# EAGLE schematic oresat-backplane (EAGLE 9.5.1)

## Sheet 1 of 20: Slot 1
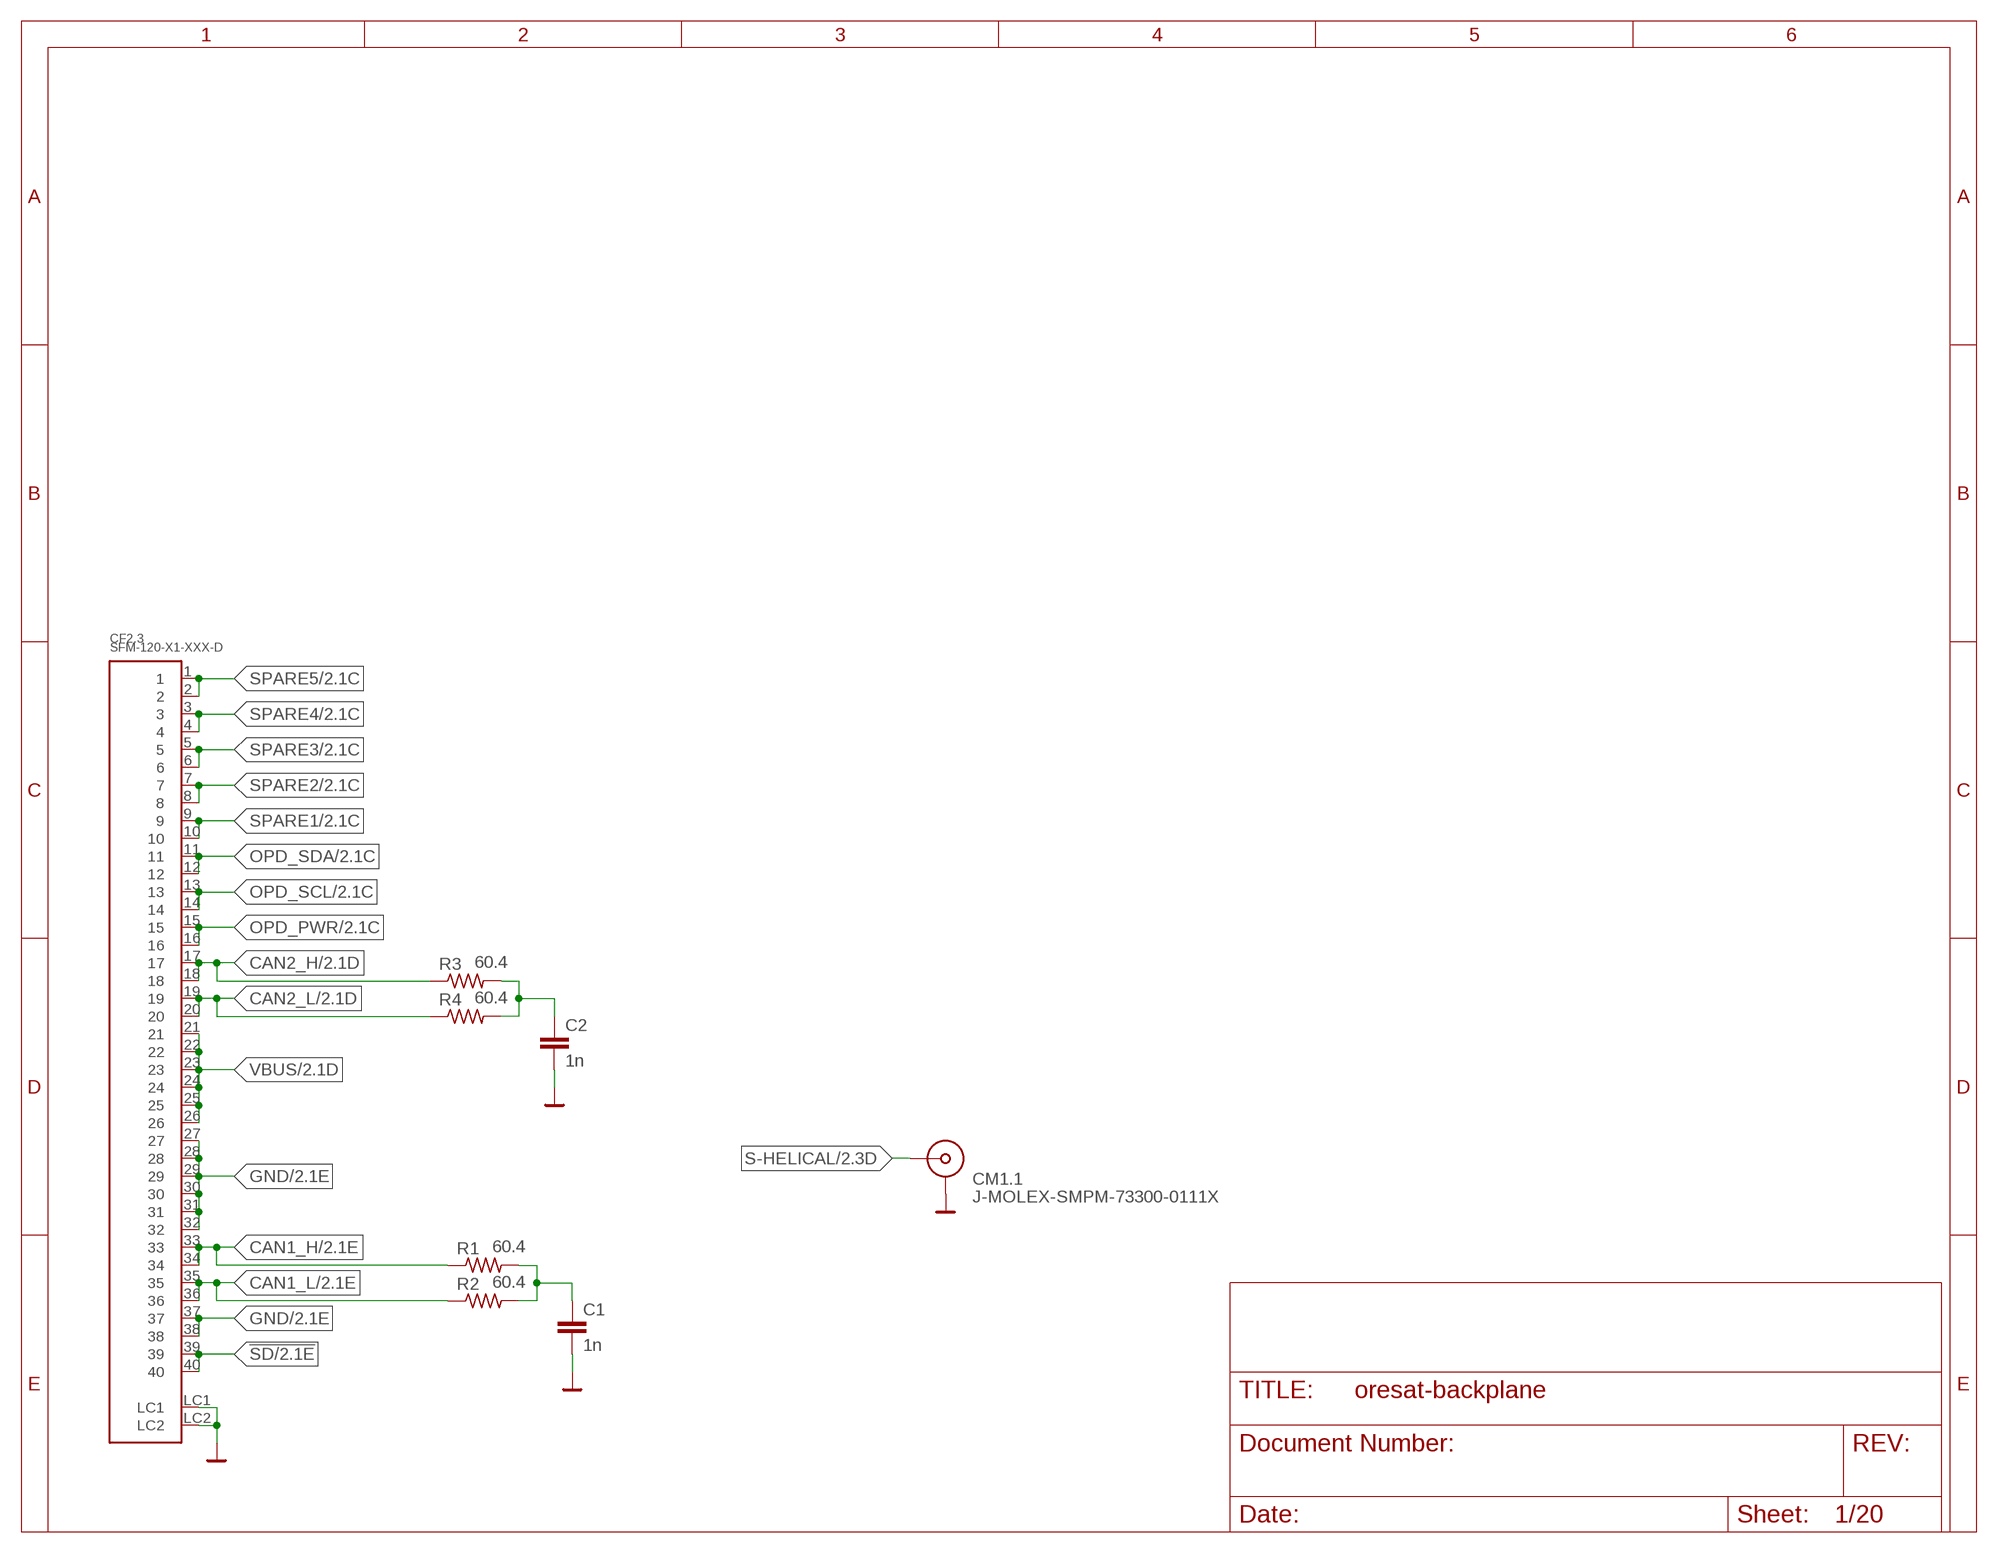
[diagram p0: schematic, sheet 1]

### Parts
C1  1n  C-EU0603-C-NOSILK  [.0603-C-NOSILK]
C2  1n  C-EU0603-C-NOSILK  [.0603-C-NOSILK]
CF2.3  SFM-120-X1-XXX-D  [SFM-120-X1-XXX-D]
CM1.1  J-MOLEX-SMPM-73300-0111X  [J-MOLEX-SMPM-73300-0111X]
R1  60.4  R-US_1206-C  [1206-C]
R2  60.4  R-US_1206-C  [1206-C]
R3  60.4  R-US_1206-C  [1206-C]
R4  60.4  R-US_1206-C  [1206-C]

### Nets
!SD: CF2.3.39 CF2.3.40 ; also sheet 2,3,4,5,6,7,8,12,13,14,15,16,17,18,19,20
CAN1_H: CF2.3.33 CF2.3.34 R1.1 ; also sheet 2,3,4,5,6,7,8,12,13,14,15,16,17,18,19,20
CAN1_L: CF2.3.35 CF2.3.36 R2.1 ; also sheet 2,3,4,5,6,7,8,12,13,14,15,16,17,18,19,20
CAN2_H: CF2.3.17 CF2.3.18 R3.1 ; also sheet 2,3,4,5,6,7,8,12,13,14,15,16,17,18,19,20
CAN2_L: CF2.3.19 CF2.3.20 R4.1 ; also sheet 2,3,4,5,6,7,8,12,13,14,15,16,17,18,19,20
GND: C1.2 C2.2 CF2.3.27 CF2.3.28 CF2.3.29 CF2.3.30 CF2.3.31 CF2.3.32 CF2.3.37 CF2.3.38 CF2.3.LC1 CF2.3.LC2 CM1.1.P$1(SHIELD1) CM1.1.P$2(SHIELD1) CM1.1.P$3(SHIELD1) CM1.1.P$4(SHIELD1) ; also sheet 2,3,4,5,6,7,8,12,13,14,15,16,17,18,19,20
N$1: C2.1 R3.2 R4.2
N$2: C1.1 R1.2 R2.2
OPD_PWR: CF2.3.15 CF2.3.16 ; also sheet 2,3,4,5,6,7,8,12,13,14,15,16,17,18,19,20
OPD_SCL: CF2.3.13 CF2.3.14 ; also sheet 2,3,4,5,6,7,8,12,13,14,15,16,17,18,19,20
OPD_SDA: CF2.3.11 CF2.3.12 ; also sheet 2,3,4,5,6,7,8,12,13,14,15,16,17,18,19,20
S-HELICAL [RF]: CM1.1.RF-DOWN(RF) ; also sheet 2
SPARE1: CF2.3.9 CF2.3.10 ; also sheet 2,3,4,5,6,7,8,12,13,14,15,16,17,18,19,20
SPARE2: CF2.3.7 CF2.3.8 ; also sheet 2,3,4,5,6,7,8,12,13,14,15,16,17,18,19,20
SPARE3: CF2.3.5 CF2.3.6 ; also sheet 2,3,4,5,6,7,8,12,13,14,15,16,17,18,19,20
SPARE4: CF2.3.3 CF2.3.4 ; also sheet 2,3,4,5,6,7,8,12,13,14,15,16,17,18,19,20
SPARE5: CF2.3.1 CF2.3.2 ; also sheet 2,3,4,5,6,7,8,12,13,14,15,16,17,18,19,20
VBUS: CF2.3.21 CF2.3.22 CF2.3.23 CF2.3.24 CF2.3.25 CF2.3.26 ; also sheet 2,3,4,5,6,7,8,12,13,14,15,16,17,18,19,20

## Sheet 2 of 20: Slot 2
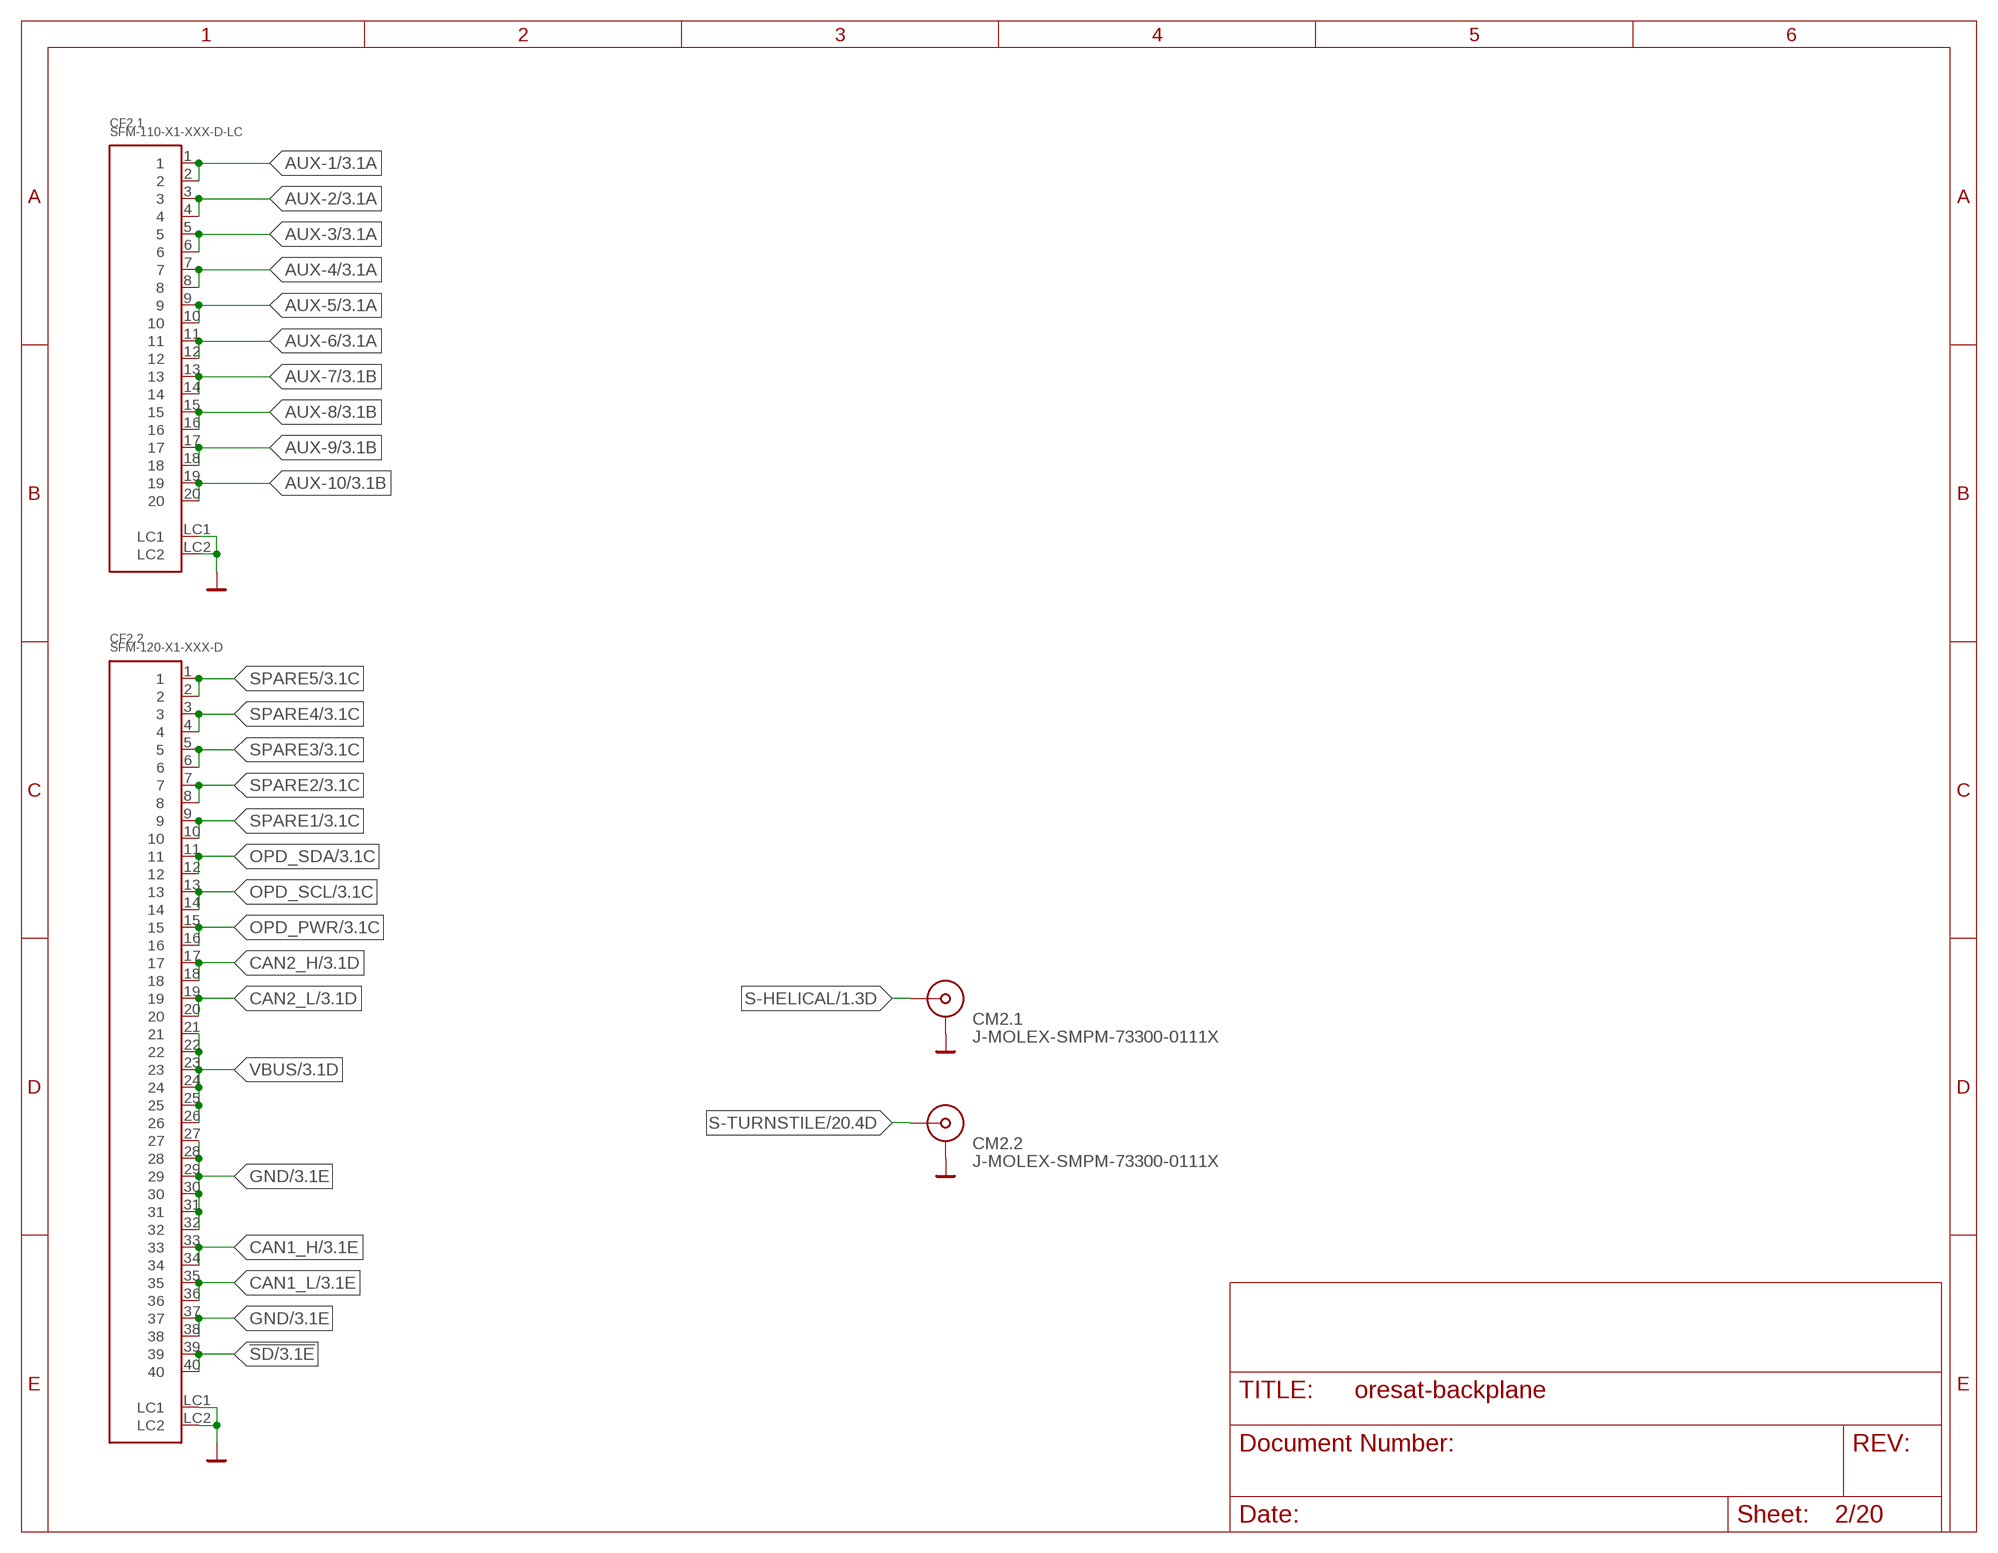
[diagram p1: schematic, sheet 2]

### Parts
CF2.1  SFM-110-X1-XXX-D-LC  [SFM-110-X1-XXX-D-LC]
CF2.2  SFM-120-X1-XXX-D  [SFM-120-X1-XXX-D]
CM2.1  J-MOLEX-SMPM-73300-0111X  [J-MOLEX-SMPM-73300-0111X]
CM2.2  J-MOLEX-SMPM-73300-0111X  [J-MOLEX-SMPM-73300-0111X]

### Nets
!SD: CF2.2.39 CF2.2.40 ; also sheet 1,3,4,5,6,7,8,12,13,14,15,16,17,18,19,20
AUX-1: CF2.1.1 CF2.1.2 ; also sheet 3,4,5,6,7,8,12,13,14,15,16,17,18,19
AUX-2: CF2.1.3 CF2.1.4 ; also sheet 3,4,5,6,7,8,12,13,14,15,16,17,18,19
AUX-3: CF2.1.5 CF2.1.6 ; also sheet 3,4,5,6,7,8,12,13,14,15,16,17,18,19
AUX-4: CF2.1.7 CF2.1.8 ; also sheet 3,4,5,6,7,8,12,13,14,15,16,17,18,19
AUX-5: CF2.1.9 CF2.1.10 ; also sheet 3,4,5,6,7,8,12,13,14,15,16,17,18,19
AUX-6: CF2.1.11 CF2.1.12 ; also sheet 3,4,5,6,7,8,12,13,14,15,16,17,18,19
AUX-7: CF2.1.13 CF2.1.14 ; also sheet 3,4,5,6,7,8,12,13,14,15,16,17,18,19
AUX-8: CF2.1.15 CF2.1.16 ; also sheet 3,4,5,6,7,8,12,13,14,15,16,17,18,19
AUX-9: CF2.1.17 CF2.1.18 ; also sheet 3,4,5,6,7,8,12,13,14,15,16,17,18,19
AUX-10: CF2.1.19 CF2.1.20 ; also sheet 3,4,5,6,7,8,12,13,14,15,16,17,18,19
CAN1_H: CF2.2.33 CF2.2.34 ; also sheet 1,3,4,5,6,7,8,12,13,14,15,16,17,18,19,20
CAN1_L: CF2.2.35 CF2.2.36 ; also sheet 1,3,4,5,6,7,8,12,13,14,15,16,17,18,19,20
CAN2_H: CF2.2.17 CF2.2.18 ; also sheet 1,3,4,5,6,7,8,12,13,14,15,16,17,18,19,20
CAN2_L: CF2.2.19 CF2.2.20 ; also sheet 1,3,4,5,6,7,8,12,13,14,15,16,17,18,19,20
GND: CF2.1.LC1 CF2.1.LC2 CF2.2.27 CF2.2.28 CF2.2.29 CF2.2.30 CF2.2.31 CF2.2.32 CF2.2.37 CF2.2.38 CF2.2.LC1 CF2.2.LC2 CM2.1.P$1(SHIELD1) CM2.1.P$2(SHIELD1) CM2.1.P$3(SHIELD1) CM2.1.P$4(SHIELD1) CM2.2.P$1(SHIELD1) CM2.2.P$2(SHIELD1) CM2.2.P$3(SHIELD1) CM2.2.P$4(SHIELD1) ; also sheet 1,3,4,5,6,7,8,12,13,14,15,16,17,18,19,20
OPD_PWR: CF2.2.15 CF2.2.16 ; also sheet 1,3,4,5,6,7,8,12,13,14,15,16,17,18,19,20
OPD_SCL: CF2.2.13 CF2.2.14 ; also sheet 1,3,4,5,6,7,8,12,13,14,15,16,17,18,19,20
OPD_SDA: CF2.2.11 CF2.2.12 ; also sheet 1,3,4,5,6,7,8,12,13,14,15,16,17,18,19,20
S-HELICAL [RF]: CM2.1.RF-DOWN(RF) ; also sheet 1
S-TURNSTILE [RF]: CM2.2.RF-DOWN(RF) ; also sheet 20
SPARE1: CF2.2.9 CF2.2.10 ; also sheet 1,3,4,5,6,7,8,12,13,14,15,16,17,18,19,20
SPARE2: CF2.2.7 CF2.2.8 ; also sheet 1,3,4,5,6,7,8,12,13,14,15,16,17,18,19,20
SPARE3: CF2.2.5 CF2.2.6 ; also sheet 1,3,4,5,6,7,8,12,13,14,15,16,17,18,19,20
SPARE4: CF2.2.3 CF2.2.4 ; also sheet 1,3,4,5,6,7,8,12,13,14,15,16,17,18,19,20
SPARE5: CF2.2.1 CF2.2.2 ; also sheet 1,3,4,5,6,7,8,12,13,14,15,16,17,18,19,20
VBUS: CF2.2.21 CF2.2.22 CF2.2.23 CF2.2.24 CF2.2.25 CF2.2.26 ; also sheet 1,3,4,5,6,7,8,12,13,14,15,16,17,18,19,20

## Sheet 3 of 20: Slot 3
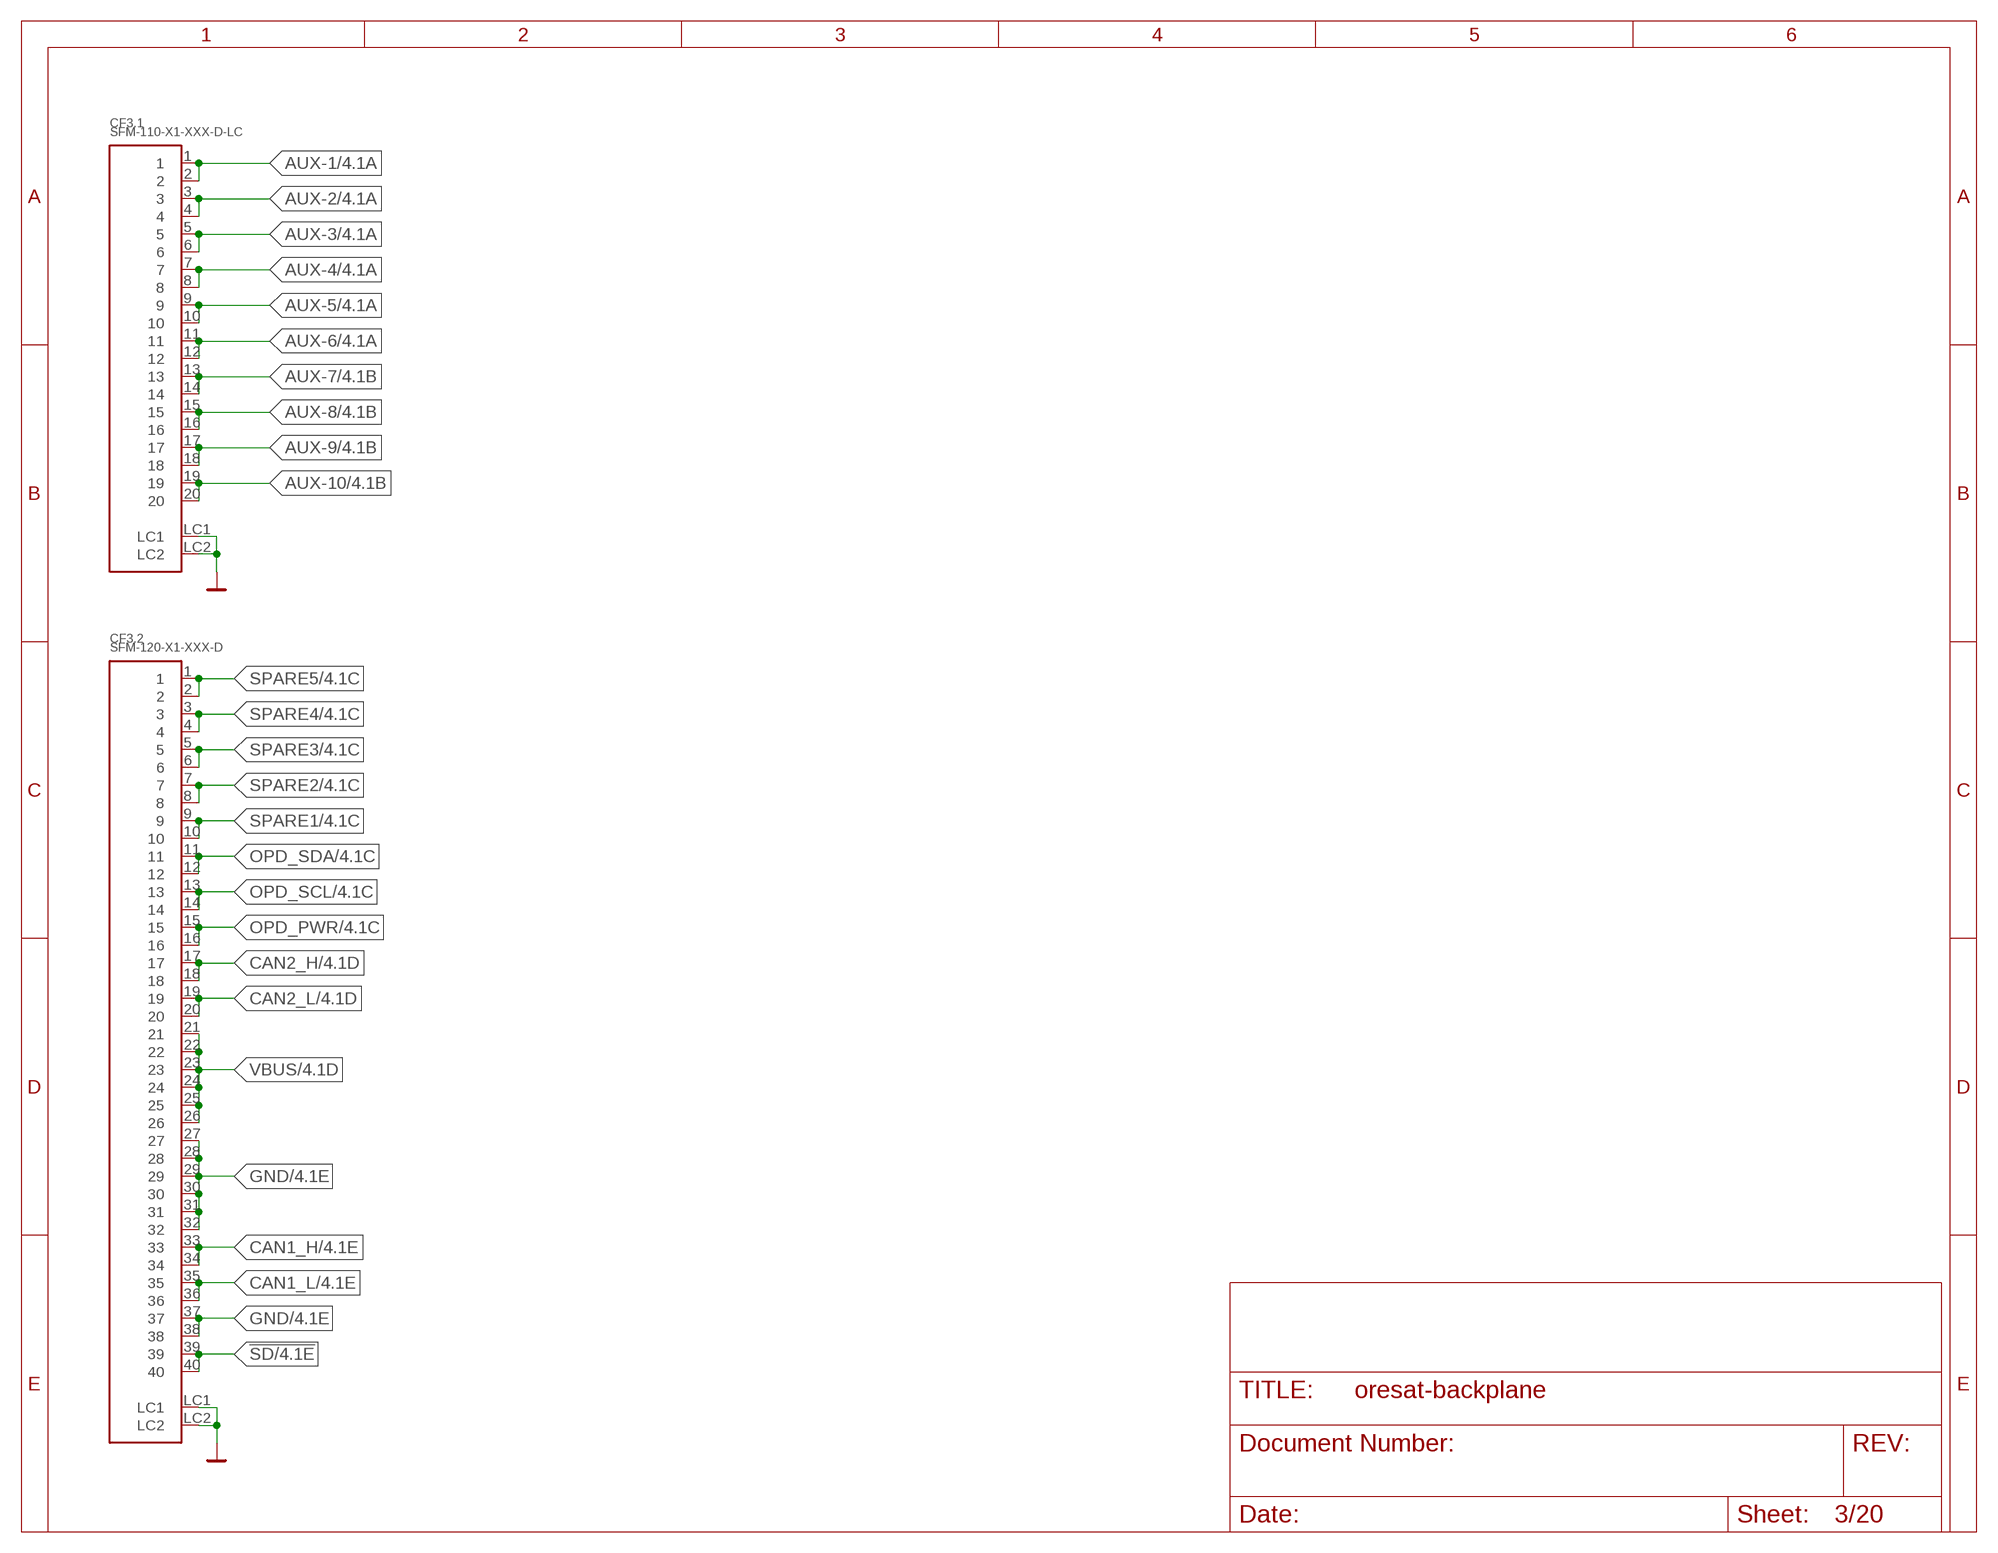
[diagram p2: schematic, sheet 3]

### Parts
CF3.1  SFM-110-X1-XXX-D-LC  [SFM-110-X1-XXX-D-LC]
CF3.2  SFM-120-X1-XXX-D  [SFM-120-X1-XXX-D]

### Nets
!SD: CF3.2.39 CF3.2.40 ; also sheet 1,2,4,5,6,7,8,12,13,14,15,16,17,18,19,20
AUX-1: CF3.1.1 CF3.1.2 ; also sheet 2,4,5,6,7,8,12,13,14,15,16,17,18,19
AUX-2: CF3.1.3 CF3.1.4 ; also sheet 2,4,5,6,7,8,12,13,14,15,16,17,18,19
AUX-3: CF3.1.5 CF3.1.6 ; also sheet 2,4,5,6,7,8,12,13,14,15,16,17,18,19
AUX-4: CF3.1.7 CF3.1.8 ; also sheet 2,4,5,6,7,8,12,13,14,15,16,17,18,19
AUX-5: CF3.1.9 CF3.1.10 ; also sheet 2,4,5,6,7,8,12,13,14,15,16,17,18,19
AUX-6: CF3.1.11 CF3.1.12 ; also sheet 2,4,5,6,7,8,12,13,14,15,16,17,18,19
AUX-7: CF3.1.13 CF3.1.14 ; also sheet 2,4,5,6,7,8,12,13,14,15,16,17,18,19
AUX-8: CF3.1.15 CF3.1.16 ; also sheet 2,4,5,6,7,8,12,13,14,15,16,17,18,19
AUX-9: CF3.1.17 CF3.1.18 ; also sheet 2,4,5,6,7,8,12,13,14,15,16,17,18,19
AUX-10: CF3.1.19 CF3.1.20 ; also sheet 2,4,5,6,7,8,12,13,14,15,16,17,18,19
CAN1_H: CF3.2.33 CF3.2.34 ; also sheet 1,2,4,5,6,7,8,12,13,14,15,16,17,18,19,20
CAN1_L: CF3.2.35 CF3.2.36 ; also sheet 1,2,4,5,6,7,8,12,13,14,15,16,17,18,19,20
CAN2_H: CF3.2.17 CF3.2.18 ; also sheet 1,2,4,5,6,7,8,12,13,14,15,16,17,18,19,20
CAN2_L: CF3.2.19 CF3.2.20 ; also sheet 1,2,4,5,6,7,8,12,13,14,15,16,17,18,19,20
GND: CF3.1.LC1 CF3.1.LC2 CF3.2.27 CF3.2.28 CF3.2.29 CF3.2.30 CF3.2.31 CF3.2.32 CF3.2.37 CF3.2.38 CF3.2.LC1 CF3.2.LC2 ; also sheet 1,2,4,5,6,7,8,12,13,14,15,16,17,18,19,20
OPD_PWR: CF3.2.15 CF3.2.16 ; also sheet 1,2,4,5,6,7,8,12,13,14,15,16,17,18,19,20
OPD_SCL: CF3.2.13 CF3.2.14 ; also sheet 1,2,4,5,6,7,8,12,13,14,15,16,17,18,19,20
OPD_SDA: CF3.2.11 CF3.2.12 ; also sheet 1,2,4,5,6,7,8,12,13,14,15,16,17,18,19,20
SPARE1: CF3.2.9 CF3.2.10 ; also sheet 1,2,4,5,6,7,8,12,13,14,15,16,17,18,19,20
SPARE2: CF3.2.7 CF3.2.8 ; also sheet 1,2,4,5,6,7,8,12,13,14,15,16,17,18,19,20
SPARE3: CF3.2.5 CF3.2.6 ; also sheet 1,2,4,5,6,7,8,12,13,14,15,16,17,18,19,20
SPARE4: CF3.2.3 CF3.2.4 ; also sheet 1,2,4,5,6,7,8,12,13,14,15,16,17,18,19,20
SPARE5: CF3.2.1 CF3.2.2 ; also sheet 1,2,4,5,6,7,8,12,13,14,15,16,17,18,19,20
VBUS: CF3.2.21 CF3.2.22 CF3.2.23 CF3.2.24 CF3.2.25 CF3.2.26 ; also sheet 1,2,4,5,6,7,8,12,13,14,15,16,17,18,19,20

## Sheet 4 of 20: Slot 4
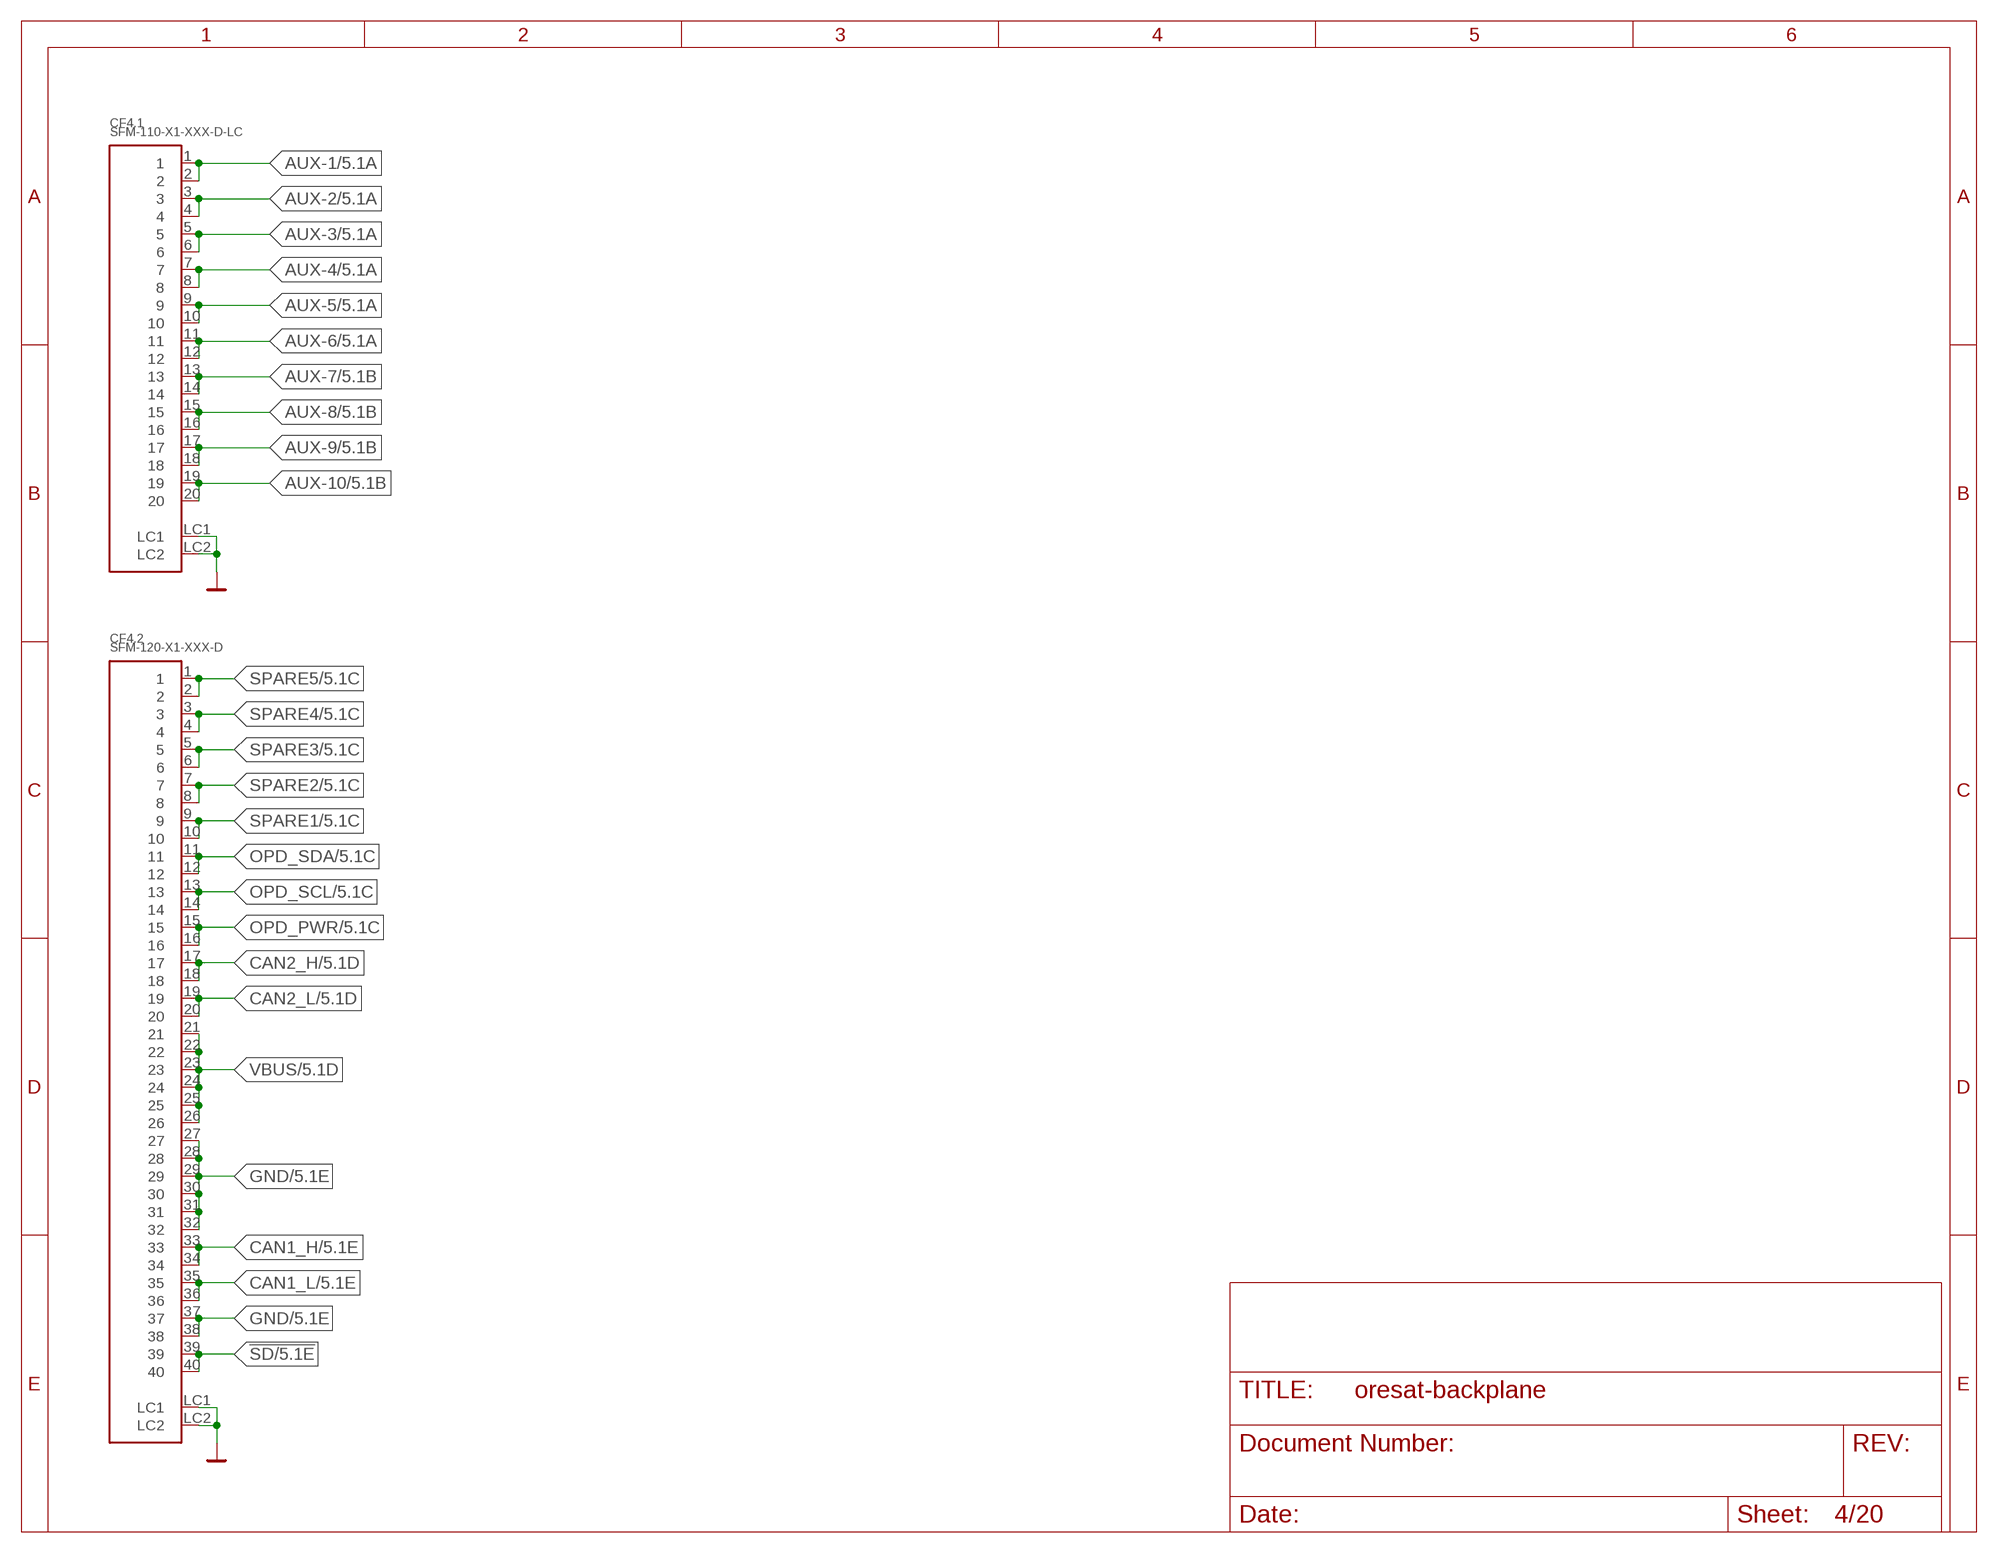
[diagram p3: schematic, sheet 4]

### Parts
CF4.1  SFM-110-X1-XXX-D-LC  [SFM-110-X1-XXX-D-LC]
CF4.2  SFM-120-X1-XXX-D  [SFM-120-X1-XXX-D]

### Nets
!SD: CF4.2.39 CF4.2.40 ; also sheet 1,2,3,5,6,7,8,12,13,14,15,16,17,18,19,20
AUX-1: CF4.1.1 CF4.1.2 ; also sheet 2,3,5,6,7,8,12,13,14,15,16,17,18,19
AUX-2: CF4.1.3 CF4.1.4 ; also sheet 2,3,5,6,7,8,12,13,14,15,16,17,18,19
AUX-3: CF4.1.5 CF4.1.6 ; also sheet 2,3,5,6,7,8,12,13,14,15,16,17,18,19
AUX-4: CF4.1.7 CF4.1.8 ; also sheet 2,3,5,6,7,8,12,13,14,15,16,17,18,19
AUX-5: CF4.1.9 CF4.1.10 ; also sheet 2,3,5,6,7,8,12,13,14,15,16,17,18,19
AUX-6: CF4.1.11 CF4.1.12 ; also sheet 2,3,5,6,7,8,12,13,14,15,16,17,18,19
AUX-7: CF4.1.13 CF4.1.14 ; also sheet 2,3,5,6,7,8,12,13,14,15,16,17,18,19
AUX-8: CF4.1.15 CF4.1.16 ; also sheet 2,3,5,6,7,8,12,13,14,15,16,17,18,19
AUX-9: CF4.1.17 CF4.1.18 ; also sheet 2,3,5,6,7,8,12,13,14,15,16,17,18,19
AUX-10: CF4.1.19 CF4.1.20 ; also sheet 2,3,5,6,7,8,12,13,14,15,16,17,18,19
CAN1_H: CF4.2.33 CF4.2.34 ; also sheet 1,2,3,5,6,7,8,12,13,14,15,16,17,18,19,20
CAN1_L: CF4.2.35 CF4.2.36 ; also sheet 1,2,3,5,6,7,8,12,13,14,15,16,17,18,19,20
CAN2_H: CF4.2.17 CF4.2.18 ; also sheet 1,2,3,5,6,7,8,12,13,14,15,16,17,18,19,20
CAN2_L: CF4.2.19 CF4.2.20 ; also sheet 1,2,3,5,6,7,8,12,13,14,15,16,17,18,19,20
GND: CF4.1.LC1 CF4.1.LC2 CF4.2.27 CF4.2.28 CF4.2.29 CF4.2.30 CF4.2.31 CF4.2.32 CF4.2.37 CF4.2.38 CF4.2.LC1 CF4.2.LC2 ; also sheet 1,2,3,5,6,7,8,12,13,14,15,16,17,18,19,20
OPD_PWR: CF4.2.15 CF4.2.16 ; also sheet 1,2,3,5,6,7,8,12,13,14,15,16,17,18,19,20
OPD_SCL: CF4.2.13 CF4.2.14 ; also sheet 1,2,3,5,6,7,8,12,13,14,15,16,17,18,19,20
OPD_SDA: CF4.2.11 CF4.2.12 ; also sheet 1,2,3,5,6,7,8,12,13,14,15,16,17,18,19,20
SPARE1: CF4.2.9 CF4.2.10 ; also sheet 1,2,3,5,6,7,8,12,13,14,15,16,17,18,19,20
SPARE2: CF4.2.7 CF4.2.8 ; also sheet 1,2,3,5,6,7,8,12,13,14,15,16,17,18,19,20
SPARE3: CF4.2.5 CF4.2.6 ; also sheet 1,2,3,5,6,7,8,12,13,14,15,16,17,18,19,20
SPARE4: CF4.2.3 CF4.2.4 ; also sheet 1,2,3,5,6,7,8,12,13,14,15,16,17,18,19,20
SPARE5: CF4.2.1 CF4.2.2 ; also sheet 1,2,3,5,6,7,8,12,13,14,15,16,17,18,19,20
VBUS: CF4.2.21 CF4.2.22 CF4.2.23 CF4.2.24 CF4.2.25 CF4.2.26 ; also sheet 1,2,3,5,6,7,8,12,13,14,15,16,17,18,19,20

## Sheet 5 of 20: Slot 5
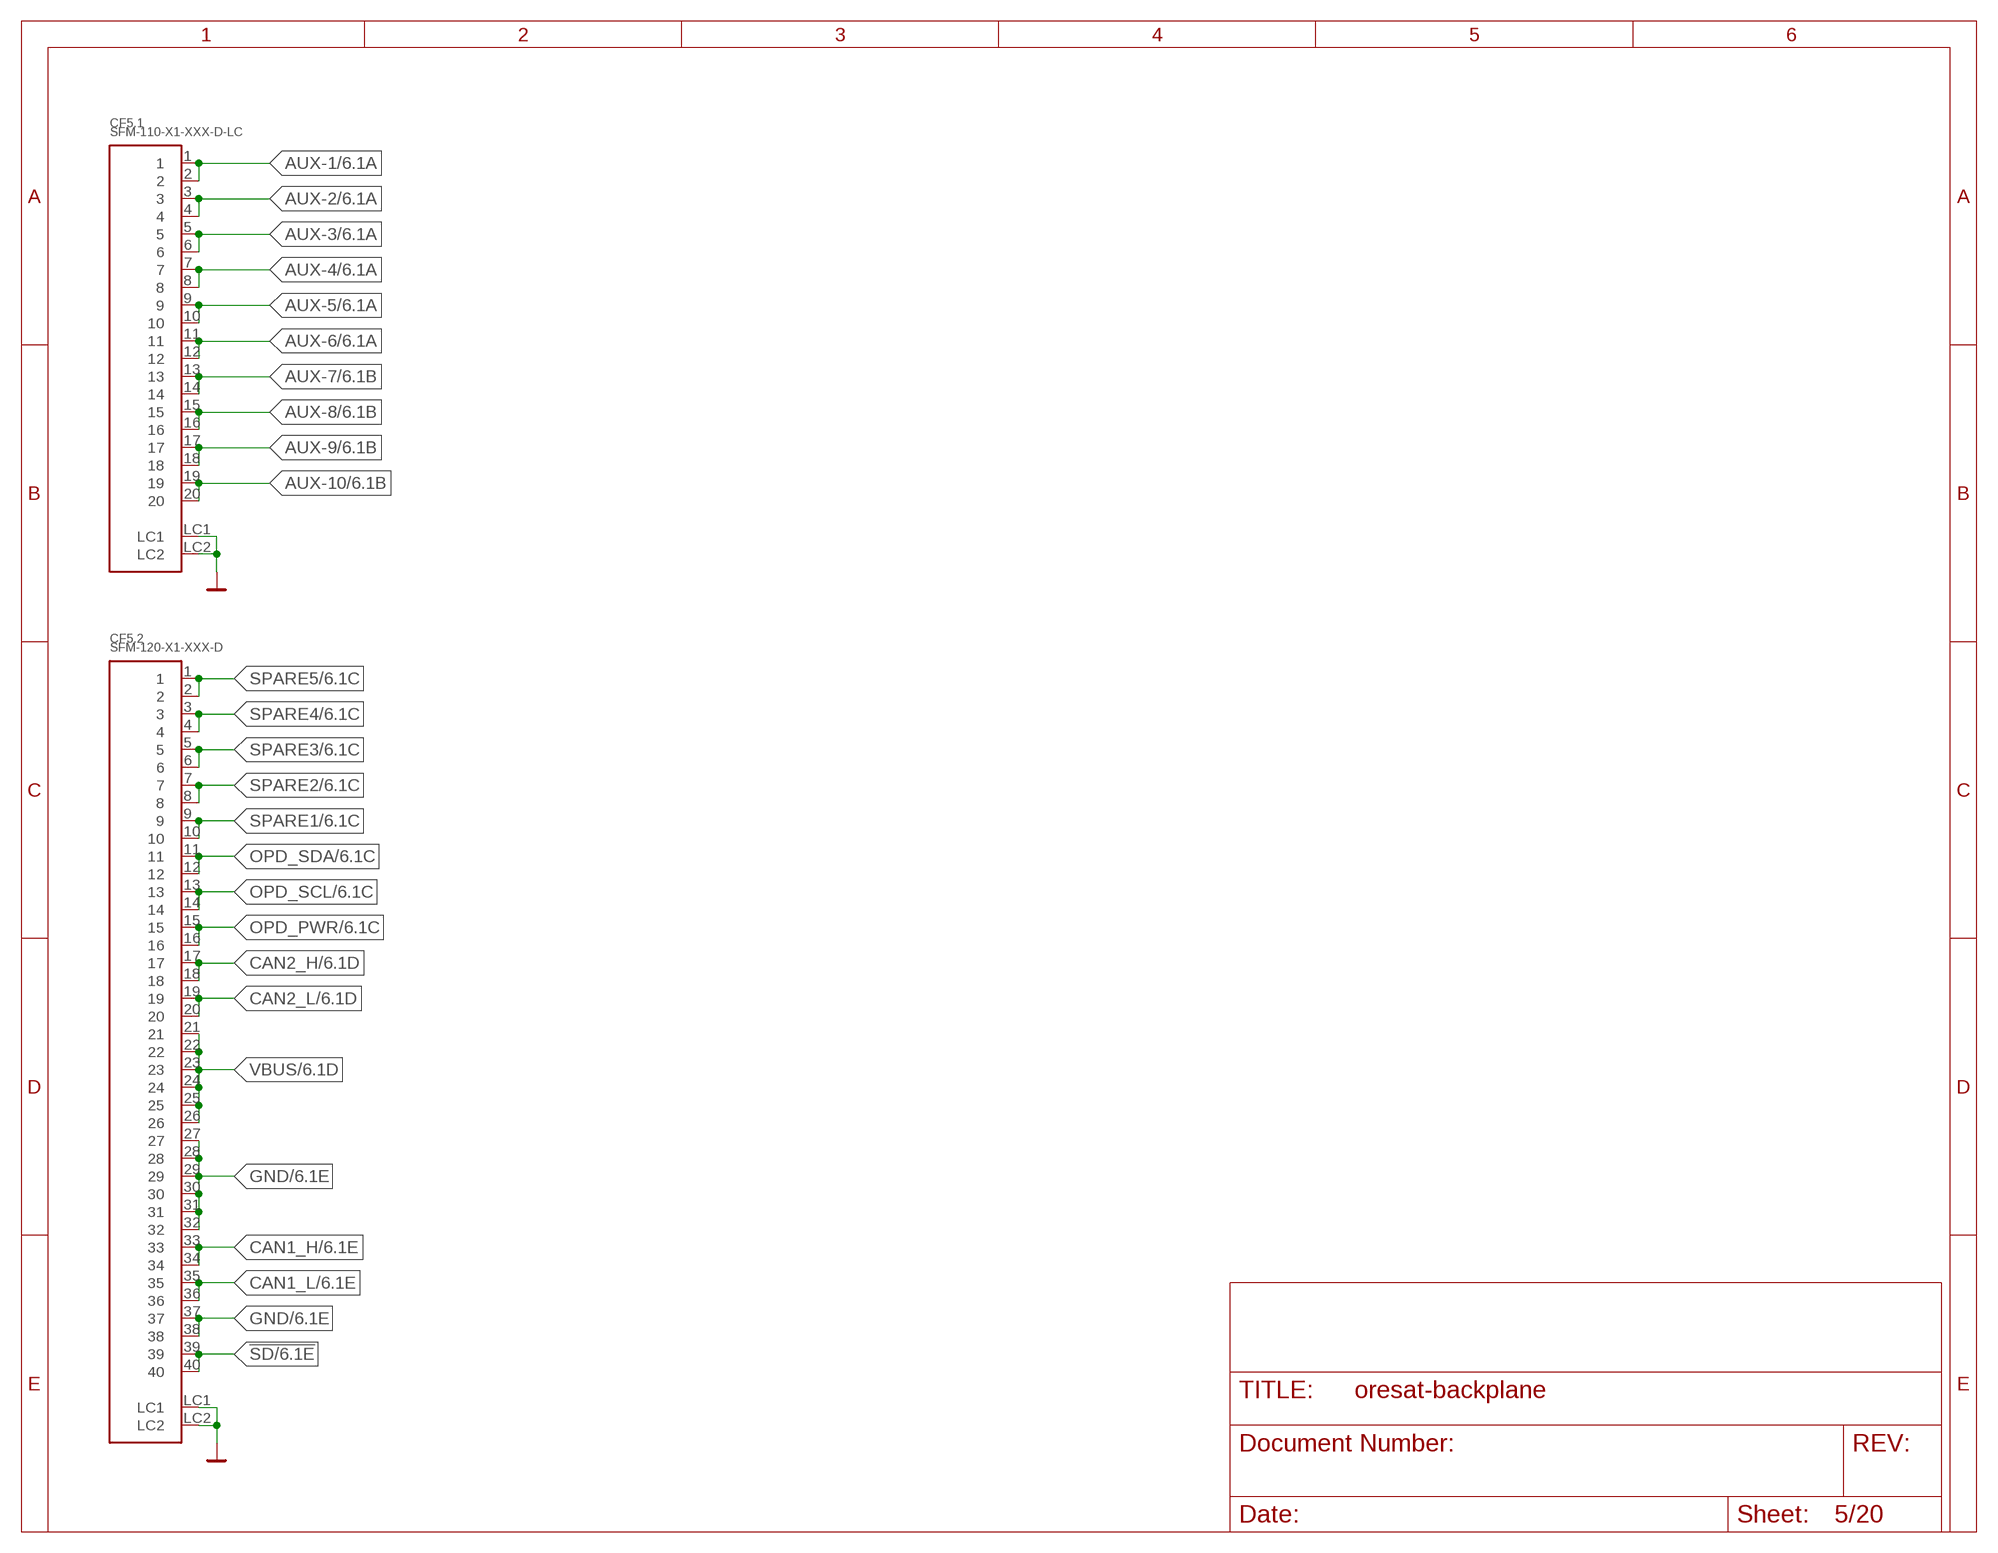
[diagram p4: schematic, sheet 5]

### Parts
CF5.1  SFM-110-X1-XXX-D-LC  [SFM-110-X1-XXX-D-LC]
CF5.2  SFM-120-X1-XXX-D  [SFM-120-X1-XXX-D]

### Nets
!SD: CF5.2.39 CF5.2.40 ; also sheet 1,2,3,4,6,7,8,12,13,14,15,16,17,18,19,20
AUX-1: CF5.1.1 CF5.1.2 ; also sheet 2,3,4,6,7,8,12,13,14,15,16,17,18,19
AUX-2: CF5.1.3 CF5.1.4 ; also sheet 2,3,4,6,7,8,12,13,14,15,16,17,18,19
AUX-3: CF5.1.5 CF5.1.6 ; also sheet 2,3,4,6,7,8,12,13,14,15,16,17,18,19
AUX-4: CF5.1.7 CF5.1.8 ; also sheet 2,3,4,6,7,8,12,13,14,15,16,17,18,19
AUX-5: CF5.1.9 CF5.1.10 ; also sheet 2,3,4,6,7,8,12,13,14,15,16,17,18,19
AUX-6: CF5.1.11 CF5.1.12 ; also sheet 2,3,4,6,7,8,12,13,14,15,16,17,18,19
AUX-7: CF5.1.13 CF5.1.14 ; also sheet 2,3,4,6,7,8,12,13,14,15,16,17,18,19
AUX-8: CF5.1.15 CF5.1.16 ; also sheet 2,3,4,6,7,8,12,13,14,15,16,17,18,19
AUX-9: CF5.1.17 CF5.1.18 ; also sheet 2,3,4,6,7,8,12,13,14,15,16,17,18,19
AUX-10: CF5.1.19 CF5.1.20 ; also sheet 2,3,4,6,7,8,12,13,14,15,16,17,18,19
CAN1_H: CF5.2.33 CF5.2.34 ; also sheet 1,2,3,4,6,7,8,12,13,14,15,16,17,18,19,20
CAN1_L: CF5.2.35 CF5.2.36 ; also sheet 1,2,3,4,6,7,8,12,13,14,15,16,17,18,19,20
CAN2_H: CF5.2.17 CF5.2.18 ; also sheet 1,2,3,4,6,7,8,12,13,14,15,16,17,18,19,20
CAN2_L: CF5.2.19 CF5.2.20 ; also sheet 1,2,3,4,6,7,8,12,13,14,15,16,17,18,19,20
GND: CF5.1.LC1 CF5.1.LC2 CF5.2.27 CF5.2.28 CF5.2.29 CF5.2.30 CF5.2.31 CF5.2.32 CF5.2.37 CF5.2.38 CF5.2.LC1 CF5.2.LC2 ; also sheet 1,2,3,4,6,7,8,12,13,14,15,16,17,18,19,20
OPD_PWR: CF5.2.15 CF5.2.16 ; also sheet 1,2,3,4,6,7,8,12,13,14,15,16,17,18,19,20
OPD_SCL: CF5.2.13 CF5.2.14 ; also sheet 1,2,3,4,6,7,8,12,13,14,15,16,17,18,19,20
OPD_SDA: CF5.2.11 CF5.2.12 ; also sheet 1,2,3,4,6,7,8,12,13,14,15,16,17,18,19,20
SPARE1: CF5.2.9 CF5.2.10 ; also sheet 1,2,3,4,6,7,8,12,13,14,15,16,17,18,19,20
SPARE2: CF5.2.7 CF5.2.8 ; also sheet 1,2,3,4,6,7,8,12,13,14,15,16,17,18,19,20
SPARE3: CF5.2.5 CF5.2.6 ; also sheet 1,2,3,4,6,7,8,12,13,14,15,16,17,18,19,20
SPARE4: CF5.2.3 CF5.2.4 ; also sheet 1,2,3,4,6,7,8,12,13,14,15,16,17,18,19,20
SPARE5: CF5.2.1 CF5.2.2 ; also sheet 1,2,3,4,6,7,8,12,13,14,15,16,17,18,19,20
VBUS: CF5.2.21 CF5.2.22 CF5.2.23 CF5.2.24 CF5.2.25 CF5.2.26 ; also sheet 1,2,3,4,6,7,8,12,13,14,15,16,17,18,19,20

## Sheet 6 of 20: Slot 6
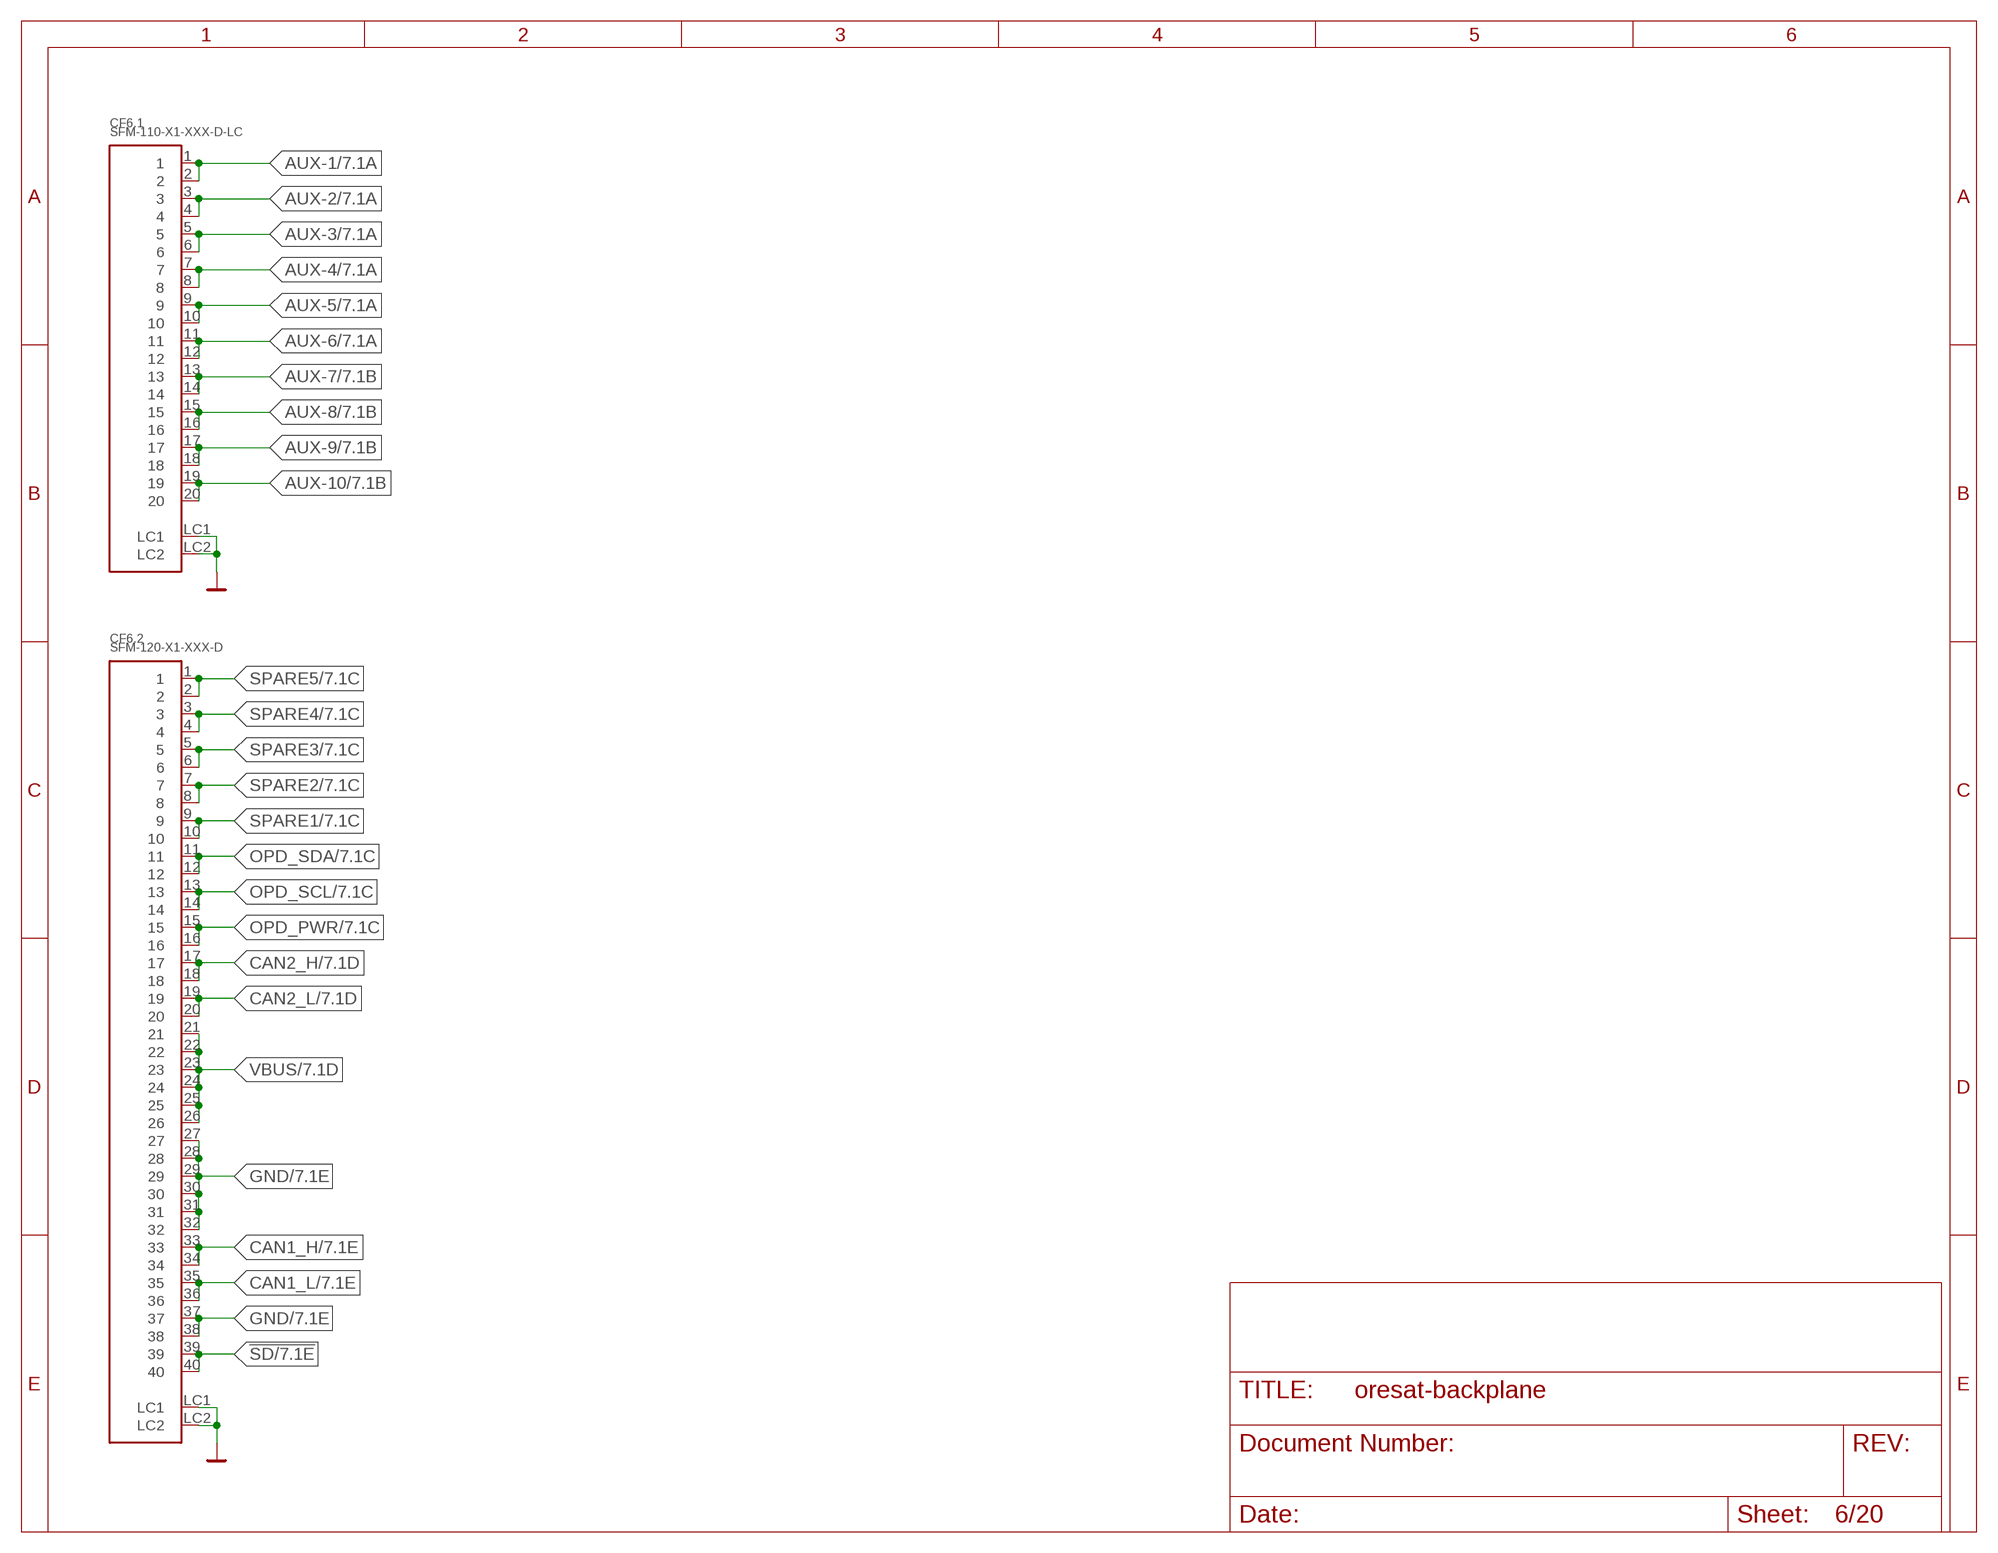
[diagram p5: schematic, sheet 6]

### Parts
CF6.1  SFM-110-X1-XXX-D-LC  [SFM-110-X1-XXX-D-LC]
CF6.2  SFM-120-X1-XXX-D  [SFM-120-X1-XXX-D]

### Nets
!SD: CF6.2.39 CF6.2.40 ; also sheet 1,2,3,4,5,7,8,12,13,14,15,16,17,18,19,20
AUX-1: CF6.1.1 CF6.1.2 ; also sheet 2,3,4,5,7,8,12,13,14,15,16,17,18,19
AUX-2: CF6.1.3 CF6.1.4 ; also sheet 2,3,4,5,7,8,12,13,14,15,16,17,18,19
AUX-3: CF6.1.5 CF6.1.6 ; also sheet 2,3,4,5,7,8,12,13,14,15,16,17,18,19
AUX-4: CF6.1.7 CF6.1.8 ; also sheet 2,3,4,5,7,8,12,13,14,15,16,17,18,19
AUX-5: CF6.1.9 CF6.1.10 ; also sheet 2,3,4,5,7,8,12,13,14,15,16,17,18,19
AUX-6: CF6.1.11 CF6.1.12 ; also sheet 2,3,4,5,7,8,12,13,14,15,16,17,18,19
AUX-7: CF6.1.13 CF6.1.14 ; also sheet 2,3,4,5,7,8,12,13,14,15,16,17,18,19
AUX-8: CF6.1.15 CF6.1.16 ; also sheet 2,3,4,5,7,8,12,13,14,15,16,17,18,19
AUX-9: CF6.1.17 CF6.1.18 ; also sheet 2,3,4,5,7,8,12,13,14,15,16,17,18,19
AUX-10: CF6.1.19 CF6.1.20 ; also sheet 2,3,4,5,7,8,12,13,14,15,16,17,18,19
CAN1_H: CF6.2.33 CF6.2.34 ; also sheet 1,2,3,4,5,7,8,12,13,14,15,16,17,18,19,20
CAN1_L: CF6.2.35 CF6.2.36 ; also sheet 1,2,3,4,5,7,8,12,13,14,15,16,17,18,19,20
CAN2_H: CF6.2.17 CF6.2.18 ; also sheet 1,2,3,4,5,7,8,12,13,14,15,16,17,18,19,20
CAN2_L: CF6.2.19 CF6.2.20 ; also sheet 1,2,3,4,5,7,8,12,13,14,15,16,17,18,19,20
GND: CF6.1.LC1 CF6.1.LC2 CF6.2.27 CF6.2.28 CF6.2.29 CF6.2.30 CF6.2.31 CF6.2.32 CF6.2.37 CF6.2.38 CF6.2.LC1 CF6.2.LC2 ; also sheet 1,2,3,4,5,7,8,12,13,14,15,16,17,18,19,20
OPD_PWR: CF6.2.15 CF6.2.16 ; also sheet 1,2,3,4,5,7,8,12,13,14,15,16,17,18,19,20
OPD_SCL: CF6.2.13 CF6.2.14 ; also sheet 1,2,3,4,5,7,8,12,13,14,15,16,17,18,19,20
OPD_SDA: CF6.2.11 CF6.2.12 ; also sheet 1,2,3,4,5,7,8,12,13,14,15,16,17,18,19,20
SPARE1: CF6.2.9 CF6.2.10 ; also sheet 1,2,3,4,5,7,8,12,13,14,15,16,17,18,19,20
SPARE2: CF6.2.7 CF6.2.8 ; also sheet 1,2,3,4,5,7,8,12,13,14,15,16,17,18,19,20
SPARE3: CF6.2.5 CF6.2.6 ; also sheet 1,2,3,4,5,7,8,12,13,14,15,16,17,18,19,20
SPARE4: CF6.2.3 CF6.2.4 ; also sheet 1,2,3,4,5,7,8,12,13,14,15,16,17,18,19,20
SPARE5: CF6.2.1 CF6.2.2 ; also sheet 1,2,3,4,5,7,8,12,13,14,15,16,17,18,19,20
VBUS: CF6.2.21 CF6.2.22 CF6.2.23 CF6.2.24 CF6.2.25 CF6.2.26 ; also sheet 1,2,3,4,5,7,8,12,13,14,15,16,17,18,19,20

## Sheet 7 of 20: Slot 7
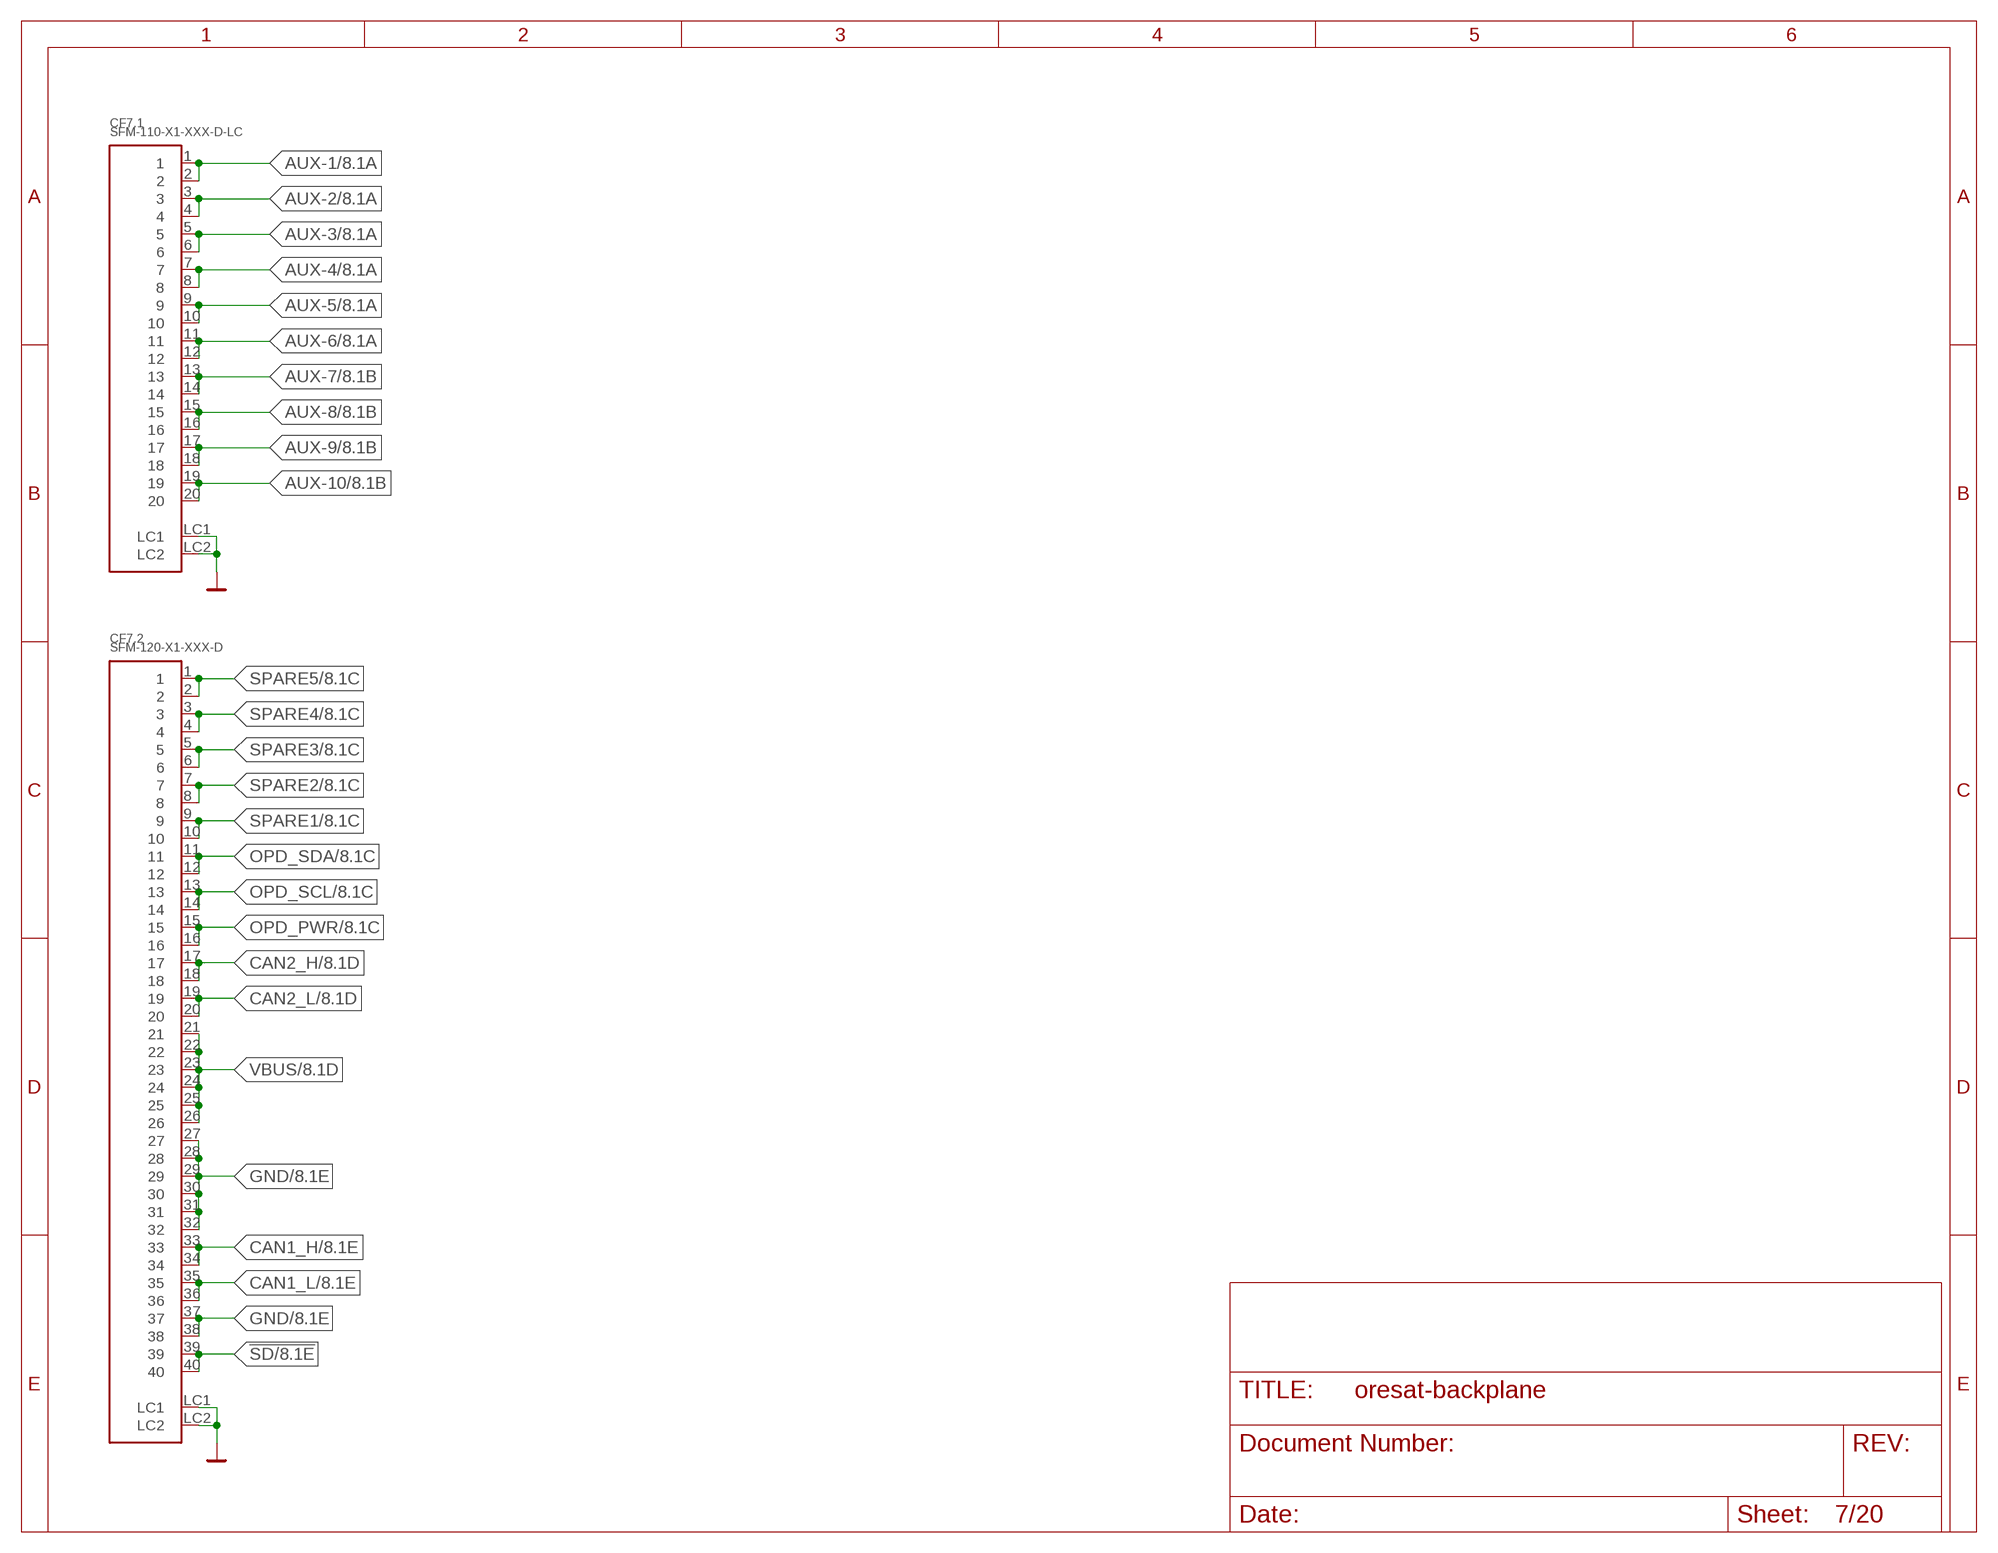
[diagram p6: schematic, sheet 7]

### Parts
CF7.1  SFM-110-X1-XXX-D-LC  [SFM-110-X1-XXX-D-LC]
CF7.2  SFM-120-X1-XXX-D  [SFM-120-X1-XXX-D]

### Nets
!SD: CF7.2.39 CF7.2.40 ; also sheet 1,2,3,4,5,6,8,12,13,14,15,16,17,18,19,20
AUX-1: CF7.1.1 CF7.1.2 ; also sheet 2,3,4,5,6,8,12,13,14,15,16,17,18,19
AUX-2: CF7.1.3 CF7.1.4 ; also sheet 2,3,4,5,6,8,12,13,14,15,16,17,18,19
AUX-3: CF7.1.5 CF7.1.6 ; also sheet 2,3,4,5,6,8,12,13,14,15,16,17,18,19
AUX-4: CF7.1.7 CF7.1.8 ; also sheet 2,3,4,5,6,8,12,13,14,15,16,17,18,19
AUX-5: CF7.1.9 CF7.1.10 ; also sheet 2,3,4,5,6,8,12,13,14,15,16,17,18,19
AUX-6: CF7.1.11 CF7.1.12 ; also sheet 2,3,4,5,6,8,12,13,14,15,16,17,18,19
AUX-7: CF7.1.13 CF7.1.14 ; also sheet 2,3,4,5,6,8,12,13,14,15,16,17,18,19
AUX-8: CF7.1.15 CF7.1.16 ; also sheet 2,3,4,5,6,8,12,13,14,15,16,17,18,19
AUX-9: CF7.1.17 CF7.1.18 ; also sheet 2,3,4,5,6,8,12,13,14,15,16,17,18,19
AUX-10: CF7.1.19 CF7.1.20 ; also sheet 2,3,4,5,6,8,12,13,14,15,16,17,18,19
CAN1_H: CF7.2.33 CF7.2.34 ; also sheet 1,2,3,4,5,6,8,12,13,14,15,16,17,18,19,20
CAN1_L: CF7.2.35 CF7.2.36 ; also sheet 1,2,3,4,5,6,8,12,13,14,15,16,17,18,19,20
CAN2_H: CF7.2.17 CF7.2.18 ; also sheet 1,2,3,4,5,6,8,12,13,14,15,16,17,18,19,20
CAN2_L: CF7.2.19 CF7.2.20 ; also sheet 1,2,3,4,5,6,8,12,13,14,15,16,17,18,19,20
GND: CF7.1.LC1 CF7.1.LC2 CF7.2.27 CF7.2.28 CF7.2.29 CF7.2.30 CF7.2.31 CF7.2.32 CF7.2.37 CF7.2.38 CF7.2.LC1 CF7.2.LC2 ; also sheet 1,2,3,4,5,6,8,12,13,14,15,16,17,18,19,20
OPD_PWR: CF7.2.15 CF7.2.16 ; also sheet 1,2,3,4,5,6,8,12,13,14,15,16,17,18,19,20
OPD_SCL: CF7.2.13 CF7.2.14 ; also sheet 1,2,3,4,5,6,8,12,13,14,15,16,17,18,19,20
OPD_SDA: CF7.2.11 CF7.2.12 ; also sheet 1,2,3,4,5,6,8,12,13,14,15,16,17,18,19,20
SPARE1: CF7.2.9 CF7.2.10 ; also sheet 1,2,3,4,5,6,8,12,13,14,15,16,17,18,19,20
SPARE2: CF7.2.7 CF7.2.8 ; also sheet 1,2,3,4,5,6,8,12,13,14,15,16,17,18,19,20
SPARE3: CF7.2.5 CF7.2.6 ; also sheet 1,2,3,4,5,6,8,12,13,14,15,16,17,18,19,20
SPARE4: CF7.2.3 CF7.2.4 ; also sheet 1,2,3,4,5,6,8,12,13,14,15,16,17,18,19,20
SPARE5: CF7.2.1 CF7.2.2 ; also sheet 1,2,3,4,5,6,8,12,13,14,15,16,17,18,19,20
VBUS: CF7.2.21 CF7.2.22 CF7.2.23 CF7.2.24 CF7.2.25 CF7.2.26 ; also sheet 1,2,3,4,5,6,8,12,13,14,15,16,17,18,19,20

## Sheet 8 of 20: Slot 8
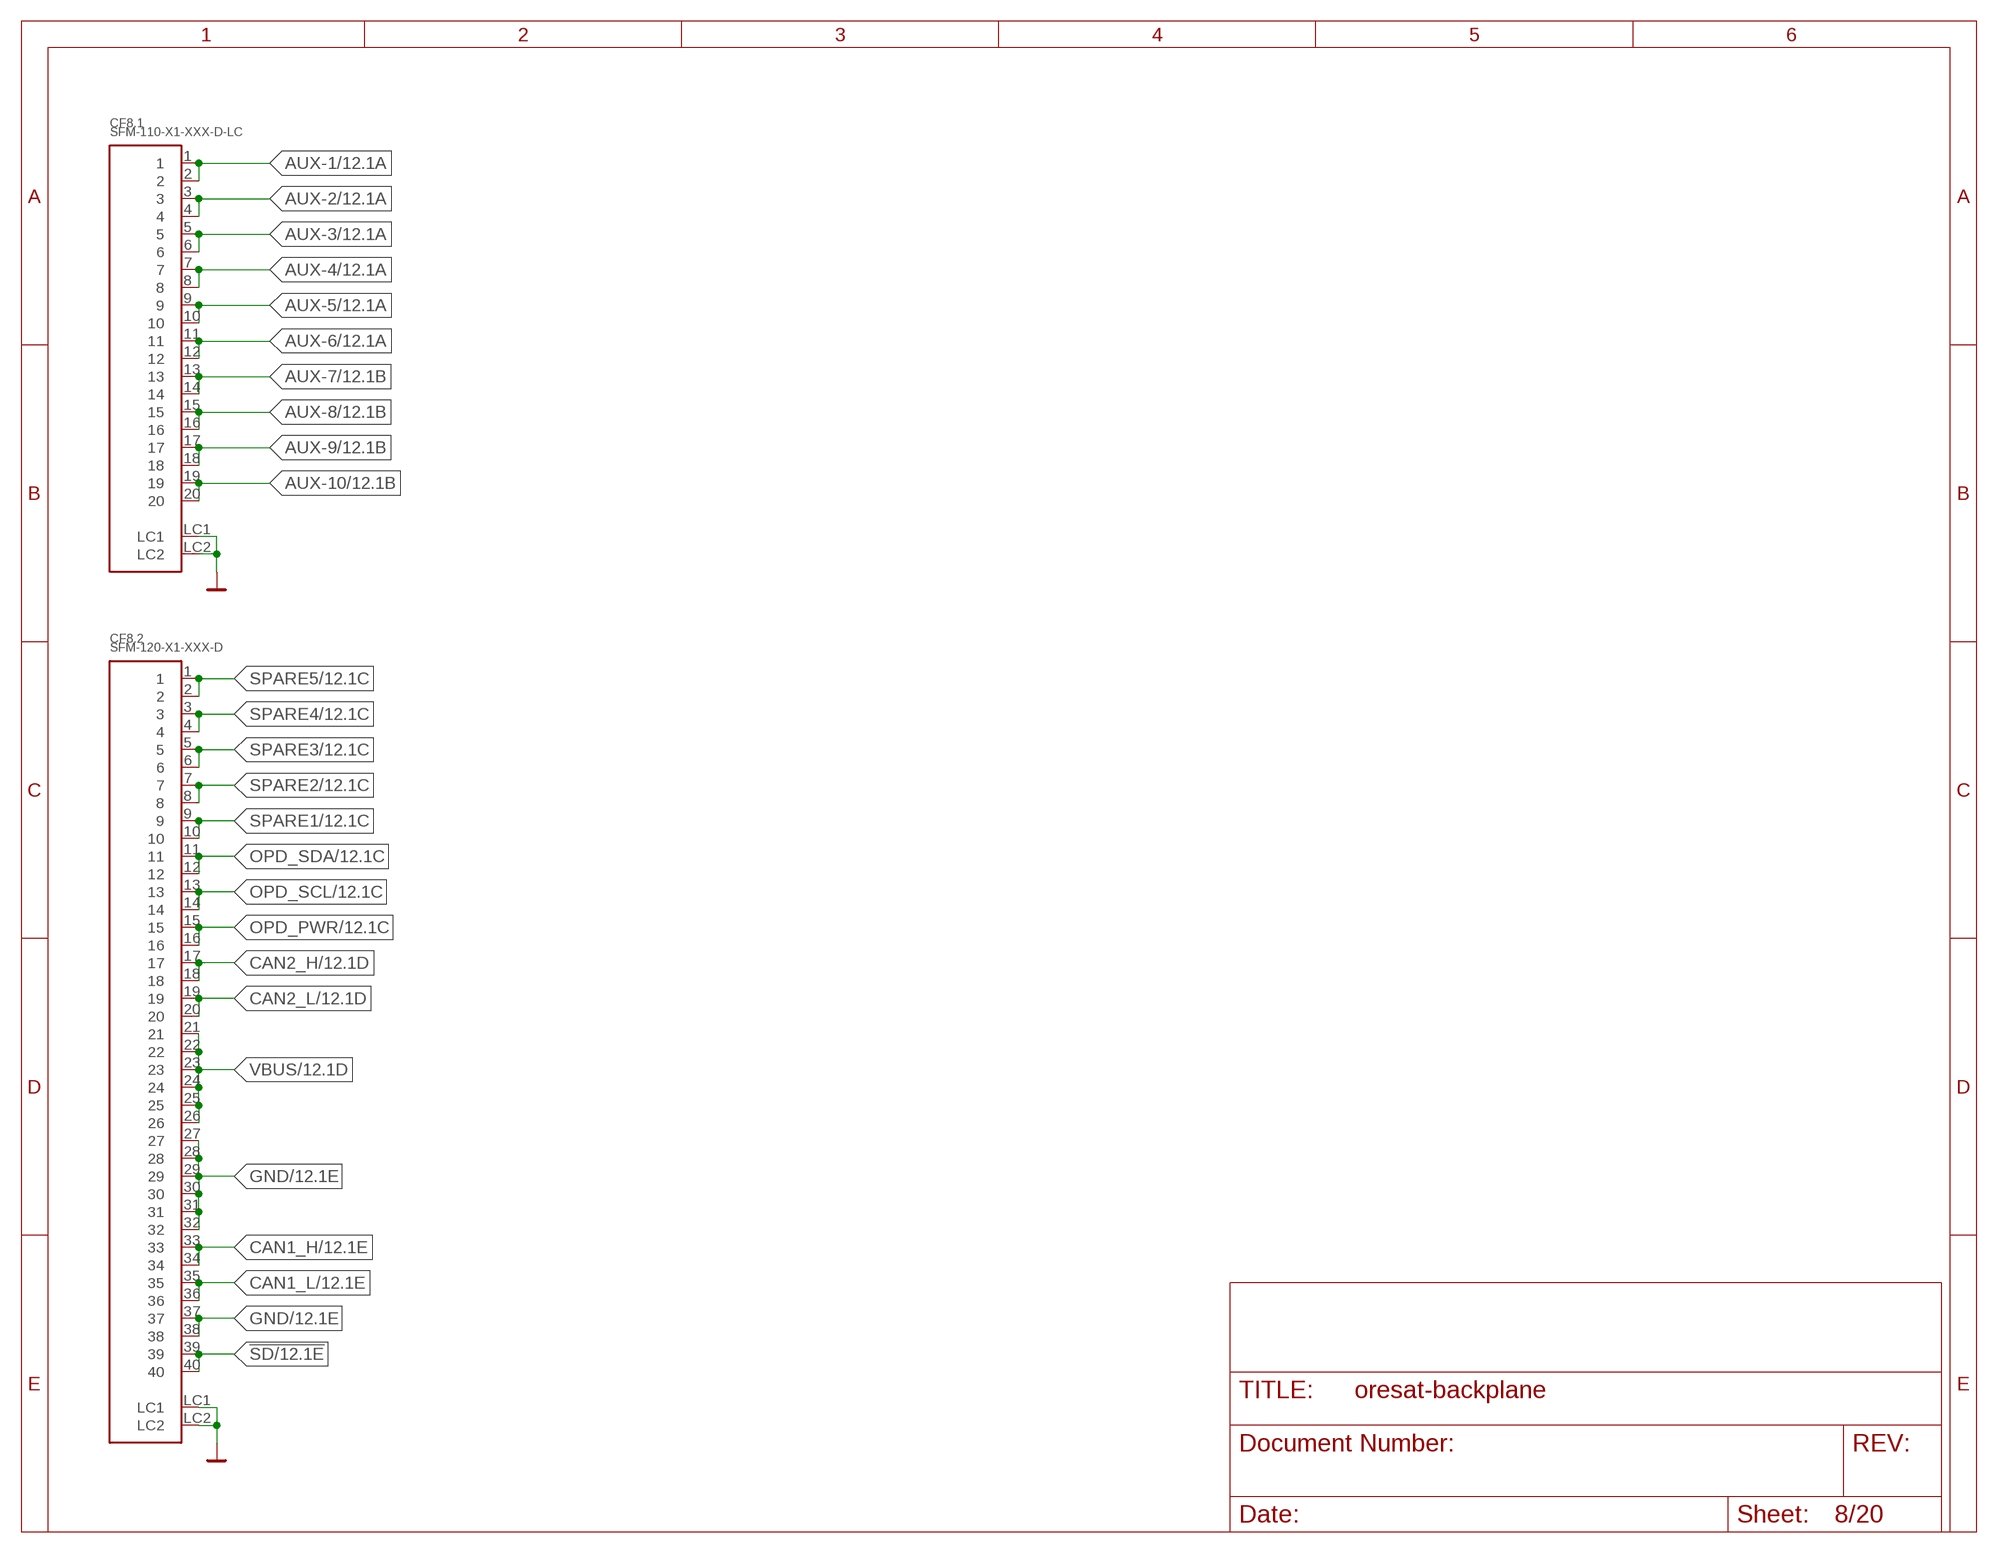
[diagram p7: schematic, sheet 8]

### Parts
CF8.1  SFM-110-X1-XXX-D-LC  [SFM-110-X1-XXX-D-LC]
CF8.2  SFM-120-X1-XXX-D  [SFM-120-X1-XXX-D]

### Nets
!SD: CF8.2.39 CF8.2.40 ; also sheet 1,2,3,4,5,6,7,12,13,14,15,16,17,18,19,20
AUX-1: CF8.1.1 CF8.1.2 ; also sheet 2,3,4,5,6,7,12,13,14,15,16,17,18,19
AUX-2: CF8.1.3 CF8.1.4 ; also sheet 2,3,4,5,6,7,12,13,14,15,16,17,18,19
AUX-3: CF8.1.5 CF8.1.6 ; also sheet 2,3,4,5,6,7,12,13,14,15,16,17,18,19
AUX-4: CF8.1.7 CF8.1.8 ; also sheet 2,3,4,5,6,7,12,13,14,15,16,17,18,19
AUX-5: CF8.1.9 CF8.1.10 ; also sheet 2,3,4,5,6,7,12,13,14,15,16,17,18,19
AUX-6: CF8.1.11 CF8.1.12 ; also sheet 2,3,4,5,6,7,12,13,14,15,16,17,18,19
AUX-7: CF8.1.13 CF8.1.14 ; also sheet 2,3,4,5,6,7,12,13,14,15,16,17,18,19
AUX-8: CF8.1.15 CF8.1.16 ; also sheet 2,3,4,5,6,7,12,13,14,15,16,17,18,19
AUX-9: CF8.1.17 CF8.1.18 ; also sheet 2,3,4,5,6,7,12,13,14,15,16,17,18,19
AUX-10: CF8.1.19 CF8.1.20 ; also sheet 2,3,4,5,6,7,12,13,14,15,16,17,18,19
CAN1_H: CF8.2.33 CF8.2.34 ; also sheet 1,2,3,4,5,6,7,12,13,14,15,16,17,18,19,20
CAN1_L: CF8.2.35 CF8.2.36 ; also sheet 1,2,3,4,5,6,7,12,13,14,15,16,17,18,19,20
CAN2_H: CF8.2.17 CF8.2.18 ; also sheet 1,2,3,4,5,6,7,12,13,14,15,16,17,18,19,20
CAN2_L: CF8.2.19 CF8.2.20 ; also sheet 1,2,3,4,5,6,7,12,13,14,15,16,17,18,19,20
GND: CF8.1.LC1 CF8.1.LC2 CF8.2.27 CF8.2.28 CF8.2.29 CF8.2.30 CF8.2.31 CF8.2.32 CF8.2.37 CF8.2.38 CF8.2.LC1 CF8.2.LC2 ; also sheet 1,2,3,4,5,6,7,12,13,14,15,16,17,18,19,20
OPD_PWR: CF8.2.15 CF8.2.16 ; also sheet 1,2,3,4,5,6,7,12,13,14,15,16,17,18,19,20
OPD_SCL: CF8.2.13 CF8.2.14 ; also sheet 1,2,3,4,5,6,7,12,13,14,15,16,17,18,19,20
OPD_SDA: CF8.2.11 CF8.2.12 ; also sheet 1,2,3,4,5,6,7,12,13,14,15,16,17,18,19,20
SPARE1: CF8.2.9 CF8.2.10 ; also sheet 1,2,3,4,5,6,7,12,13,14,15,16,17,18,19,20
SPARE2: CF8.2.7 CF8.2.8 ; also sheet 1,2,3,4,5,6,7,12,13,14,15,16,17,18,19,20
SPARE3: CF8.2.5 CF8.2.6 ; also sheet 1,2,3,4,5,6,7,12,13,14,15,16,17,18,19,20
SPARE4: CF8.2.3 CF8.2.4 ; also sheet 1,2,3,4,5,6,7,12,13,14,15,16,17,18,19,20
SPARE5: CF8.2.1 CF8.2.2 ; also sheet 1,2,3,4,5,6,7,12,13,14,15,16,17,18,19,20
VBUS: CF8.2.21 CF8.2.22 CF8.2.23 CF8.2.24 CF8.2.25 CF8.2.26 ; also sheet 1,2,3,4,5,6,7,12,13,14,15,16,17,18,19,20

## Sheet 9 of 20: Slot 9
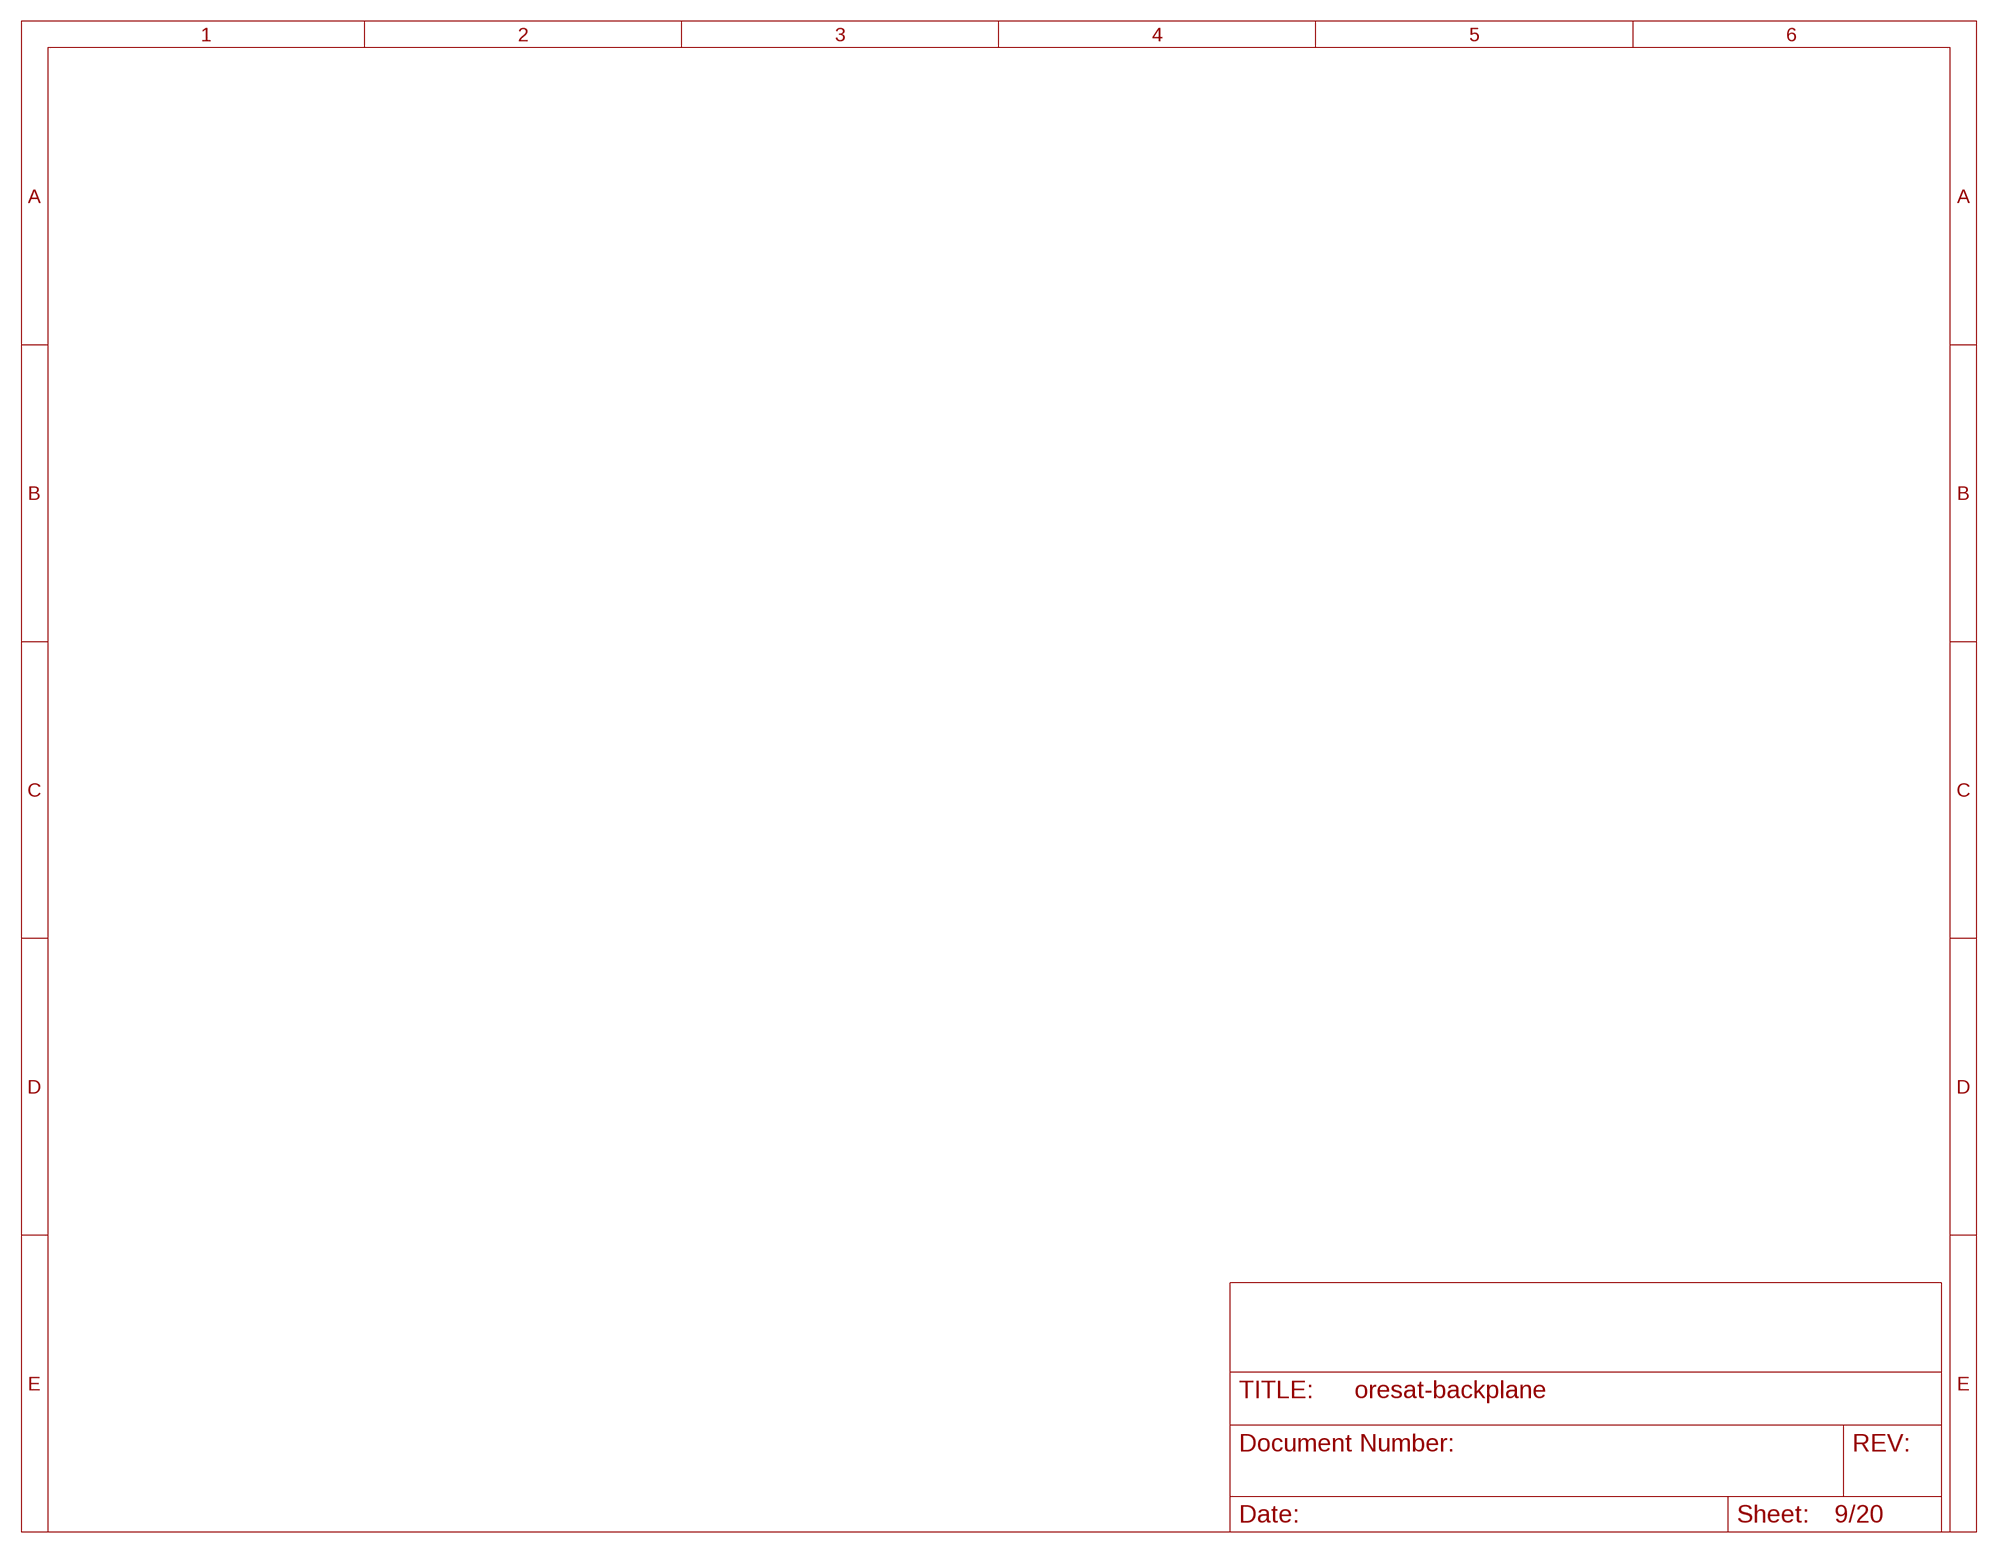
[diagram p8: schematic, sheet 9]

## Sheet 10 of 20: Slot 10
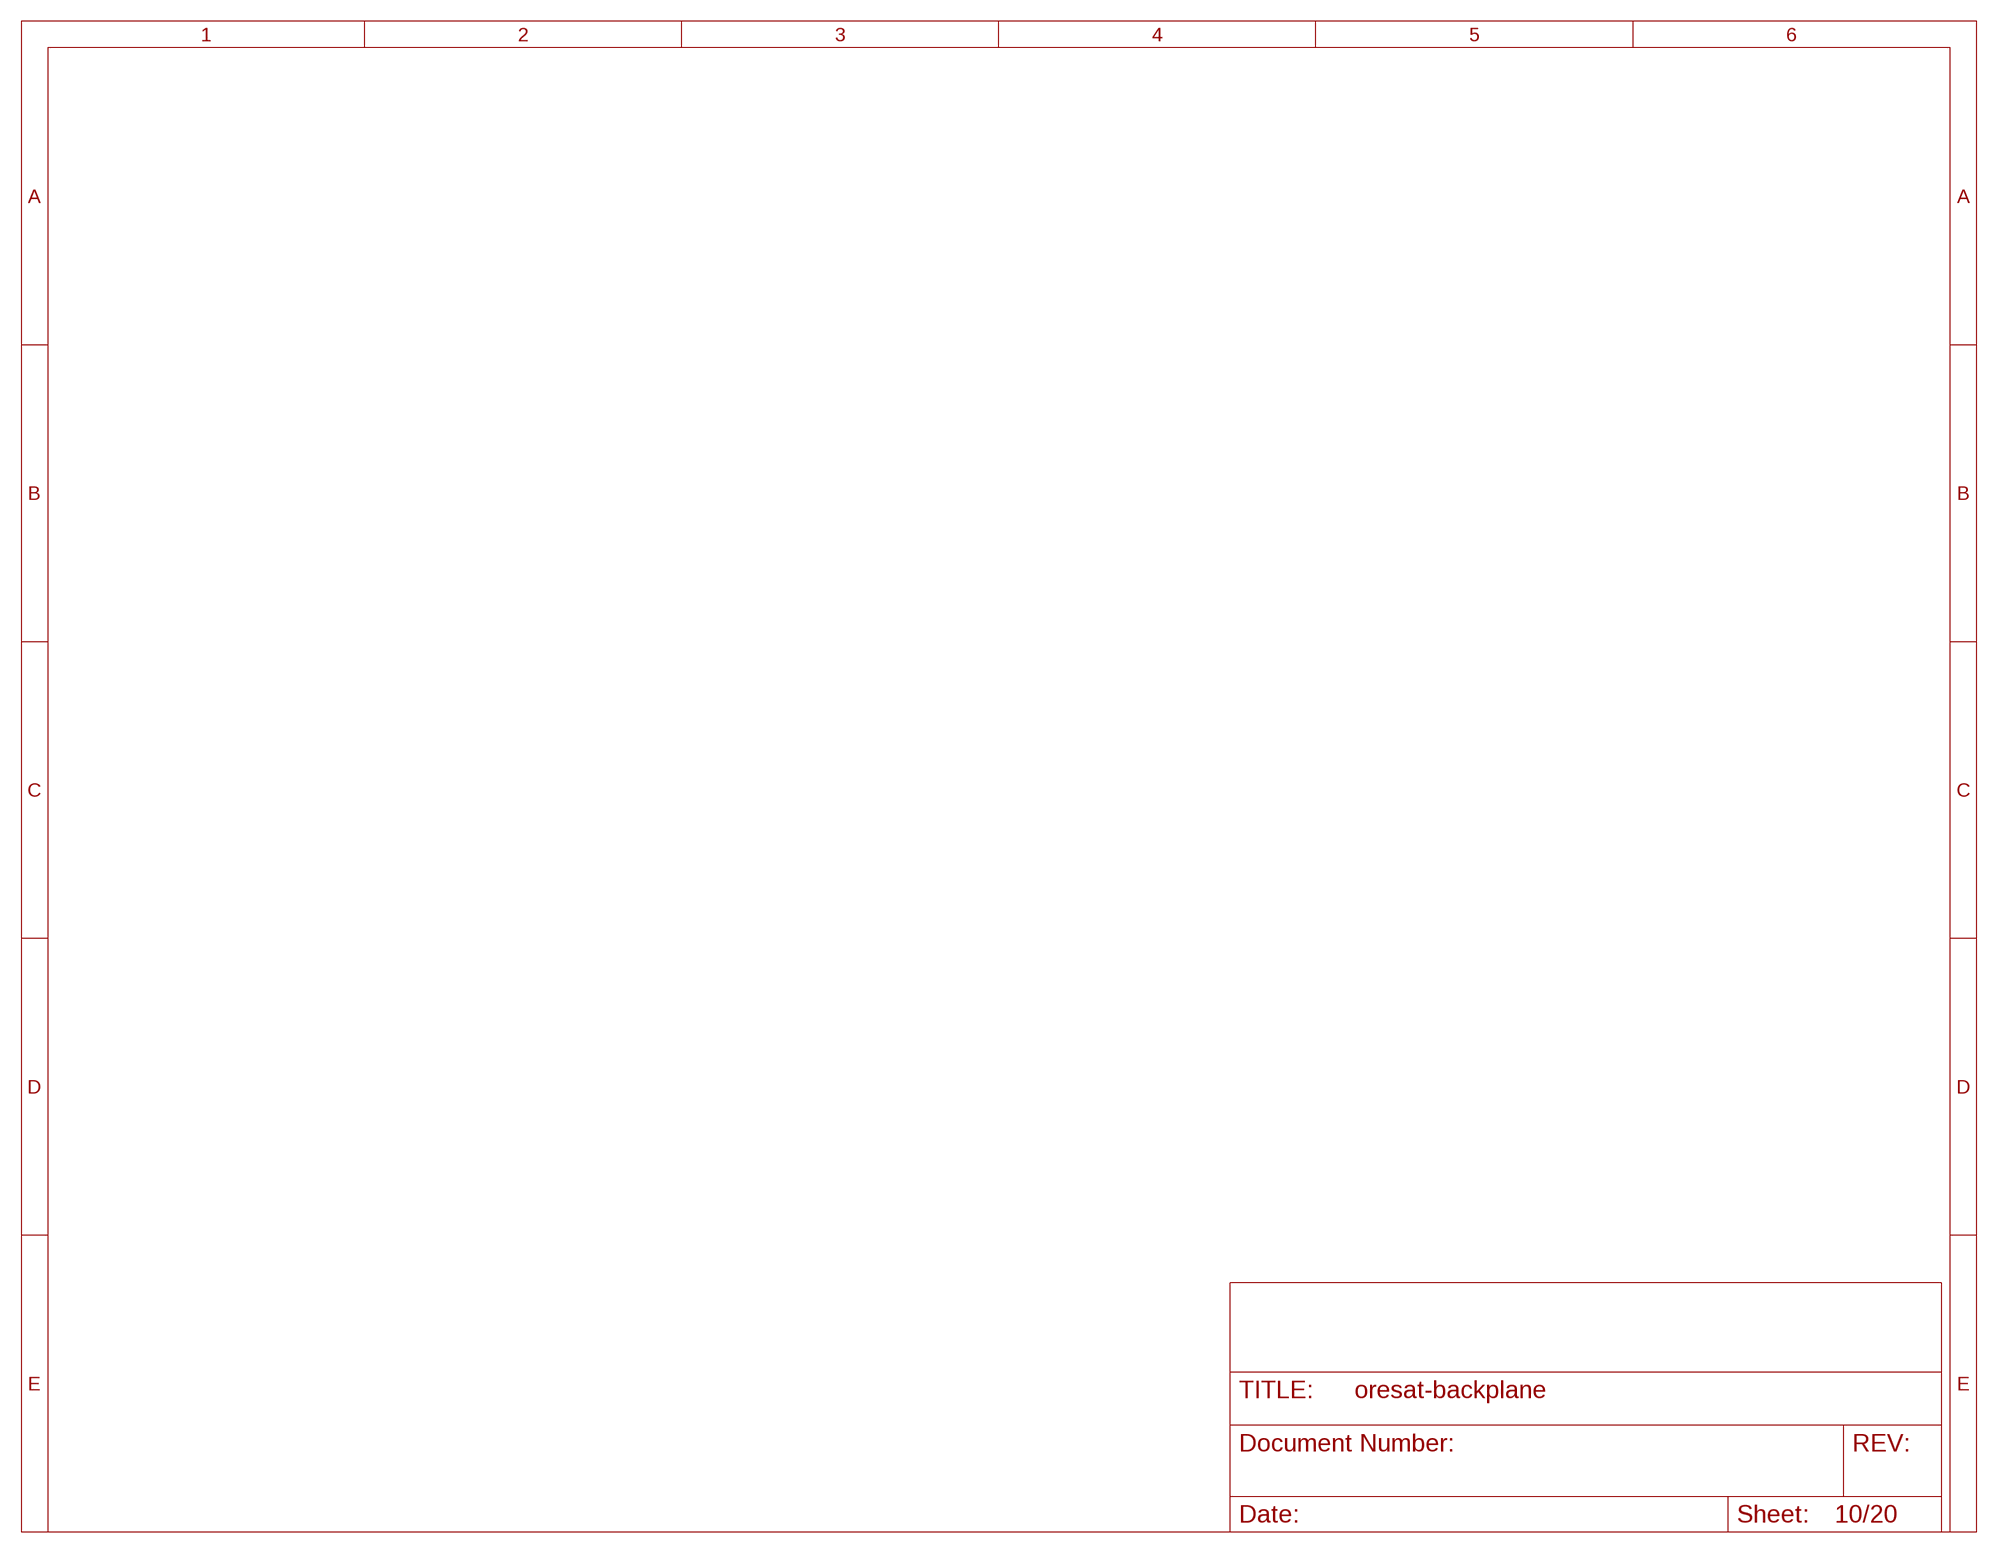
[diagram p9: schematic, sheet 10]

## Sheet 11 of 20: Slot 11
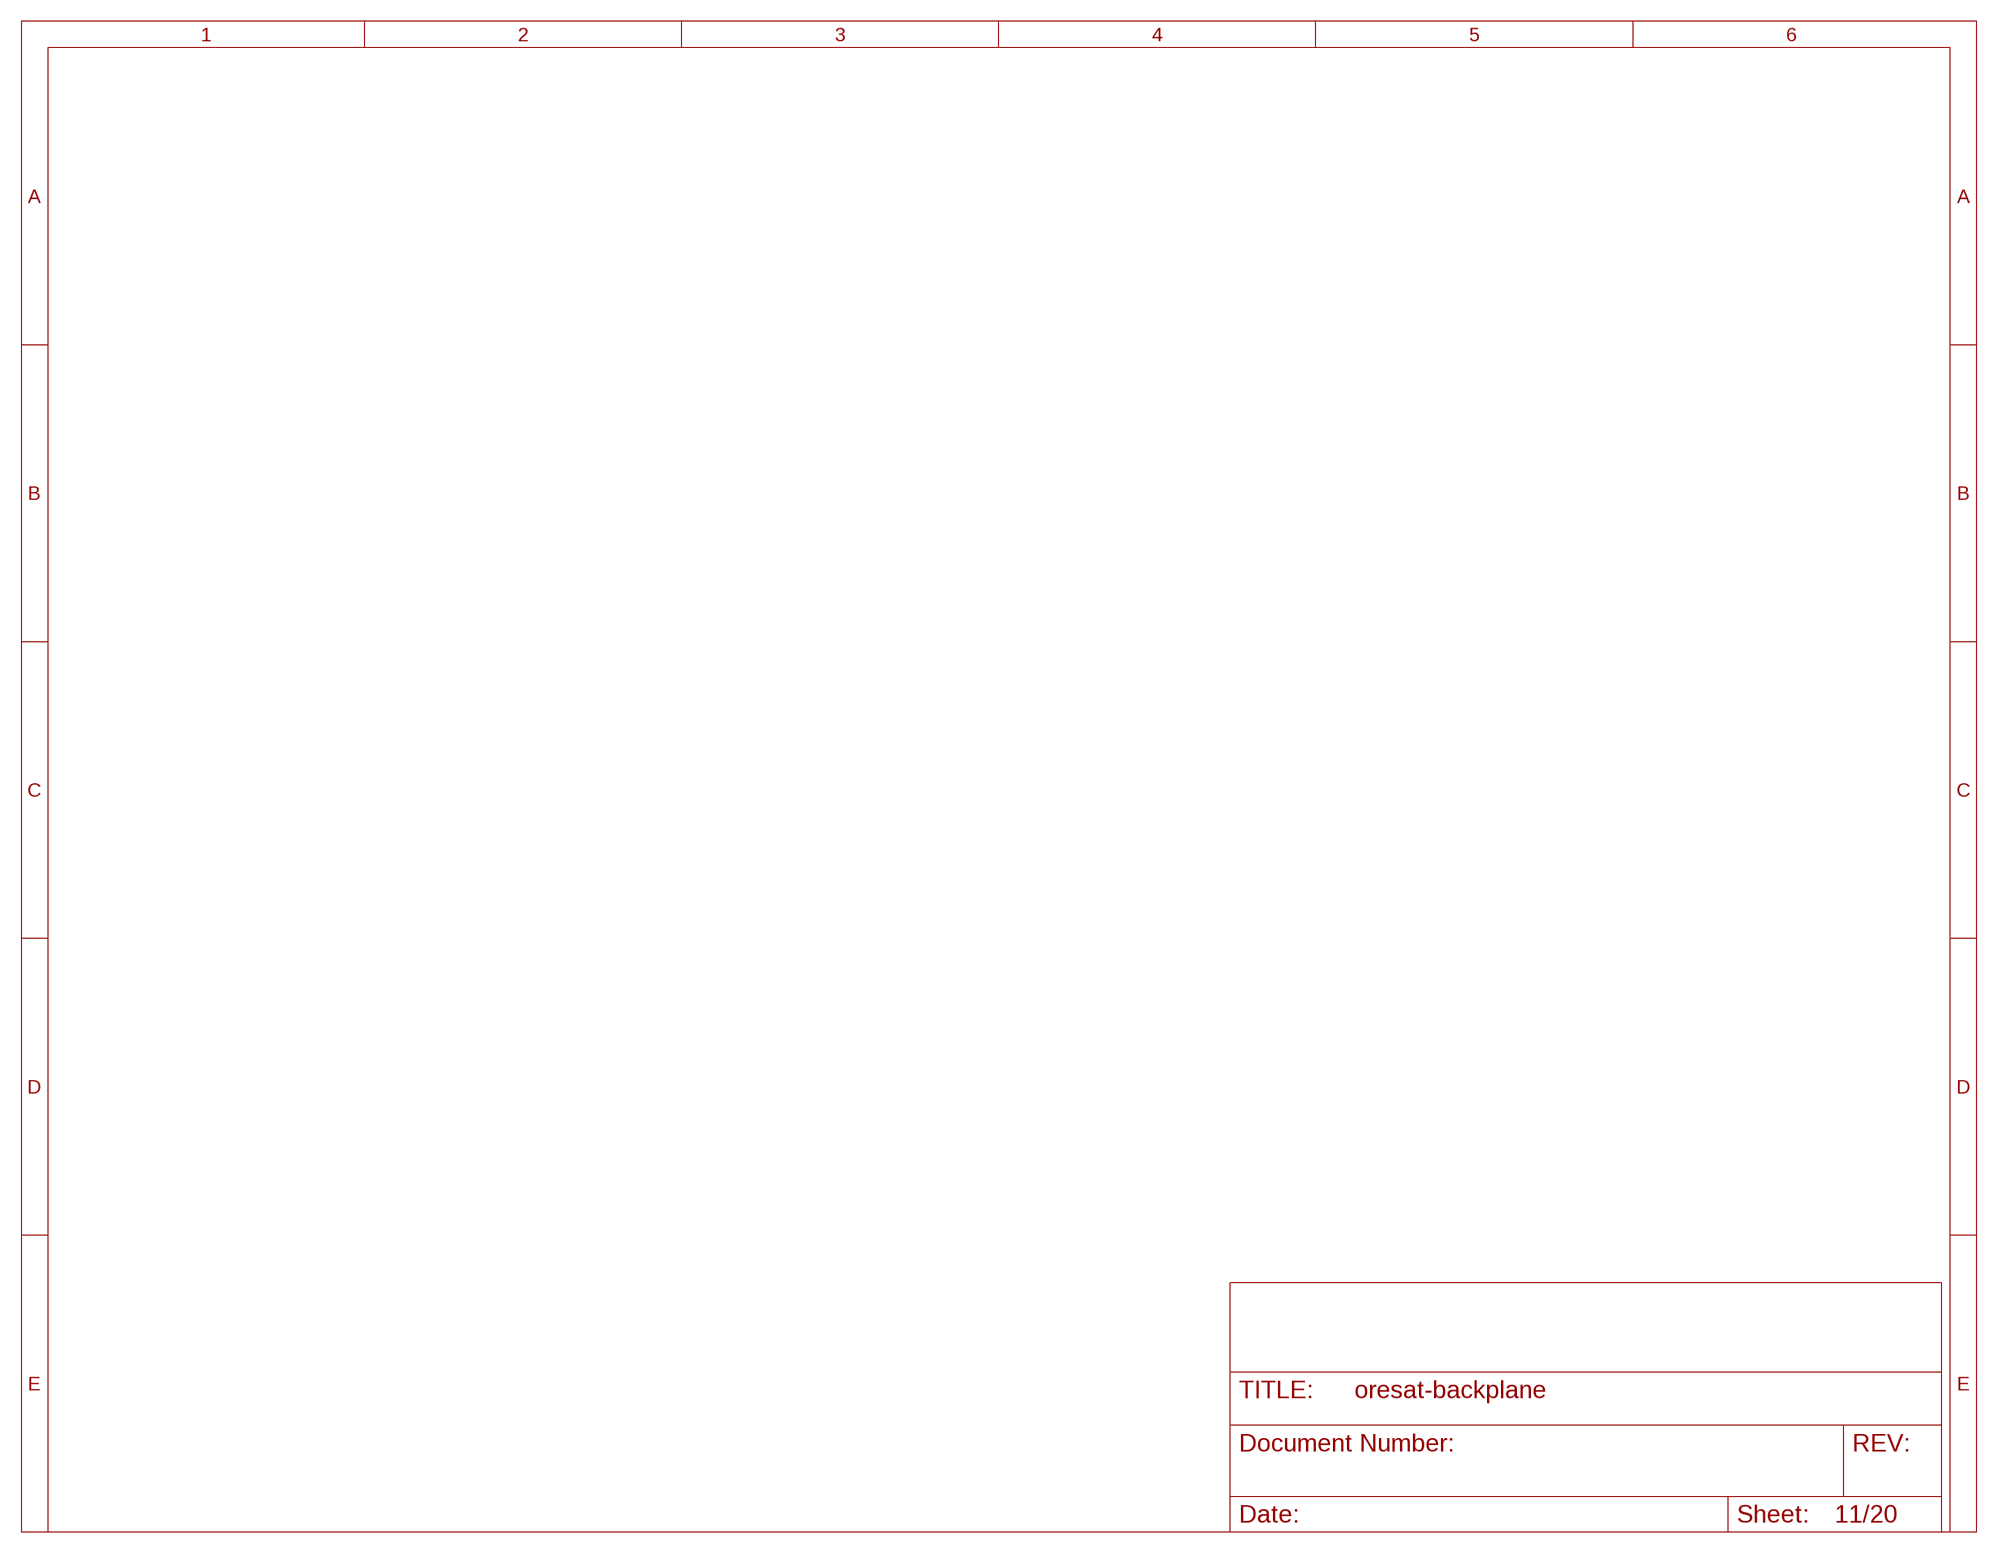
[diagram p10: schematic, sheet 11]

## Sheet 12 of 20: Slot 12
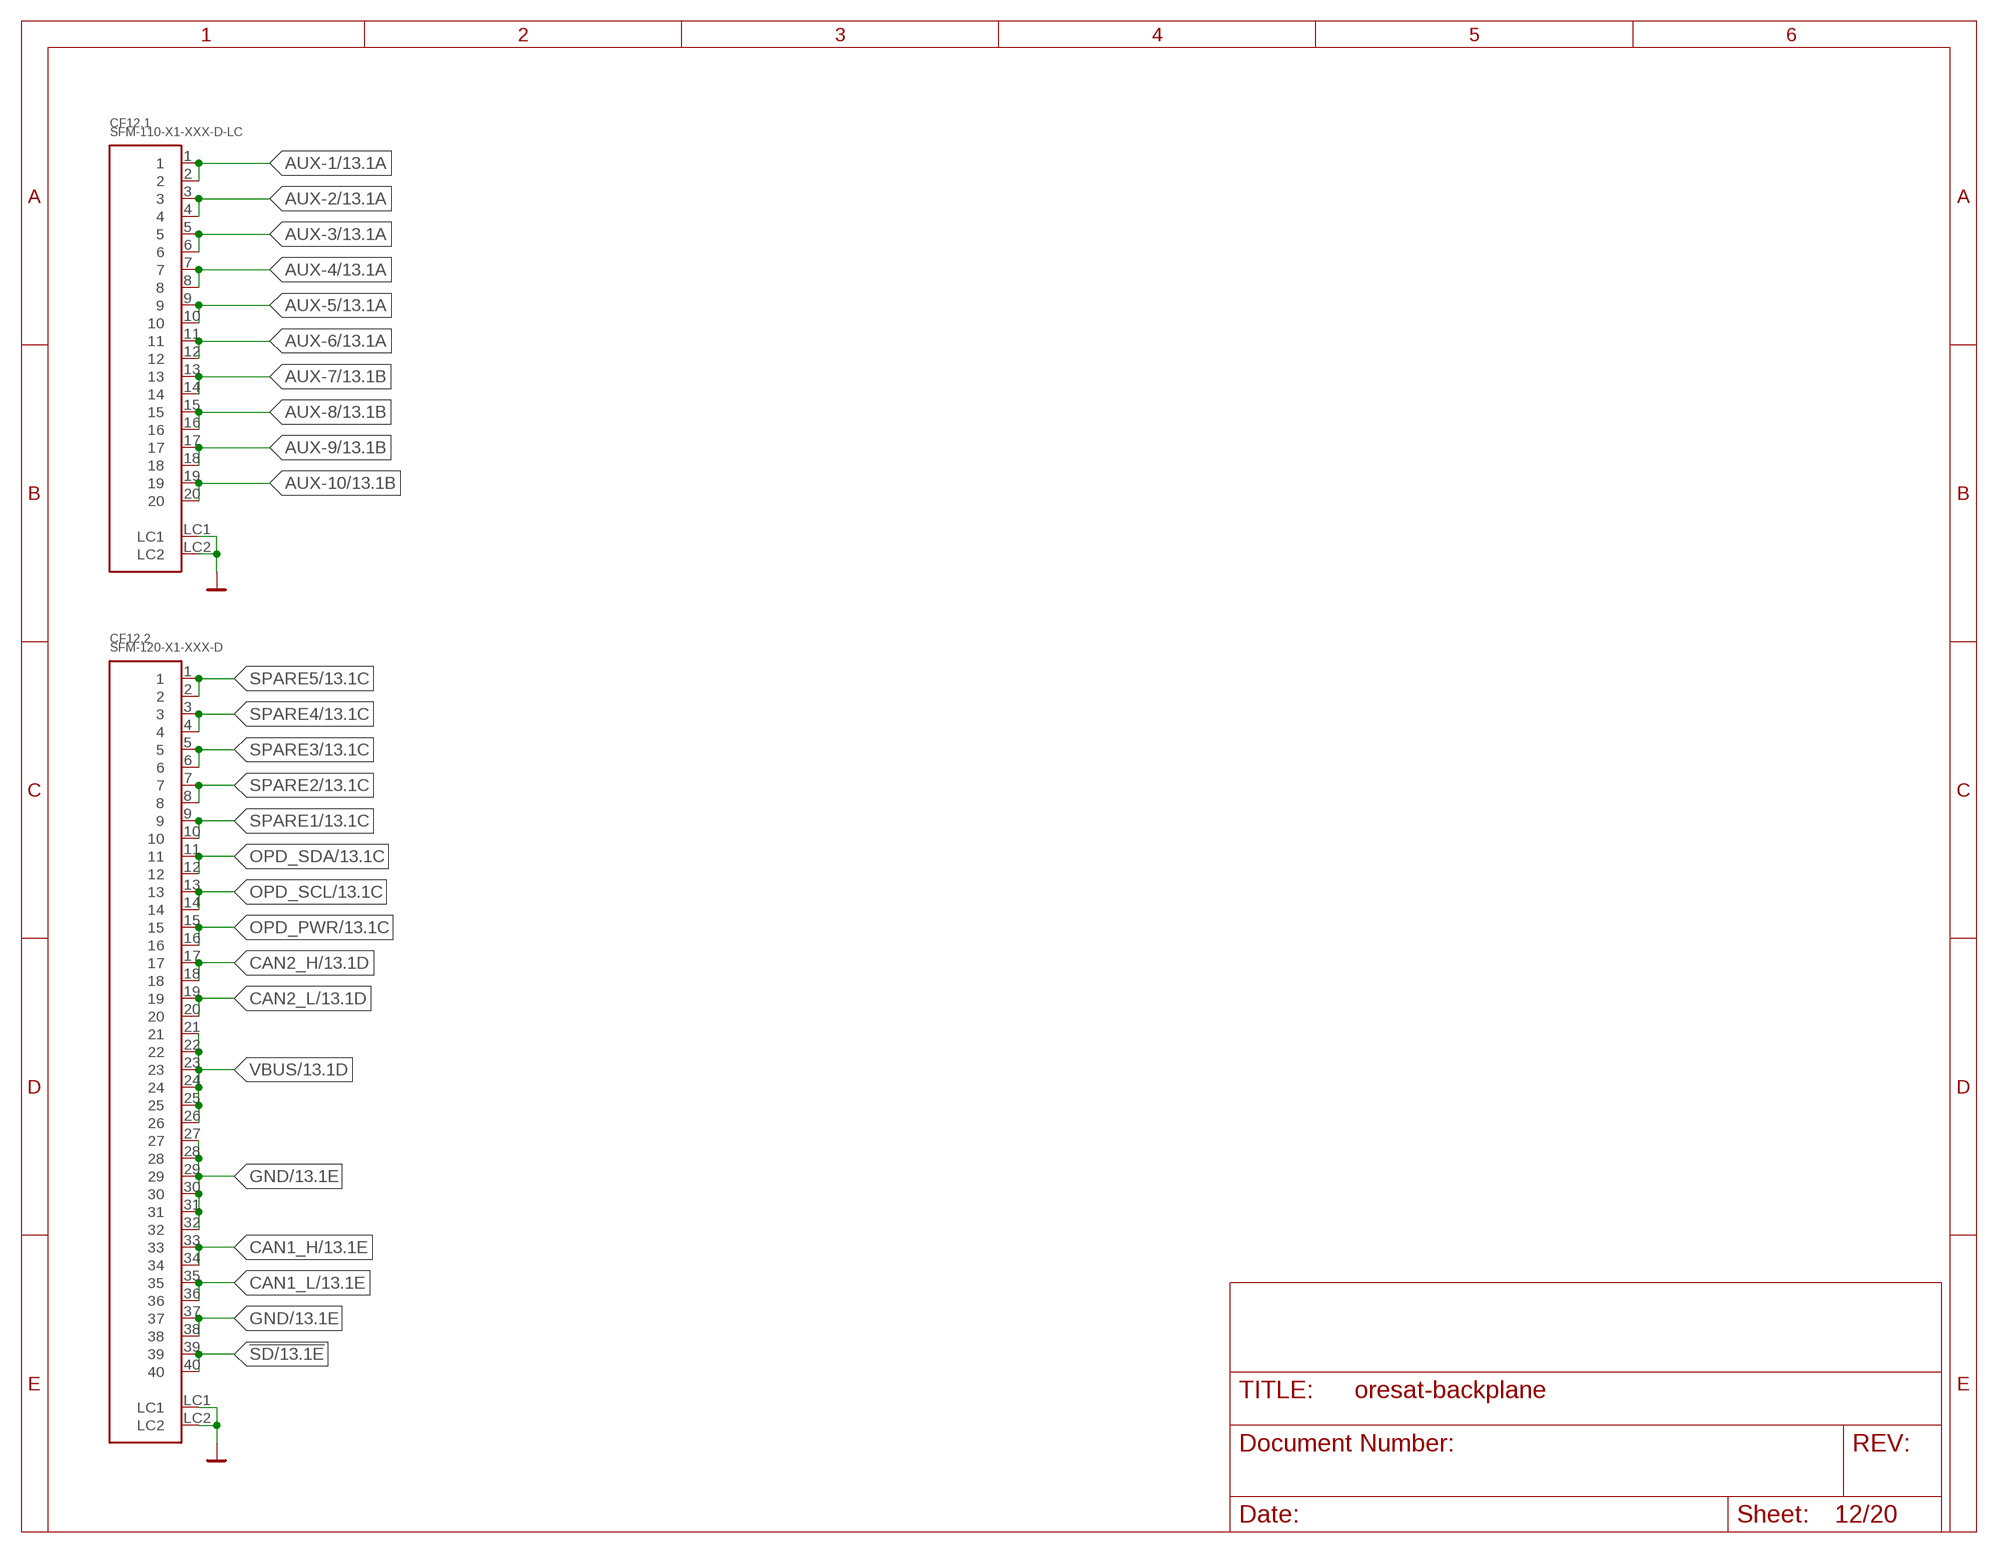
[diagram p11: schematic, sheet 12]

### Parts
CF12.1  SFM-110-X1-XXX-D-LC  [SFM-110-X1-XXX-D-LC]
CF12.2  SFM-120-X1-XXX-D  [SFM-120-X1-XXX-D]

### Nets
!SD: CF12.2.39 CF12.2.40 ; also sheet 1,2,3,4,5,6,7,8,13,14,15,16,17,18,19,20
AUX-1: CF12.1.1 CF12.1.2 ; also sheet 2,3,4,5,6,7,8,13,14,15,16,17,18,19
AUX-2: CF12.1.3 CF12.1.4 ; also sheet 2,3,4,5,6,7,8,13,14,15,16,17,18,19
AUX-3: CF12.1.5 CF12.1.6 ; also sheet 2,3,4,5,6,7,8,13,14,15,16,17,18,19
AUX-4: CF12.1.7 CF12.1.8 ; also sheet 2,3,4,5,6,7,8,13,14,15,16,17,18,19
AUX-5: CF12.1.9 CF12.1.10 ; also sheet 2,3,4,5,6,7,8,13,14,15,16,17,18,19
AUX-6: CF12.1.11 CF12.1.12 ; also sheet 2,3,4,5,6,7,8,13,14,15,16,17,18,19
AUX-7: CF12.1.13 CF12.1.14 ; also sheet 2,3,4,5,6,7,8,13,14,15,16,17,18,19
AUX-8: CF12.1.15 CF12.1.16 ; also sheet 2,3,4,5,6,7,8,13,14,15,16,17,18,19
AUX-9: CF12.1.17 CF12.1.18 ; also sheet 2,3,4,5,6,7,8,13,14,15,16,17,18,19
AUX-10: CF12.1.19 CF12.1.20 ; also sheet 2,3,4,5,6,7,8,13,14,15,16,17,18,19
CAN1_H: CF12.2.33 CF12.2.34 ; also sheet 1,2,3,4,5,6,7,8,13,14,15,16,17,18,19,20
CAN1_L: CF12.2.35 CF12.2.36 ; also sheet 1,2,3,4,5,6,7,8,13,14,15,16,17,18,19,20
CAN2_H: CF12.2.17 CF12.2.18 ; also sheet 1,2,3,4,5,6,7,8,13,14,15,16,17,18,19,20
CAN2_L: CF12.2.19 CF12.2.20 ; also sheet 1,2,3,4,5,6,7,8,13,14,15,16,17,18,19,20
GND: CF12.1.LC1 CF12.1.LC2 CF12.2.27 CF12.2.28 CF12.2.29 CF12.2.30 CF12.2.31 CF12.2.32 CF12.2.37 CF12.2.38 CF12.2.LC1 CF12.2.LC2 ; also sheet 1,2,3,4,5,6,7,8,13,14,15,16,17,18,19,20
OPD_PWR: CF12.2.15 CF12.2.16 ; also sheet 1,2,3,4,5,6,7,8,13,14,15,16,17,18,19,20
OPD_SCL: CF12.2.13 CF12.2.14 ; also sheet 1,2,3,4,5,6,7,8,13,14,15,16,17,18,19,20
OPD_SDA: CF12.2.11 CF12.2.12 ; also sheet 1,2,3,4,5,6,7,8,13,14,15,16,17,18,19,20
SPARE1: CF12.2.9 CF12.2.10 ; also sheet 1,2,3,4,5,6,7,8,13,14,15,16,17,18,19,20
SPARE2: CF12.2.7 CF12.2.8 ; also sheet 1,2,3,4,5,6,7,8,13,14,15,16,17,18,19,20
SPARE3: CF12.2.5 CF12.2.6 ; also sheet 1,2,3,4,5,6,7,8,13,14,15,16,17,18,19,20
SPARE4: CF12.2.3 CF12.2.4 ; also sheet 1,2,3,4,5,6,7,8,13,14,15,16,17,18,19,20
SPARE5: CF12.2.1 CF12.2.2 ; also sheet 1,2,3,4,5,6,7,8,13,14,15,16,17,18,19,20
VBUS: CF12.2.21 CF12.2.22 CF12.2.23 CF12.2.24 CF12.2.25 CF12.2.26 ; also sheet 1,2,3,4,5,6,7,8,13,14,15,16,17,18,19,20

## Sheet 13 of 20: Slot 13
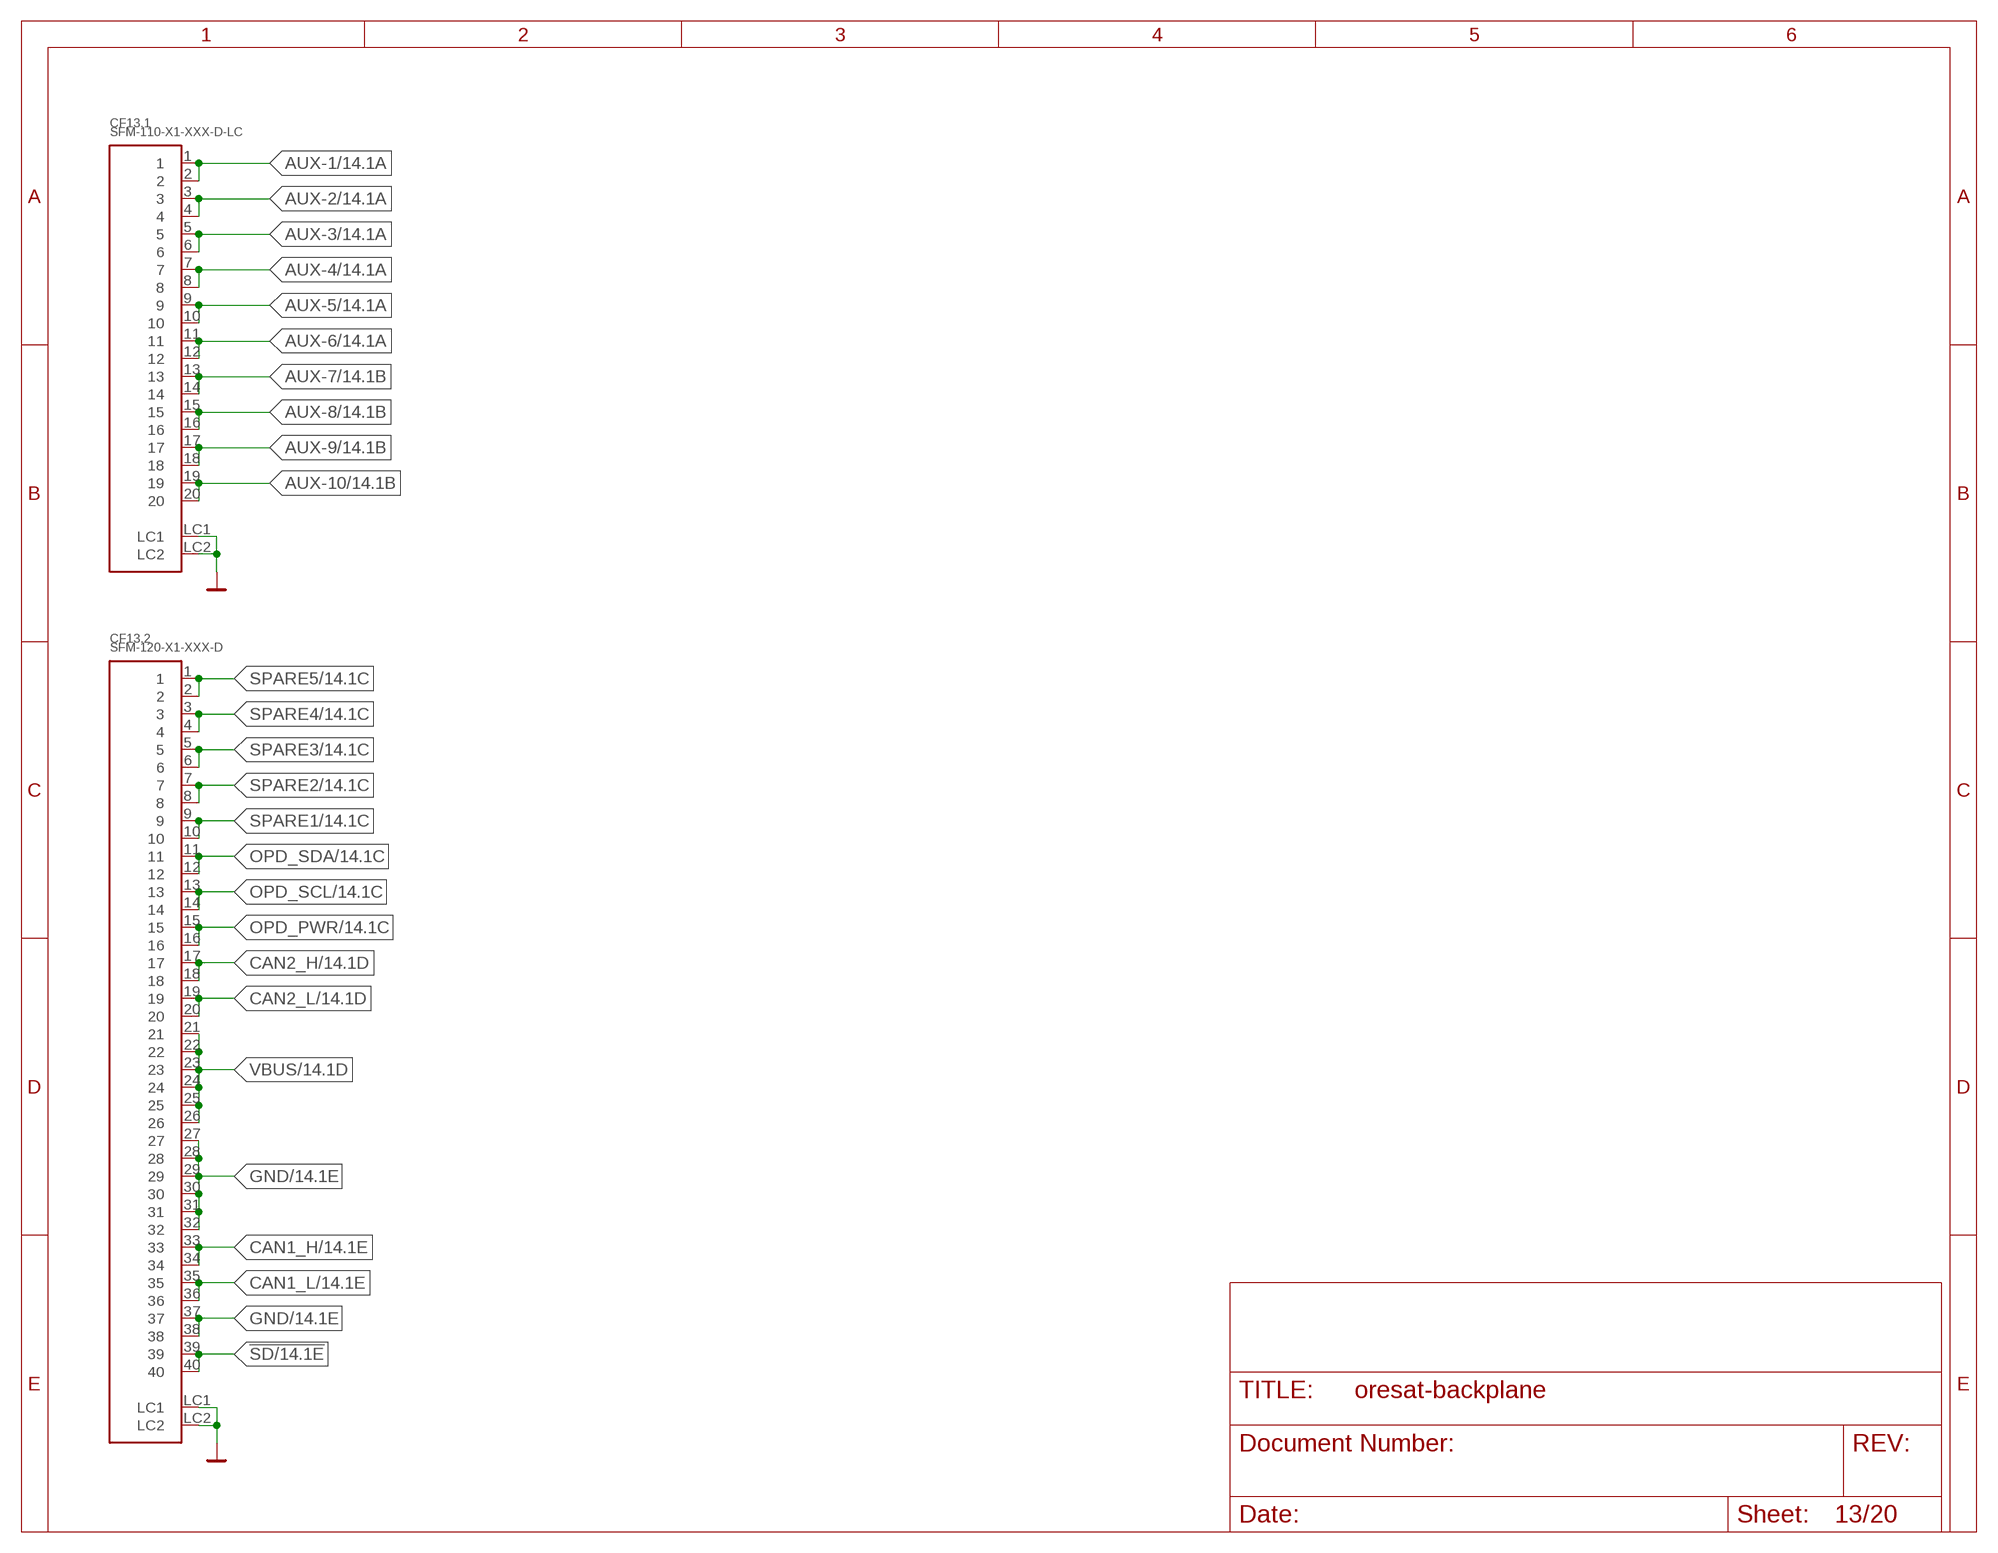
[diagram p12: schematic, sheet 13]

### Parts
CF13.1  SFM-110-X1-XXX-D-LC  [SFM-110-X1-XXX-D-LC]
CF13.2  SFM-120-X1-XXX-D  [SFM-120-X1-XXX-D]

### Nets
!SD: CF13.2.39 CF13.2.40 ; also sheet 1,2,3,4,5,6,7,8,12,14,15,16,17,18,19,20
AUX-1: CF13.1.1 CF13.1.2 ; also sheet 2,3,4,5,6,7,8,12,14,15,16,17,18,19
AUX-2: CF13.1.3 CF13.1.4 ; also sheet 2,3,4,5,6,7,8,12,14,15,16,17,18,19
AUX-3: CF13.1.5 CF13.1.6 ; also sheet 2,3,4,5,6,7,8,12,14,15,16,17,18,19
AUX-4: CF13.1.7 CF13.1.8 ; also sheet 2,3,4,5,6,7,8,12,14,15,16,17,18,19
AUX-5: CF13.1.9 CF13.1.10 ; also sheet 2,3,4,5,6,7,8,12,14,15,16,17,18,19
AUX-6: CF13.1.11 CF13.1.12 ; also sheet 2,3,4,5,6,7,8,12,14,15,16,17,18,19
AUX-7: CF13.1.13 CF13.1.14 ; also sheet 2,3,4,5,6,7,8,12,14,15,16,17,18,19
AUX-8: CF13.1.15 CF13.1.16 ; also sheet 2,3,4,5,6,7,8,12,14,15,16,17,18,19
AUX-9: CF13.1.17 CF13.1.18 ; also sheet 2,3,4,5,6,7,8,12,14,15,16,17,18,19
AUX-10: CF13.1.19 CF13.1.20 ; also sheet 2,3,4,5,6,7,8,12,14,15,16,17,18,19
CAN1_H: CF13.2.33 CF13.2.34 ; also sheet 1,2,3,4,5,6,7,8,12,14,15,16,17,18,19,20
CAN1_L: CF13.2.35 CF13.2.36 ; also sheet 1,2,3,4,5,6,7,8,12,14,15,16,17,18,19,20
CAN2_H: CF13.2.17 CF13.2.18 ; also sheet 1,2,3,4,5,6,7,8,12,14,15,16,17,18,19,20
CAN2_L: CF13.2.19 CF13.2.20 ; also sheet 1,2,3,4,5,6,7,8,12,14,15,16,17,18,19,20
GND: CF13.1.LC1 CF13.1.LC2 CF13.2.27 CF13.2.28 CF13.2.29 CF13.2.30 CF13.2.31 CF13.2.32 CF13.2.37 CF13.2.38 CF13.2.LC1 CF13.2.LC2 ; also sheet 1,2,3,4,5,6,7,8,12,14,15,16,17,18,19,20
OPD_PWR: CF13.2.15 CF13.2.16 ; also sheet 1,2,3,4,5,6,7,8,12,14,15,16,17,18,19,20
OPD_SCL: CF13.2.13 CF13.2.14 ; also sheet 1,2,3,4,5,6,7,8,12,14,15,16,17,18,19,20
OPD_SDA: CF13.2.11 CF13.2.12 ; also sheet 1,2,3,4,5,6,7,8,12,14,15,16,17,18,19,20
SPARE1: CF13.2.9 CF13.2.10 ; also sheet 1,2,3,4,5,6,7,8,12,14,15,16,17,18,19,20
SPARE2: CF13.2.7 CF13.2.8 ; also sheet 1,2,3,4,5,6,7,8,12,14,15,16,17,18,19,20
SPARE3: CF13.2.5 CF13.2.6 ; also sheet 1,2,3,4,5,6,7,8,12,14,15,16,17,18,19,20
SPARE4: CF13.2.3 CF13.2.4 ; also sheet 1,2,3,4,5,6,7,8,12,14,15,16,17,18,19,20
SPARE5: CF13.2.1 CF13.2.2 ; also sheet 1,2,3,4,5,6,7,8,12,14,15,16,17,18,19,20
VBUS: CF13.2.21 CF13.2.22 CF13.2.23 CF13.2.24 CF13.2.25 CF13.2.26 ; also sheet 1,2,3,4,5,6,7,8,12,14,15,16,17,18,19,20

## Sheet 14 of 20: Slot 14
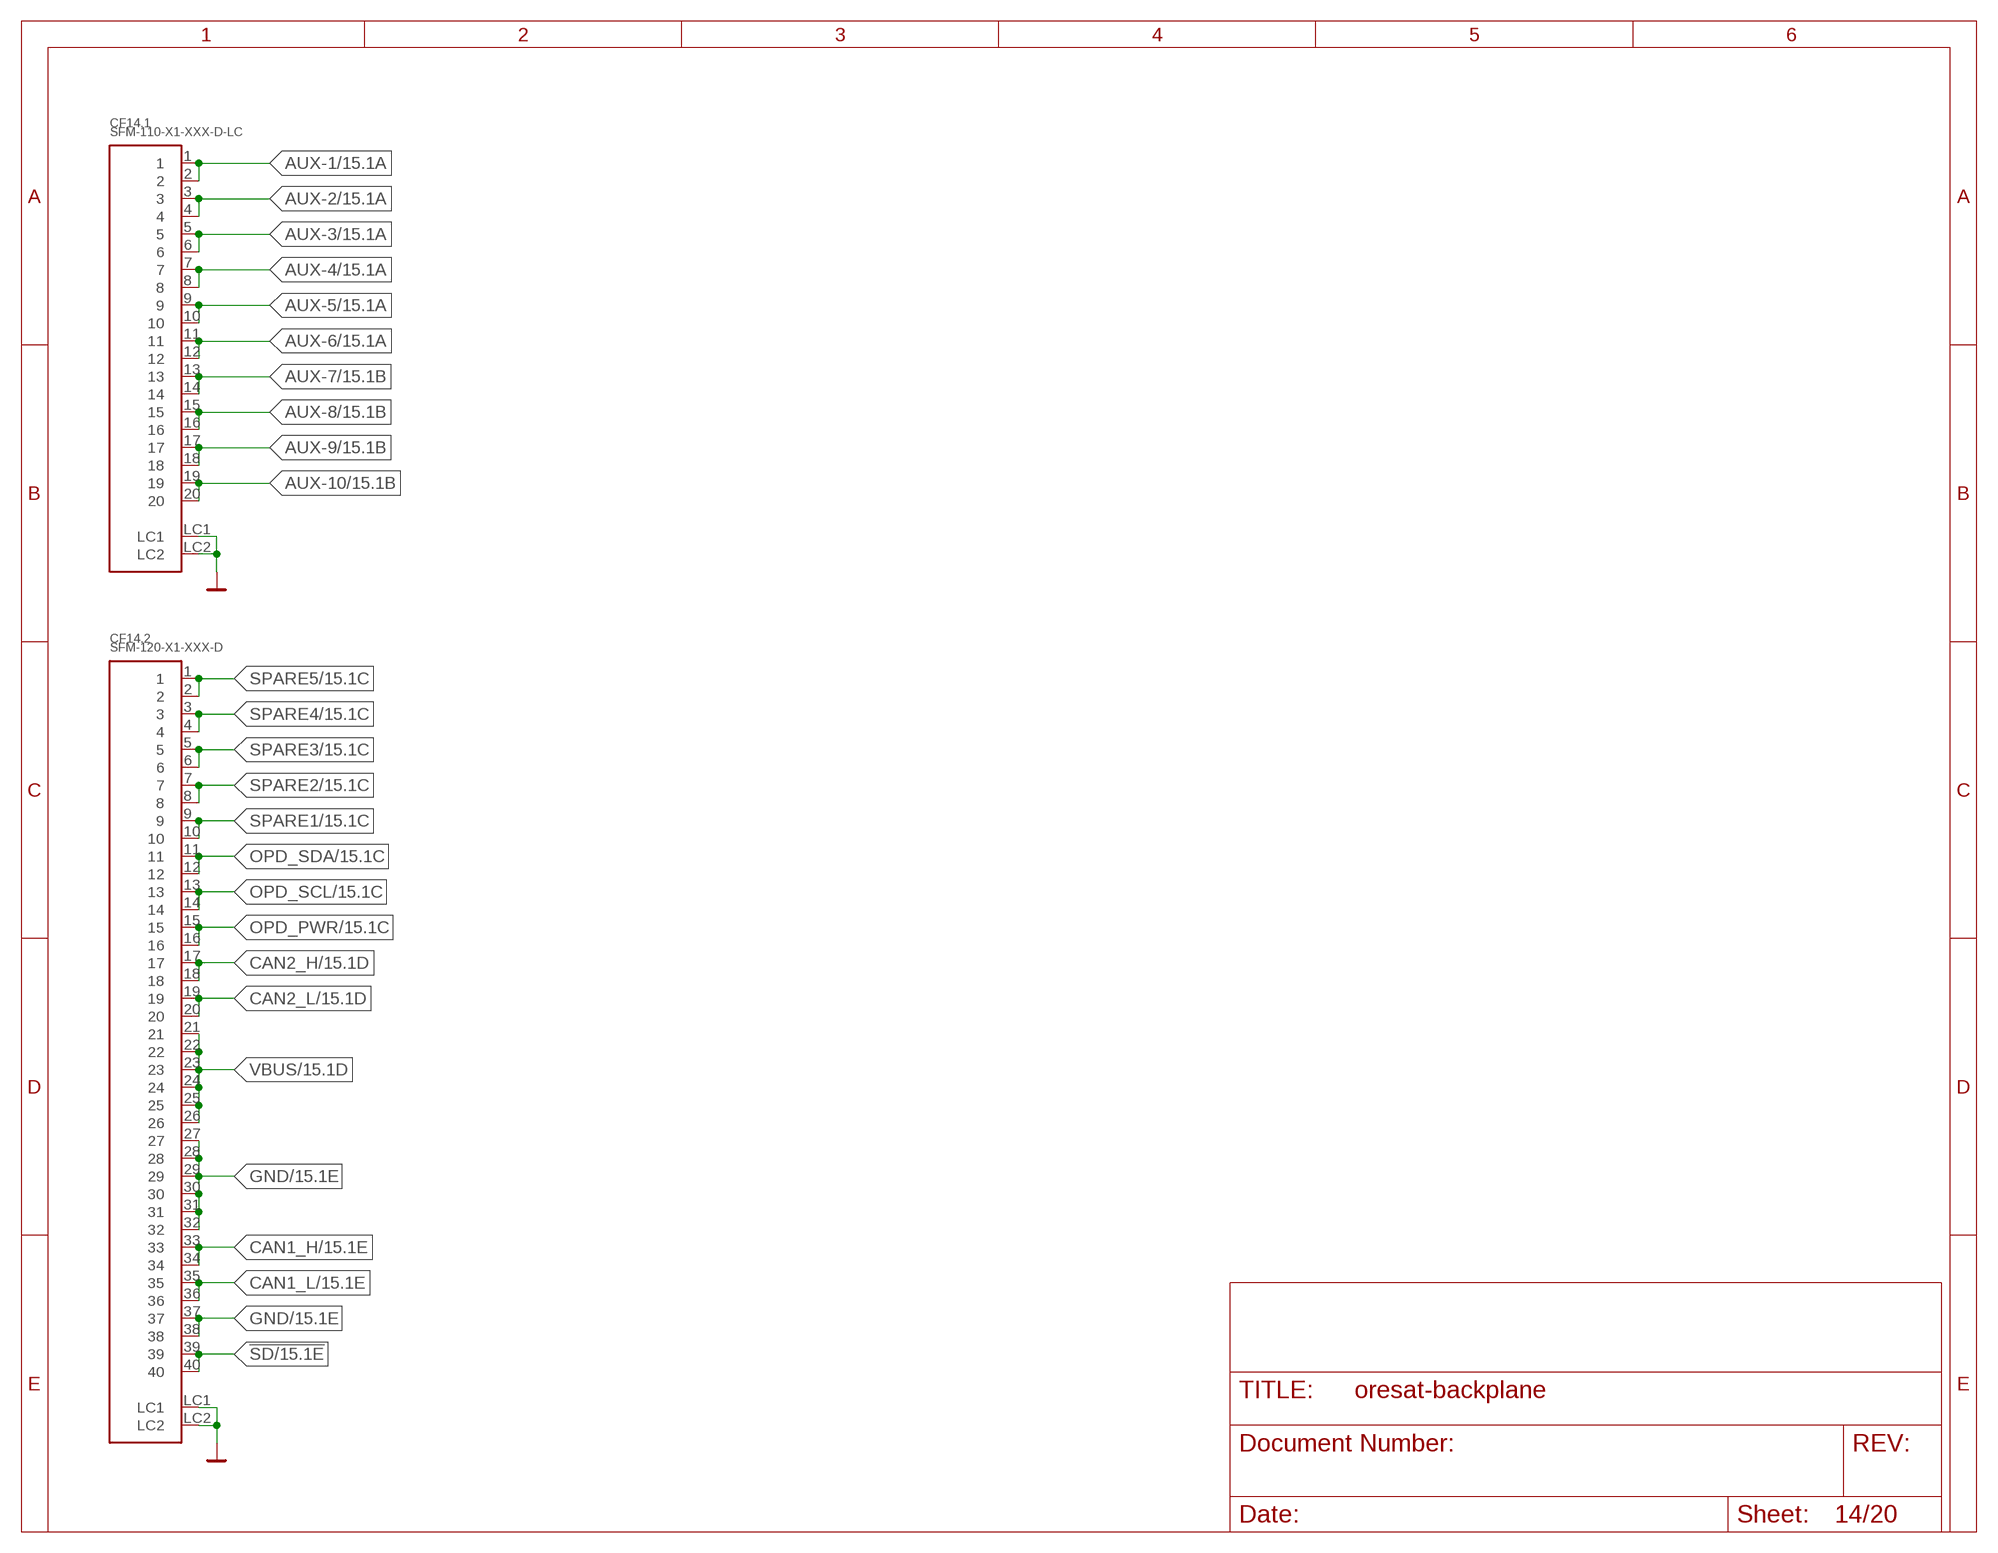
[diagram p13: schematic, sheet 14]

### Parts
CF14.1  SFM-110-X1-XXX-D-LC  [SFM-110-X1-XXX-D-LC]
CF14.2  SFM-120-X1-XXX-D  [SFM-120-X1-XXX-D]

### Nets
!SD: CF14.2.39 CF14.2.40 ; also sheet 1,2,3,4,5,6,7,8,12,13,15,16,17,18,19,20
AUX-1: CF14.1.1 CF14.1.2 ; also sheet 2,3,4,5,6,7,8,12,13,15,16,17,18,19
AUX-2: CF14.1.3 CF14.1.4 ; also sheet 2,3,4,5,6,7,8,12,13,15,16,17,18,19
AUX-3: CF14.1.5 CF14.1.6 ; also sheet 2,3,4,5,6,7,8,12,13,15,16,17,18,19
AUX-4: CF14.1.7 CF14.1.8 ; also sheet 2,3,4,5,6,7,8,12,13,15,16,17,18,19
AUX-5: CF14.1.9 CF14.1.10 ; also sheet 2,3,4,5,6,7,8,12,13,15,16,17,18,19
AUX-6: CF14.1.11 CF14.1.12 ; also sheet 2,3,4,5,6,7,8,12,13,15,16,17,18,19
AUX-7: CF14.1.13 CF14.1.14 ; also sheet 2,3,4,5,6,7,8,12,13,15,16,17,18,19
AUX-8: CF14.1.15 CF14.1.16 ; also sheet 2,3,4,5,6,7,8,12,13,15,16,17,18,19
AUX-9: CF14.1.17 CF14.1.18 ; also sheet 2,3,4,5,6,7,8,12,13,15,16,17,18,19
AUX-10: CF14.1.19 CF14.1.20 ; also sheet 2,3,4,5,6,7,8,12,13,15,16,17,18,19
CAN1_H: CF14.2.33 CF14.2.34 ; also sheet 1,2,3,4,5,6,7,8,12,13,15,16,17,18,19,20
CAN1_L: CF14.2.35 CF14.2.36 ; also sheet 1,2,3,4,5,6,7,8,12,13,15,16,17,18,19,20
CAN2_H: CF14.2.17 CF14.2.18 ; also sheet 1,2,3,4,5,6,7,8,12,13,15,16,17,18,19,20
CAN2_L: CF14.2.19 CF14.2.20 ; also sheet 1,2,3,4,5,6,7,8,12,13,15,16,17,18,19,20
GND: CF14.1.LC1 CF14.1.LC2 CF14.2.27 CF14.2.28 CF14.2.29 CF14.2.30 CF14.2.31 CF14.2.32 CF14.2.37 CF14.2.38 CF14.2.LC1 CF14.2.LC2 ; also sheet 1,2,3,4,5,6,7,8,12,13,15,16,17,18,19,20
OPD_PWR: CF14.2.15 CF14.2.16 ; also sheet 1,2,3,4,5,6,7,8,12,13,15,16,17,18,19,20
OPD_SCL: CF14.2.13 CF14.2.14 ; also sheet 1,2,3,4,5,6,7,8,12,13,15,16,17,18,19,20
OPD_SDA: CF14.2.11 CF14.2.12 ; also sheet 1,2,3,4,5,6,7,8,12,13,15,16,17,18,19,20
SPARE1: CF14.2.9 CF14.2.10 ; also sheet 1,2,3,4,5,6,7,8,12,13,15,16,17,18,19,20
SPARE2: CF14.2.7 CF14.2.8 ; also sheet 1,2,3,4,5,6,7,8,12,13,15,16,17,18,19,20
SPARE3: CF14.2.5 CF14.2.6 ; also sheet 1,2,3,4,5,6,7,8,12,13,15,16,17,18,19,20
SPARE4: CF14.2.3 CF14.2.4 ; also sheet 1,2,3,4,5,6,7,8,12,13,15,16,17,18,19,20
SPARE5: CF14.2.1 CF14.2.2 ; also sheet 1,2,3,4,5,6,7,8,12,13,15,16,17,18,19,20
VBUS: CF14.2.21 CF14.2.22 CF14.2.23 CF14.2.24 CF14.2.25 CF14.2.26 ; also sheet 1,2,3,4,5,6,7,8,12,13,15,16,17,18,19,20

## Sheet 15 of 20: Slot 15
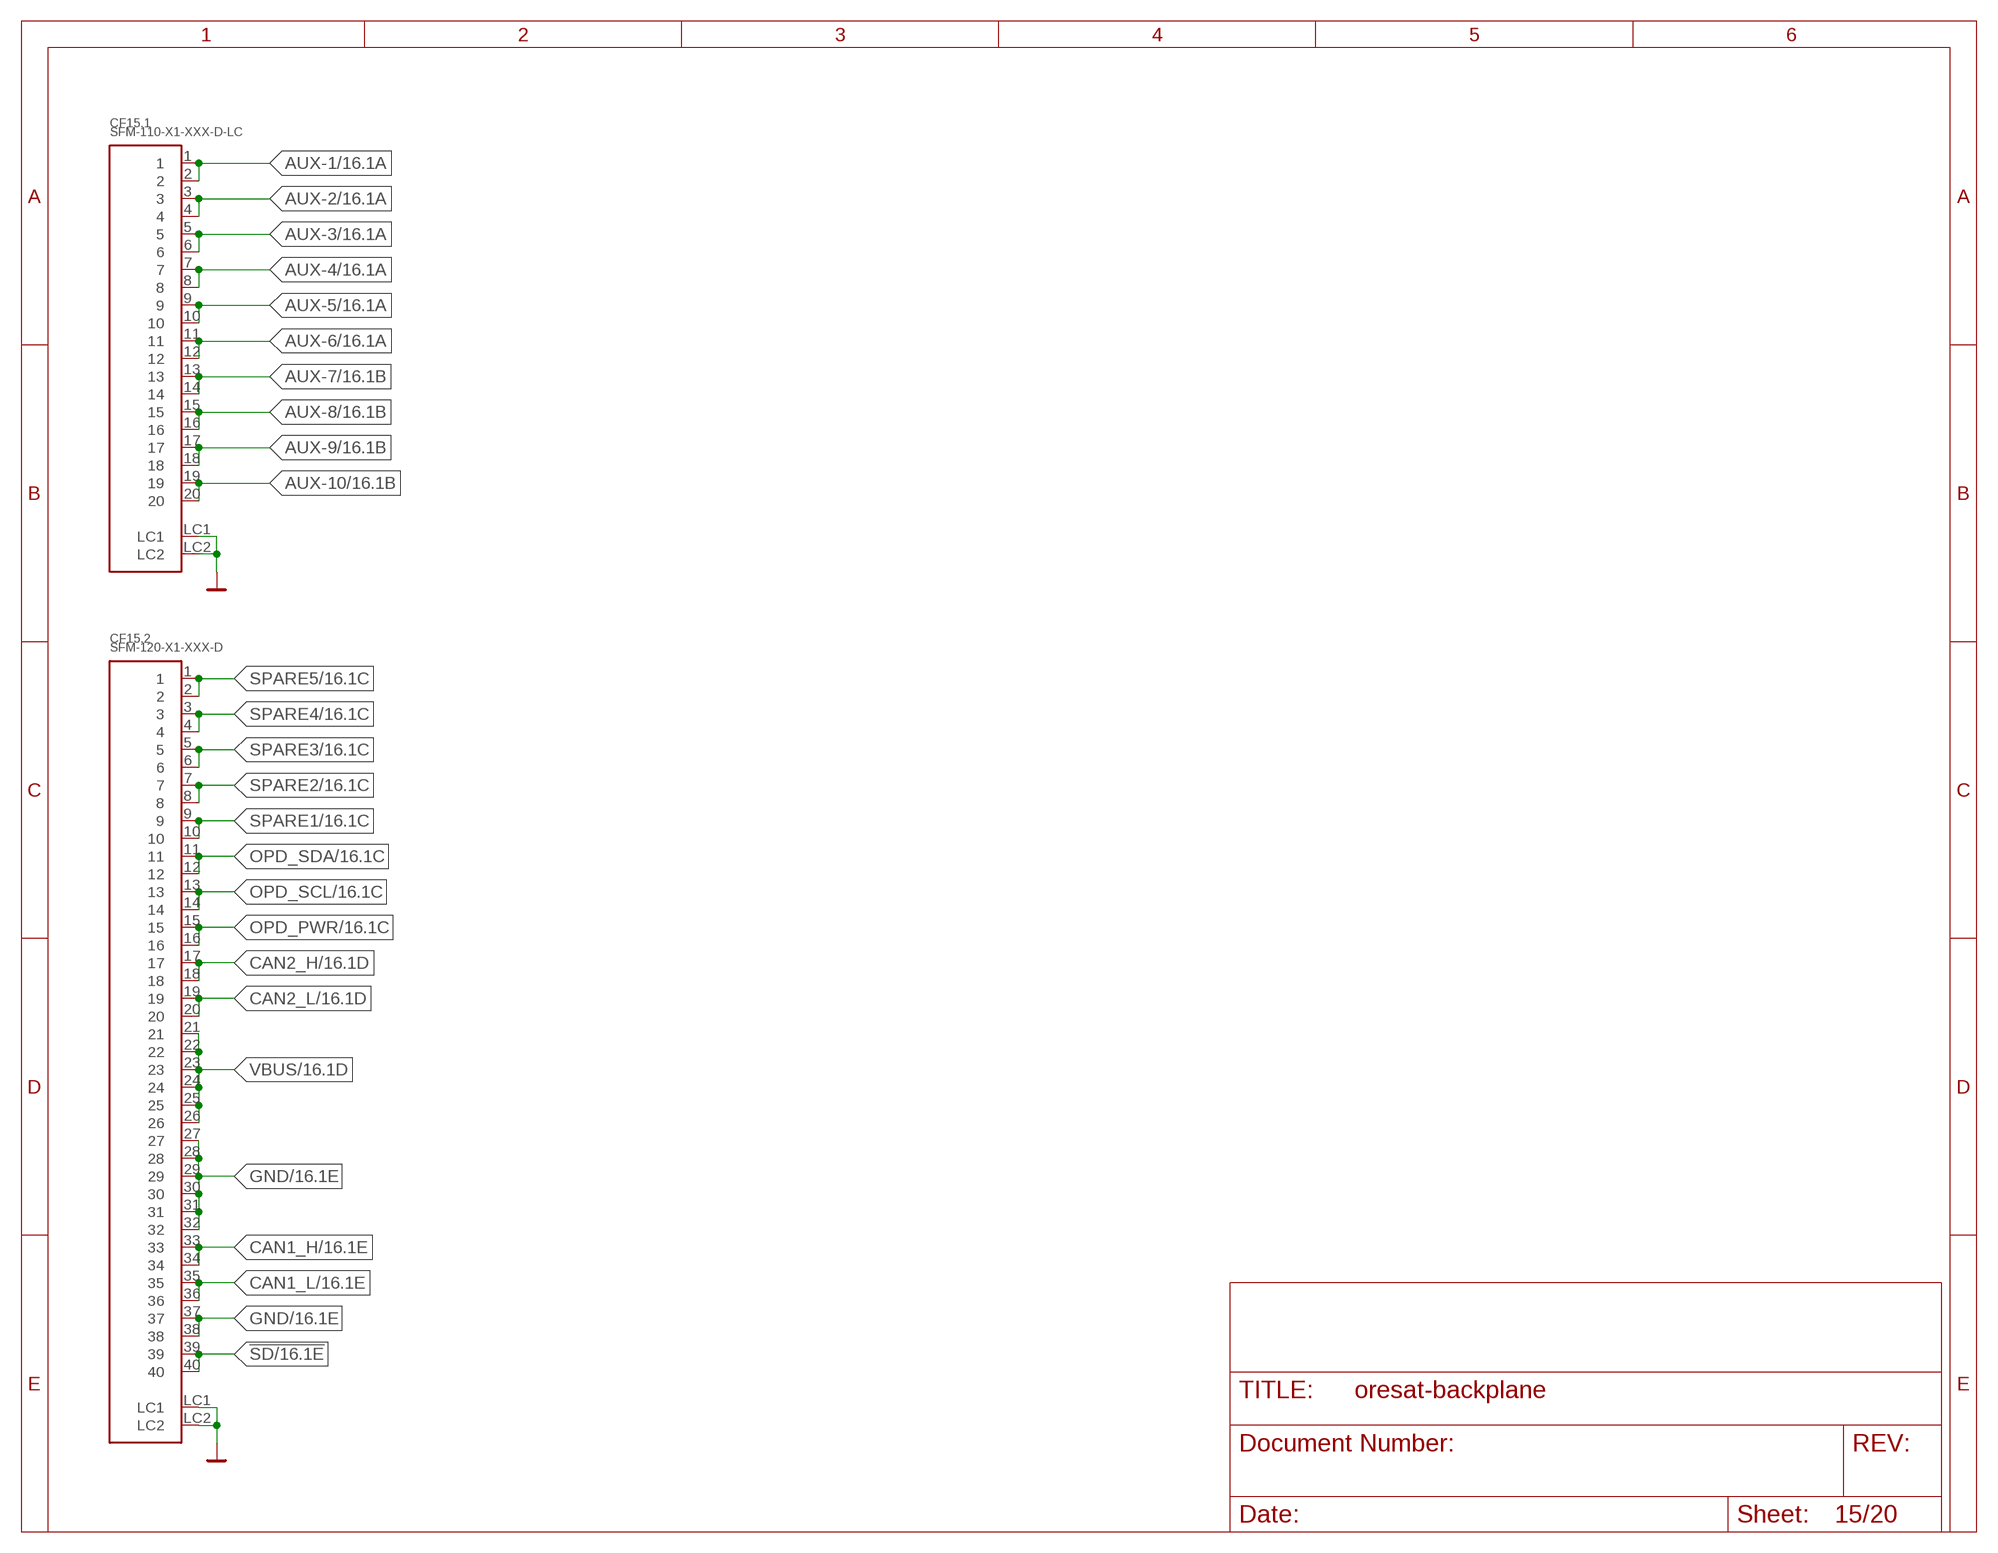
[diagram p14: schematic, sheet 15]

### Parts
CF15.1  SFM-110-X1-XXX-D-LC  [SFM-110-X1-XXX-D-LC]
CF15.2  SFM-120-X1-XXX-D  [SFM-120-X1-XXX-D]

### Nets
!SD: CF15.2.39 CF15.2.40 ; also sheet 1,2,3,4,5,6,7,8,12,13,14,16,17,18,19,20
AUX-1: CF15.1.1 CF15.1.2 ; also sheet 2,3,4,5,6,7,8,12,13,14,16,17,18,19
AUX-2: CF15.1.3 CF15.1.4 ; also sheet 2,3,4,5,6,7,8,12,13,14,16,17,18,19
AUX-3: CF15.1.5 CF15.1.6 ; also sheet 2,3,4,5,6,7,8,12,13,14,16,17,18,19
AUX-4: CF15.1.7 CF15.1.8 ; also sheet 2,3,4,5,6,7,8,12,13,14,16,17,18,19
AUX-5: CF15.1.9 CF15.1.10 ; also sheet 2,3,4,5,6,7,8,12,13,14,16,17,18,19
AUX-6: CF15.1.11 CF15.1.12 ; also sheet 2,3,4,5,6,7,8,12,13,14,16,17,18,19
AUX-7: CF15.1.13 CF15.1.14 ; also sheet 2,3,4,5,6,7,8,12,13,14,16,17,18,19
AUX-8: CF15.1.15 CF15.1.16 ; also sheet 2,3,4,5,6,7,8,12,13,14,16,17,18,19
AUX-9: CF15.1.17 CF15.1.18 ; also sheet 2,3,4,5,6,7,8,12,13,14,16,17,18,19
AUX-10: CF15.1.19 CF15.1.20 ; also sheet 2,3,4,5,6,7,8,12,13,14,16,17,18,19
CAN1_H: CF15.2.33 CF15.2.34 ; also sheet 1,2,3,4,5,6,7,8,12,13,14,16,17,18,19,20
CAN1_L: CF15.2.35 CF15.2.36 ; also sheet 1,2,3,4,5,6,7,8,12,13,14,16,17,18,19,20
CAN2_H: CF15.2.17 CF15.2.18 ; also sheet 1,2,3,4,5,6,7,8,12,13,14,16,17,18,19,20
CAN2_L: CF15.2.19 CF15.2.20 ; also sheet 1,2,3,4,5,6,7,8,12,13,14,16,17,18,19,20
GND: CF15.1.LC1 CF15.1.LC2 CF15.2.27 CF15.2.28 CF15.2.29 CF15.2.30 CF15.2.31 CF15.2.32 CF15.2.37 CF15.2.38 CF15.2.LC1 CF15.2.LC2 ; also sheet 1,2,3,4,5,6,7,8,12,13,14,16,17,18,19,20
OPD_PWR: CF15.2.15 CF15.2.16 ; also sheet 1,2,3,4,5,6,7,8,12,13,14,16,17,18,19,20
OPD_SCL: CF15.2.13 CF15.2.14 ; also sheet 1,2,3,4,5,6,7,8,12,13,14,16,17,18,19,20
OPD_SDA: CF15.2.11 CF15.2.12 ; also sheet 1,2,3,4,5,6,7,8,12,13,14,16,17,18,19,20
SPARE1: CF15.2.9 CF15.2.10 ; also sheet 1,2,3,4,5,6,7,8,12,13,14,16,17,18,19,20
SPARE2: CF15.2.7 CF15.2.8 ; also sheet 1,2,3,4,5,6,7,8,12,13,14,16,17,18,19,20
SPARE3: CF15.2.5 CF15.2.6 ; also sheet 1,2,3,4,5,6,7,8,12,13,14,16,17,18,19,20
SPARE4: CF15.2.3 CF15.2.4 ; also sheet 1,2,3,4,5,6,7,8,12,13,14,16,17,18,19,20
SPARE5: CF15.2.1 CF15.2.2 ; also sheet 1,2,3,4,5,6,7,8,12,13,14,16,17,18,19,20
VBUS: CF15.2.21 CF15.2.22 CF15.2.23 CF15.2.24 CF15.2.25 CF15.2.26 ; also sheet 1,2,3,4,5,6,7,8,12,13,14,16,17,18,19,20

## Sheet 16 of 20: Slot 16
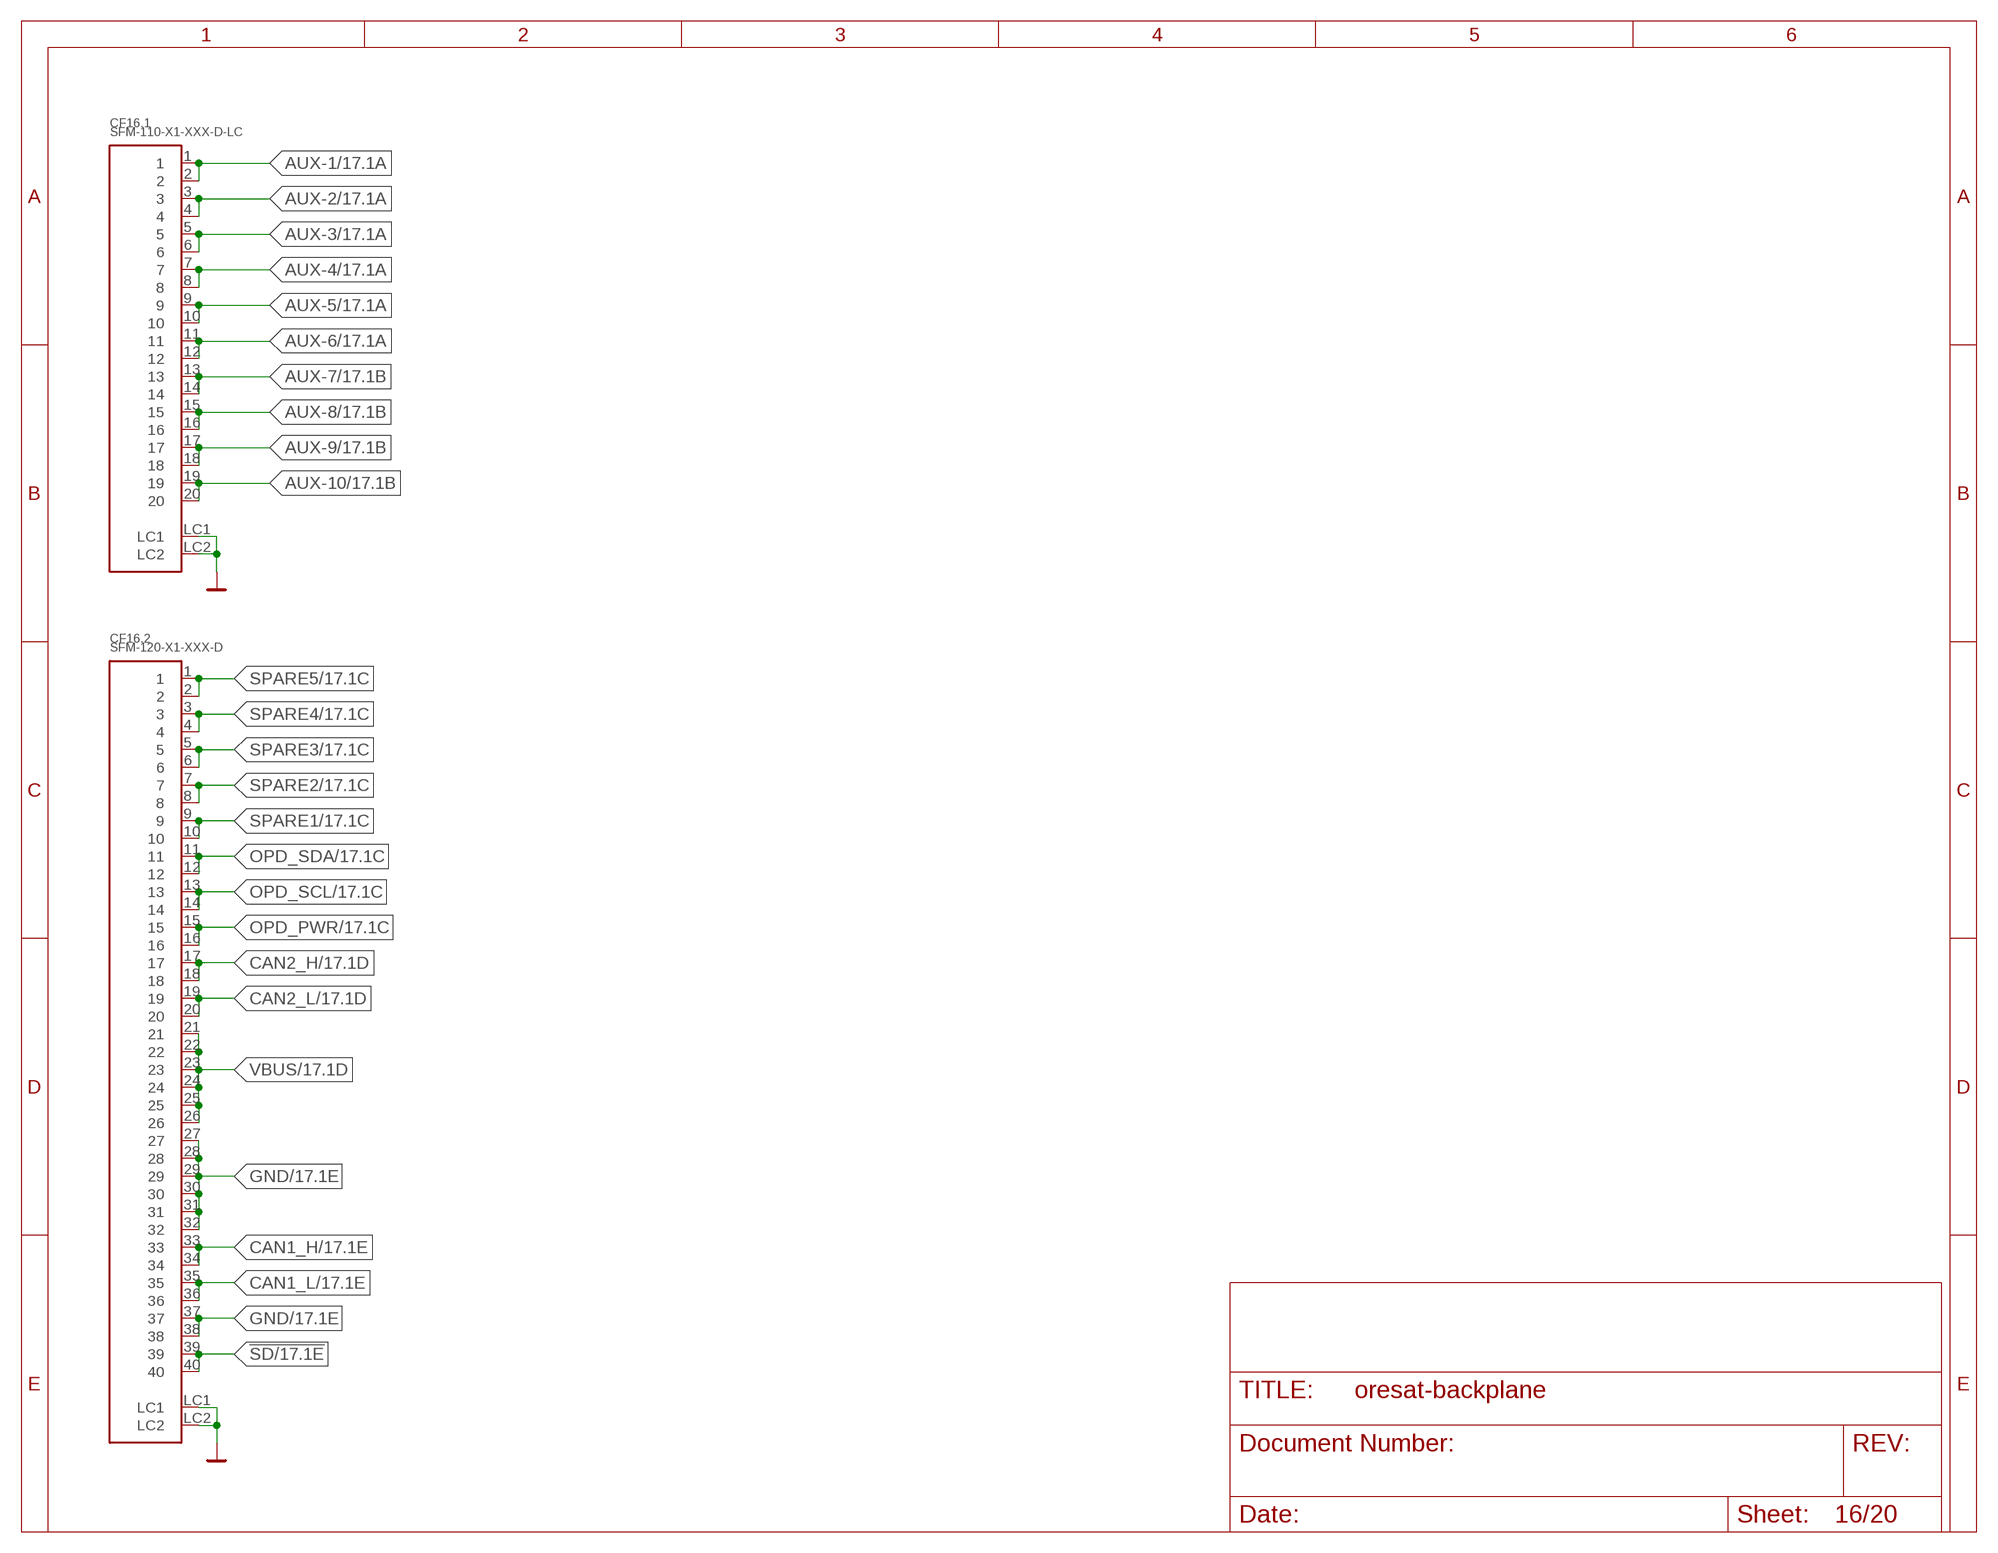
[diagram p15: schematic, sheet 16]

### Parts
CF16.1  SFM-110-X1-XXX-D-LC  [SFM-110-X1-XXX-D-LC]
CF16.2  SFM-120-X1-XXX-D  [SFM-120-X1-XXX-D]

### Nets
!SD: CF16.2.39 CF16.2.40 ; also sheet 1,2,3,4,5,6,7,8,12,13,14,15,17,18,19,20
AUX-1: CF16.1.1 CF16.1.2 ; also sheet 2,3,4,5,6,7,8,12,13,14,15,17,18,19
AUX-2: CF16.1.3 CF16.1.4 ; also sheet 2,3,4,5,6,7,8,12,13,14,15,17,18,19
AUX-3: CF16.1.5 CF16.1.6 ; also sheet 2,3,4,5,6,7,8,12,13,14,15,17,18,19
AUX-4: CF16.1.7 CF16.1.8 ; also sheet 2,3,4,5,6,7,8,12,13,14,15,17,18,19
AUX-5: CF16.1.9 CF16.1.10 ; also sheet 2,3,4,5,6,7,8,12,13,14,15,17,18,19
AUX-6: CF16.1.11 CF16.1.12 ; also sheet 2,3,4,5,6,7,8,12,13,14,15,17,18,19
AUX-7: CF16.1.13 CF16.1.14 ; also sheet 2,3,4,5,6,7,8,12,13,14,15,17,18,19
AUX-8: CF16.1.15 CF16.1.16 ; also sheet 2,3,4,5,6,7,8,12,13,14,15,17,18,19
AUX-9: CF16.1.17 CF16.1.18 ; also sheet 2,3,4,5,6,7,8,12,13,14,15,17,18,19
AUX-10: CF16.1.19 CF16.1.20 ; also sheet 2,3,4,5,6,7,8,12,13,14,15,17,18,19
CAN1_H: CF16.2.33 CF16.2.34 ; also sheet 1,2,3,4,5,6,7,8,12,13,14,15,17,18,19,20
CAN1_L: CF16.2.35 CF16.2.36 ; also sheet 1,2,3,4,5,6,7,8,12,13,14,15,17,18,19,20
CAN2_H: CF16.2.17 CF16.2.18 ; also sheet 1,2,3,4,5,6,7,8,12,13,14,15,17,18,19,20
CAN2_L: CF16.2.19 CF16.2.20 ; also sheet 1,2,3,4,5,6,7,8,12,13,14,15,17,18,19,20
GND: CF16.1.LC1 CF16.1.LC2 CF16.2.27 CF16.2.28 CF16.2.29 CF16.2.30 CF16.2.31 CF16.2.32 CF16.2.37 CF16.2.38 CF16.2.LC1 CF16.2.LC2 ; also sheet 1,2,3,4,5,6,7,8,12,13,14,15,17,18,19,20
OPD_PWR: CF16.2.15 CF16.2.16 ; also sheet 1,2,3,4,5,6,7,8,12,13,14,15,17,18,19,20
OPD_SCL: CF16.2.13 CF16.2.14 ; also sheet 1,2,3,4,5,6,7,8,12,13,14,15,17,18,19,20
OPD_SDA: CF16.2.11 CF16.2.12 ; also sheet 1,2,3,4,5,6,7,8,12,13,14,15,17,18,19,20
SPARE1: CF16.2.9 CF16.2.10 ; also sheet 1,2,3,4,5,6,7,8,12,13,14,15,17,18,19,20
SPARE2: CF16.2.7 CF16.2.8 ; also sheet 1,2,3,4,5,6,7,8,12,13,14,15,17,18,19,20
SPARE3: CF16.2.5 CF16.2.6 ; also sheet 1,2,3,4,5,6,7,8,12,13,14,15,17,18,19,20
SPARE4: CF16.2.3 CF16.2.4 ; also sheet 1,2,3,4,5,6,7,8,12,13,14,15,17,18,19,20
SPARE5: CF16.2.1 CF16.2.2 ; also sheet 1,2,3,4,5,6,7,8,12,13,14,15,17,18,19,20
VBUS: CF16.2.21 CF16.2.22 CF16.2.23 CF16.2.24 CF16.2.25 CF16.2.26 ; also sheet 1,2,3,4,5,6,7,8,12,13,14,15,17,18,19,20

## Sheet 17 of 20: Slot 17
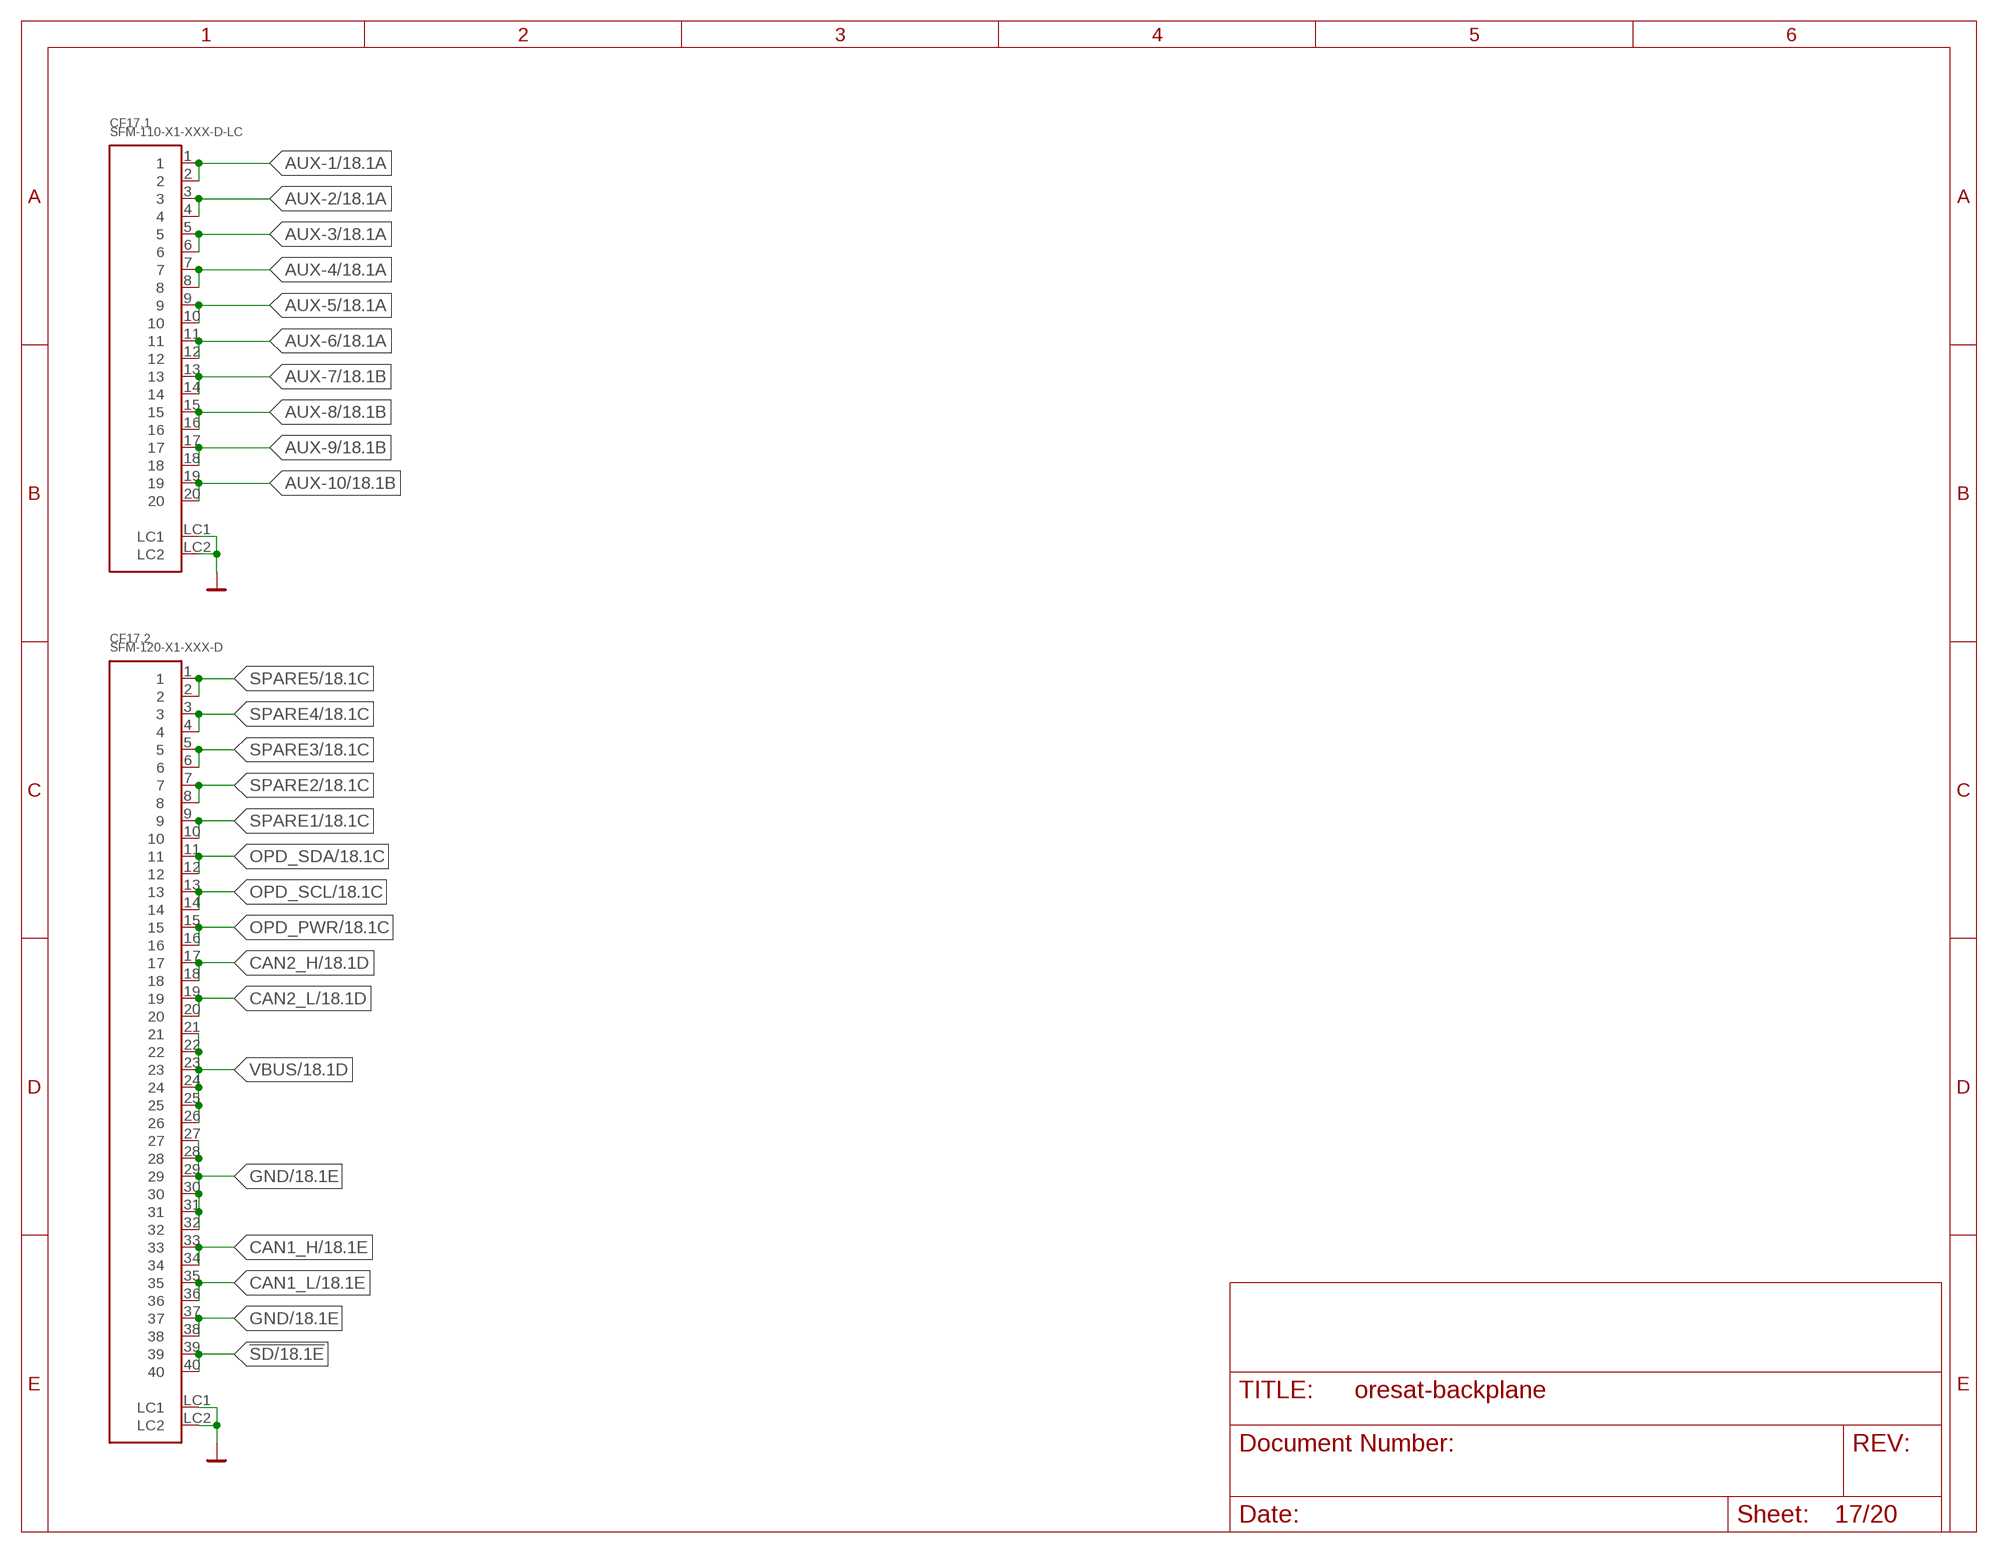
[diagram p16: schematic, sheet 17]

### Parts
CF17.1  SFM-110-X1-XXX-D-LC  [SFM-110-X1-XXX-D-LC]
CF17.2  SFM-120-X1-XXX-D  [SFM-120-X1-XXX-D]

### Nets
!SD: CF17.2.39 CF17.2.40 ; also sheet 1,2,3,4,5,6,7,8,12,13,14,15,16,18,19,20
AUX-1: CF17.1.1 CF17.1.2 ; also sheet 2,3,4,5,6,7,8,12,13,14,15,16,18,19
AUX-2: CF17.1.3 CF17.1.4 ; also sheet 2,3,4,5,6,7,8,12,13,14,15,16,18,19
AUX-3: CF17.1.5 CF17.1.6 ; also sheet 2,3,4,5,6,7,8,12,13,14,15,16,18,19
AUX-4: CF17.1.7 CF17.1.8 ; also sheet 2,3,4,5,6,7,8,12,13,14,15,16,18,19
AUX-5: CF17.1.9 CF17.1.10 ; also sheet 2,3,4,5,6,7,8,12,13,14,15,16,18,19
AUX-6: CF17.1.11 CF17.1.12 ; also sheet 2,3,4,5,6,7,8,12,13,14,15,16,18,19
AUX-7: CF17.1.13 CF17.1.14 ; also sheet 2,3,4,5,6,7,8,12,13,14,15,16,18,19
AUX-8: CF17.1.15 CF17.1.16 ; also sheet 2,3,4,5,6,7,8,12,13,14,15,16,18,19
AUX-9: CF17.1.17 CF17.1.18 ; also sheet 2,3,4,5,6,7,8,12,13,14,15,16,18,19
AUX-10: CF17.1.19 CF17.1.20 ; also sheet 2,3,4,5,6,7,8,12,13,14,15,16,18,19
CAN1_H: CF17.2.33 CF17.2.34 ; also sheet 1,2,3,4,5,6,7,8,12,13,14,15,16,18,19,20
CAN1_L: CF17.2.35 CF17.2.36 ; also sheet 1,2,3,4,5,6,7,8,12,13,14,15,16,18,19,20
CAN2_H: CF17.2.17 CF17.2.18 ; also sheet 1,2,3,4,5,6,7,8,12,13,14,15,16,18,19,20
CAN2_L: CF17.2.19 CF17.2.20 ; also sheet 1,2,3,4,5,6,7,8,12,13,14,15,16,18,19,20
GND: CF17.1.LC1 CF17.1.LC2 CF17.2.27 CF17.2.28 CF17.2.29 CF17.2.30 CF17.2.31 CF17.2.32 CF17.2.37 CF17.2.38 CF17.2.LC1 CF17.2.LC2 ; also sheet 1,2,3,4,5,6,7,8,12,13,14,15,16,18,19,20
OPD_PWR: CF17.2.15 CF17.2.16 ; also sheet 1,2,3,4,5,6,7,8,12,13,14,15,16,18,19,20
OPD_SCL: CF17.2.13 CF17.2.14 ; also sheet 1,2,3,4,5,6,7,8,12,13,14,15,16,18,19,20
OPD_SDA: CF17.2.11 CF17.2.12 ; also sheet 1,2,3,4,5,6,7,8,12,13,14,15,16,18,19,20
SPARE1: CF17.2.9 CF17.2.10 ; also sheet 1,2,3,4,5,6,7,8,12,13,14,15,16,18,19,20
SPARE2: CF17.2.7 CF17.2.8 ; also sheet 1,2,3,4,5,6,7,8,12,13,14,15,16,18,19,20
SPARE3: CF17.2.5 CF17.2.6 ; also sheet 1,2,3,4,5,6,7,8,12,13,14,15,16,18,19,20
SPARE4: CF17.2.3 CF17.2.4 ; also sheet 1,2,3,4,5,6,7,8,12,13,14,15,16,18,19,20
SPARE5: CF17.2.1 CF17.2.2 ; also sheet 1,2,3,4,5,6,7,8,12,13,14,15,16,18,19,20
VBUS: CF17.2.21 CF17.2.22 CF17.2.23 CF17.2.24 CF17.2.25 CF17.2.26 ; also sheet 1,2,3,4,5,6,7,8,12,13,14,15,16,18,19,20

## Sheet 18 of 20: Slot 18
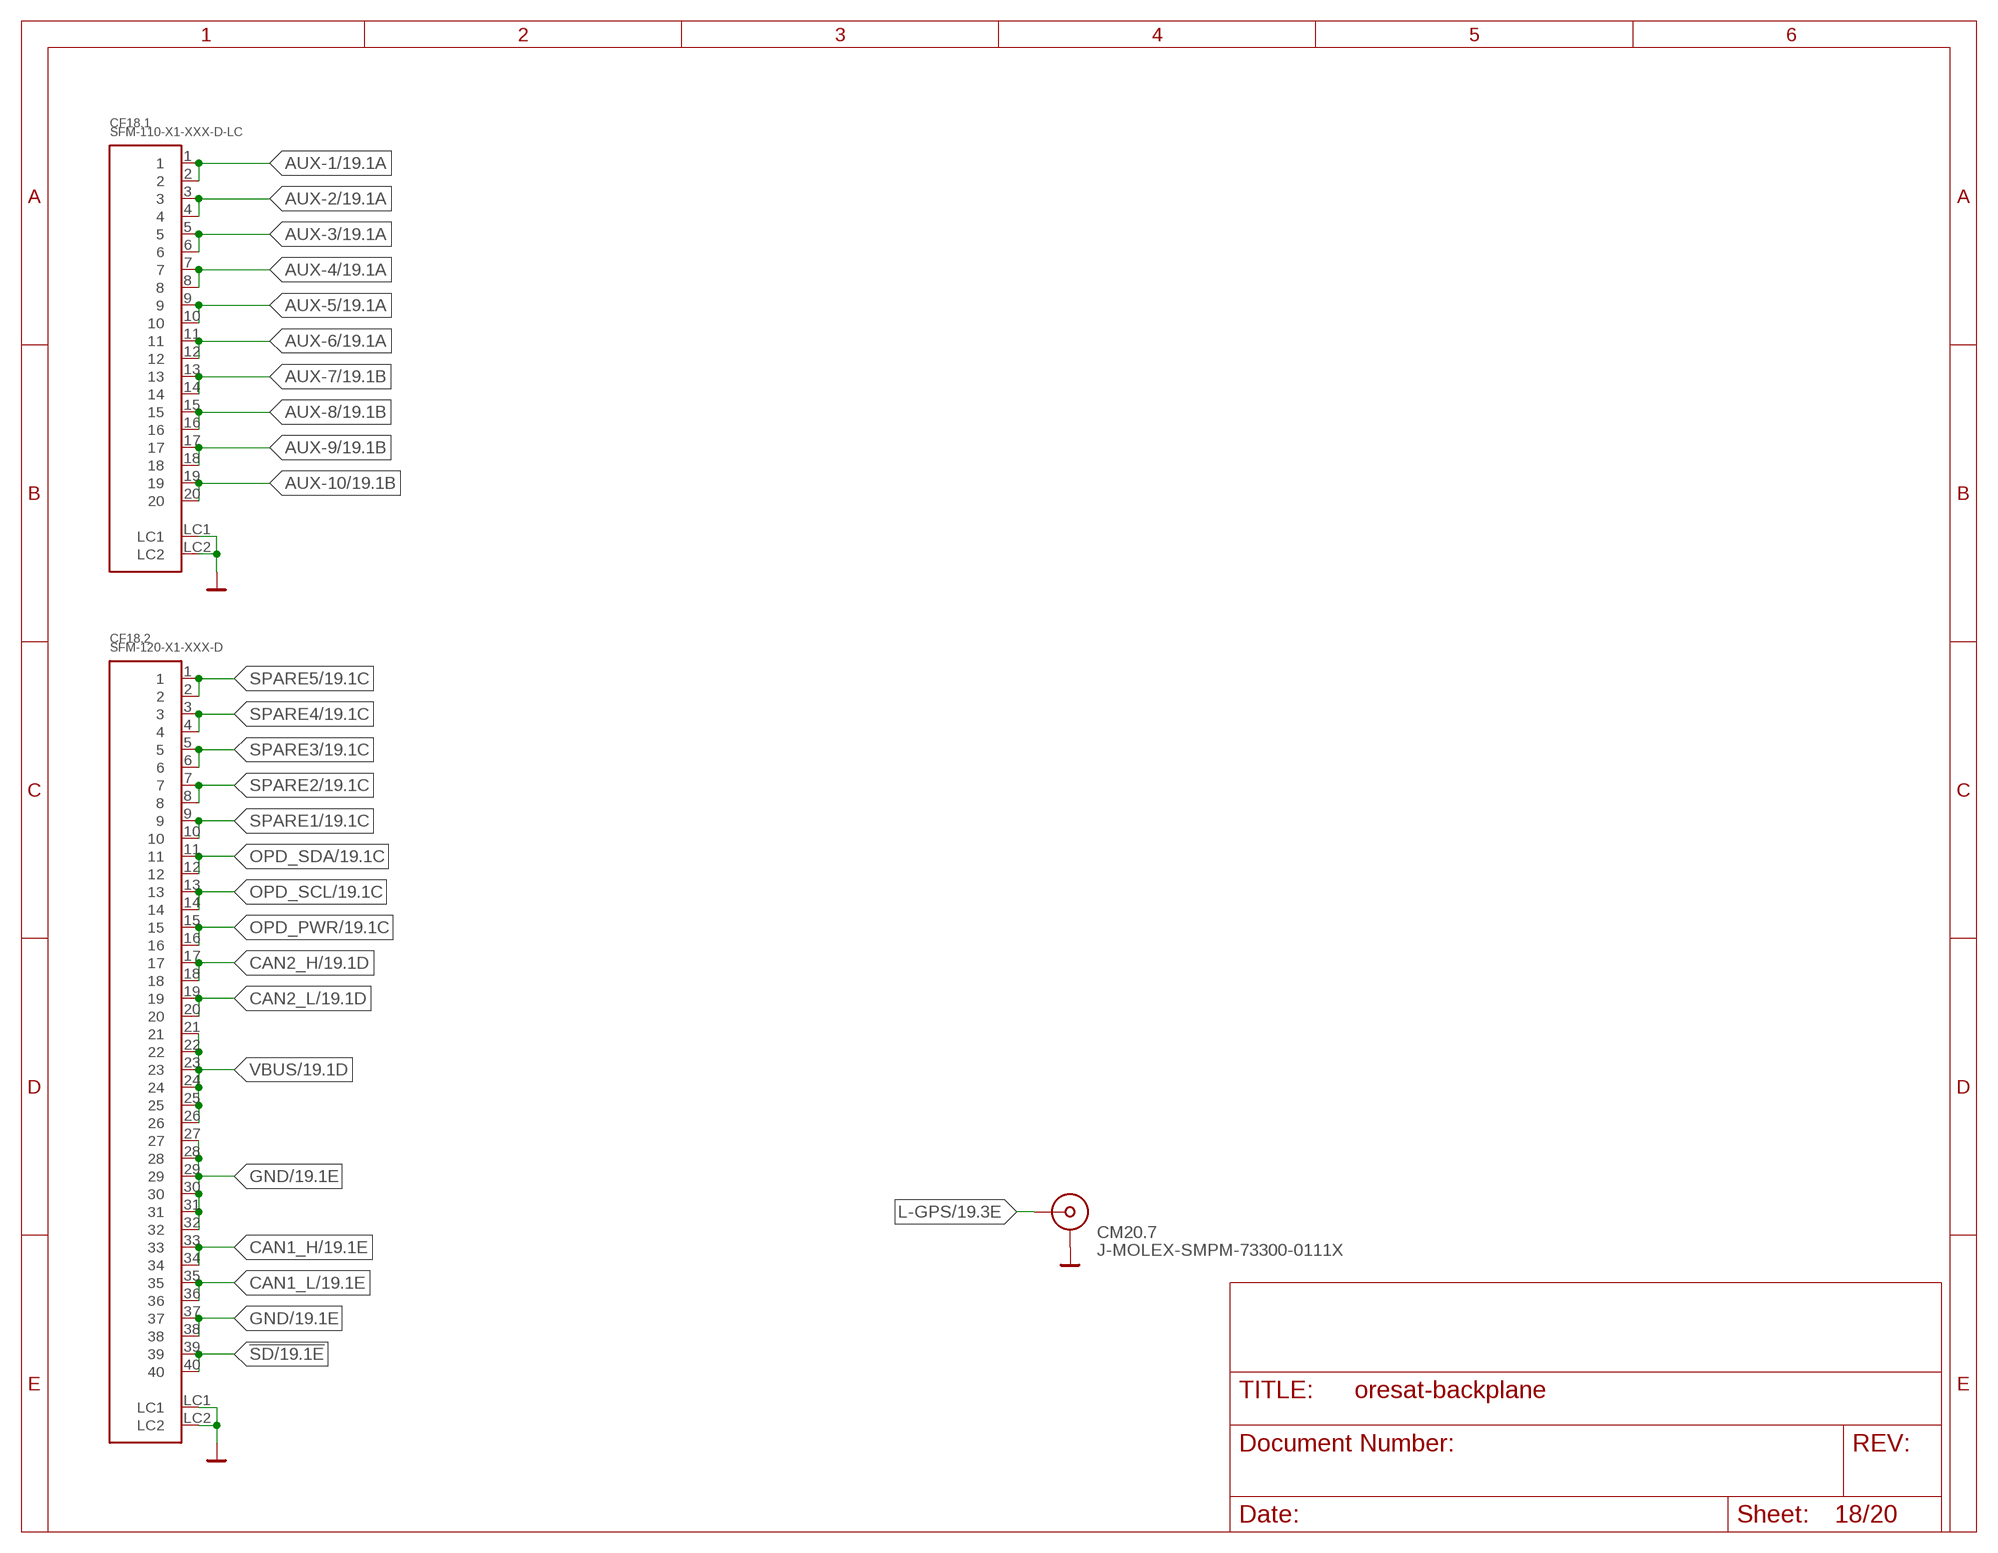
[diagram p17: schematic, sheet 18]

### Parts
CF18.1  SFM-110-X1-XXX-D-LC  [SFM-110-X1-XXX-D-LC]
CF18.2  SFM-120-X1-XXX-D  [SFM-120-X1-XXX-D]
CM20.7  J-MOLEX-SMPM-73300-0111X  [J-MOLEX-SMPM-73300-0111X]

### Nets
!SD: CF18.2.39 CF18.2.40 ; also sheet 1,2,3,4,5,6,7,8,12,13,14,15,16,17,19,20
AUX-1: CF18.1.1 CF18.1.2 ; also sheet 2,3,4,5,6,7,8,12,13,14,15,16,17,19
AUX-2: CF18.1.3 CF18.1.4 ; also sheet 2,3,4,5,6,7,8,12,13,14,15,16,17,19
AUX-3: CF18.1.5 CF18.1.6 ; also sheet 2,3,4,5,6,7,8,12,13,14,15,16,17,19
AUX-4: CF18.1.7 CF18.1.8 ; also sheet 2,3,4,5,6,7,8,12,13,14,15,16,17,19
AUX-5: CF18.1.9 CF18.1.10 ; also sheet 2,3,4,5,6,7,8,12,13,14,15,16,17,19
AUX-6: CF18.1.11 CF18.1.12 ; also sheet 2,3,4,5,6,7,8,12,13,14,15,16,17,19
AUX-7: CF18.1.13 CF18.1.14 ; also sheet 2,3,4,5,6,7,8,12,13,14,15,16,17,19
AUX-8: CF18.1.15 CF18.1.16 ; also sheet 2,3,4,5,6,7,8,12,13,14,15,16,17,19
AUX-9: CF18.1.17 CF18.1.18 ; also sheet 2,3,4,5,6,7,8,12,13,14,15,16,17,19
AUX-10: CF18.1.19 CF18.1.20 ; also sheet 2,3,4,5,6,7,8,12,13,14,15,16,17,19
CAN1_H: CF18.2.33 CF18.2.34 ; also sheet 1,2,3,4,5,6,7,8,12,13,14,15,16,17,19,20
CAN1_L: CF18.2.35 CF18.2.36 ; also sheet 1,2,3,4,5,6,7,8,12,13,14,15,16,17,19,20
CAN2_H: CF18.2.17 CF18.2.18 ; also sheet 1,2,3,4,5,6,7,8,12,13,14,15,16,17,19,20
CAN2_L: CF18.2.19 CF18.2.20 ; also sheet 1,2,3,4,5,6,7,8,12,13,14,15,16,17,19,20
GND: CF18.1.LC1 CF18.1.LC2 CF18.2.27 CF18.2.28 CF18.2.29 CF18.2.30 CF18.2.31 CF18.2.32 CF18.2.37 CF18.2.38 CF18.2.LC1 CF18.2.LC2 CM20.7.P$1(SHIELD1) CM20.7.P$2(SHIELD1) CM20.7.P$3(SHIELD1) CM20.7.P$4(SHIELD1) ; also sheet 1,2,3,4,5,6,7,8,12,13,14,15,16,17,19,20
L-GPS [RF]: CM20.7.RF-DOWN(RF) ; also sheet 19
OPD_PWR: CF18.2.15 CF18.2.16 ; also sheet 1,2,3,4,5,6,7,8,12,13,14,15,16,17,19,20
OPD_SCL: CF18.2.13 CF18.2.14 ; also sheet 1,2,3,4,5,6,7,8,12,13,14,15,16,17,19,20
OPD_SDA: CF18.2.11 CF18.2.12 ; also sheet 1,2,3,4,5,6,7,8,12,13,14,15,16,17,19,20
SPARE1: CF18.2.9 CF18.2.10 ; also sheet 1,2,3,4,5,6,7,8,12,13,14,15,16,17,19,20
SPARE2: CF18.2.7 CF18.2.8 ; also sheet 1,2,3,4,5,6,7,8,12,13,14,15,16,17,19,20
SPARE3: CF18.2.5 CF18.2.6 ; also sheet 1,2,3,4,5,6,7,8,12,13,14,15,16,17,19,20
SPARE4: CF18.2.3 CF18.2.4 ; also sheet 1,2,3,4,5,6,7,8,12,13,14,15,16,17,19,20
SPARE5: CF18.2.1 CF18.2.2 ; also sheet 1,2,3,4,5,6,7,8,12,13,14,15,16,17,19,20
VBUS: CF18.2.21 CF18.2.22 CF18.2.23 CF18.2.24 CF18.2.25 CF18.2.26 ; also sheet 1,2,3,4,5,6,7,8,12,13,14,15,16,17,19,20

## Sheet 19 of 20: Slot 19
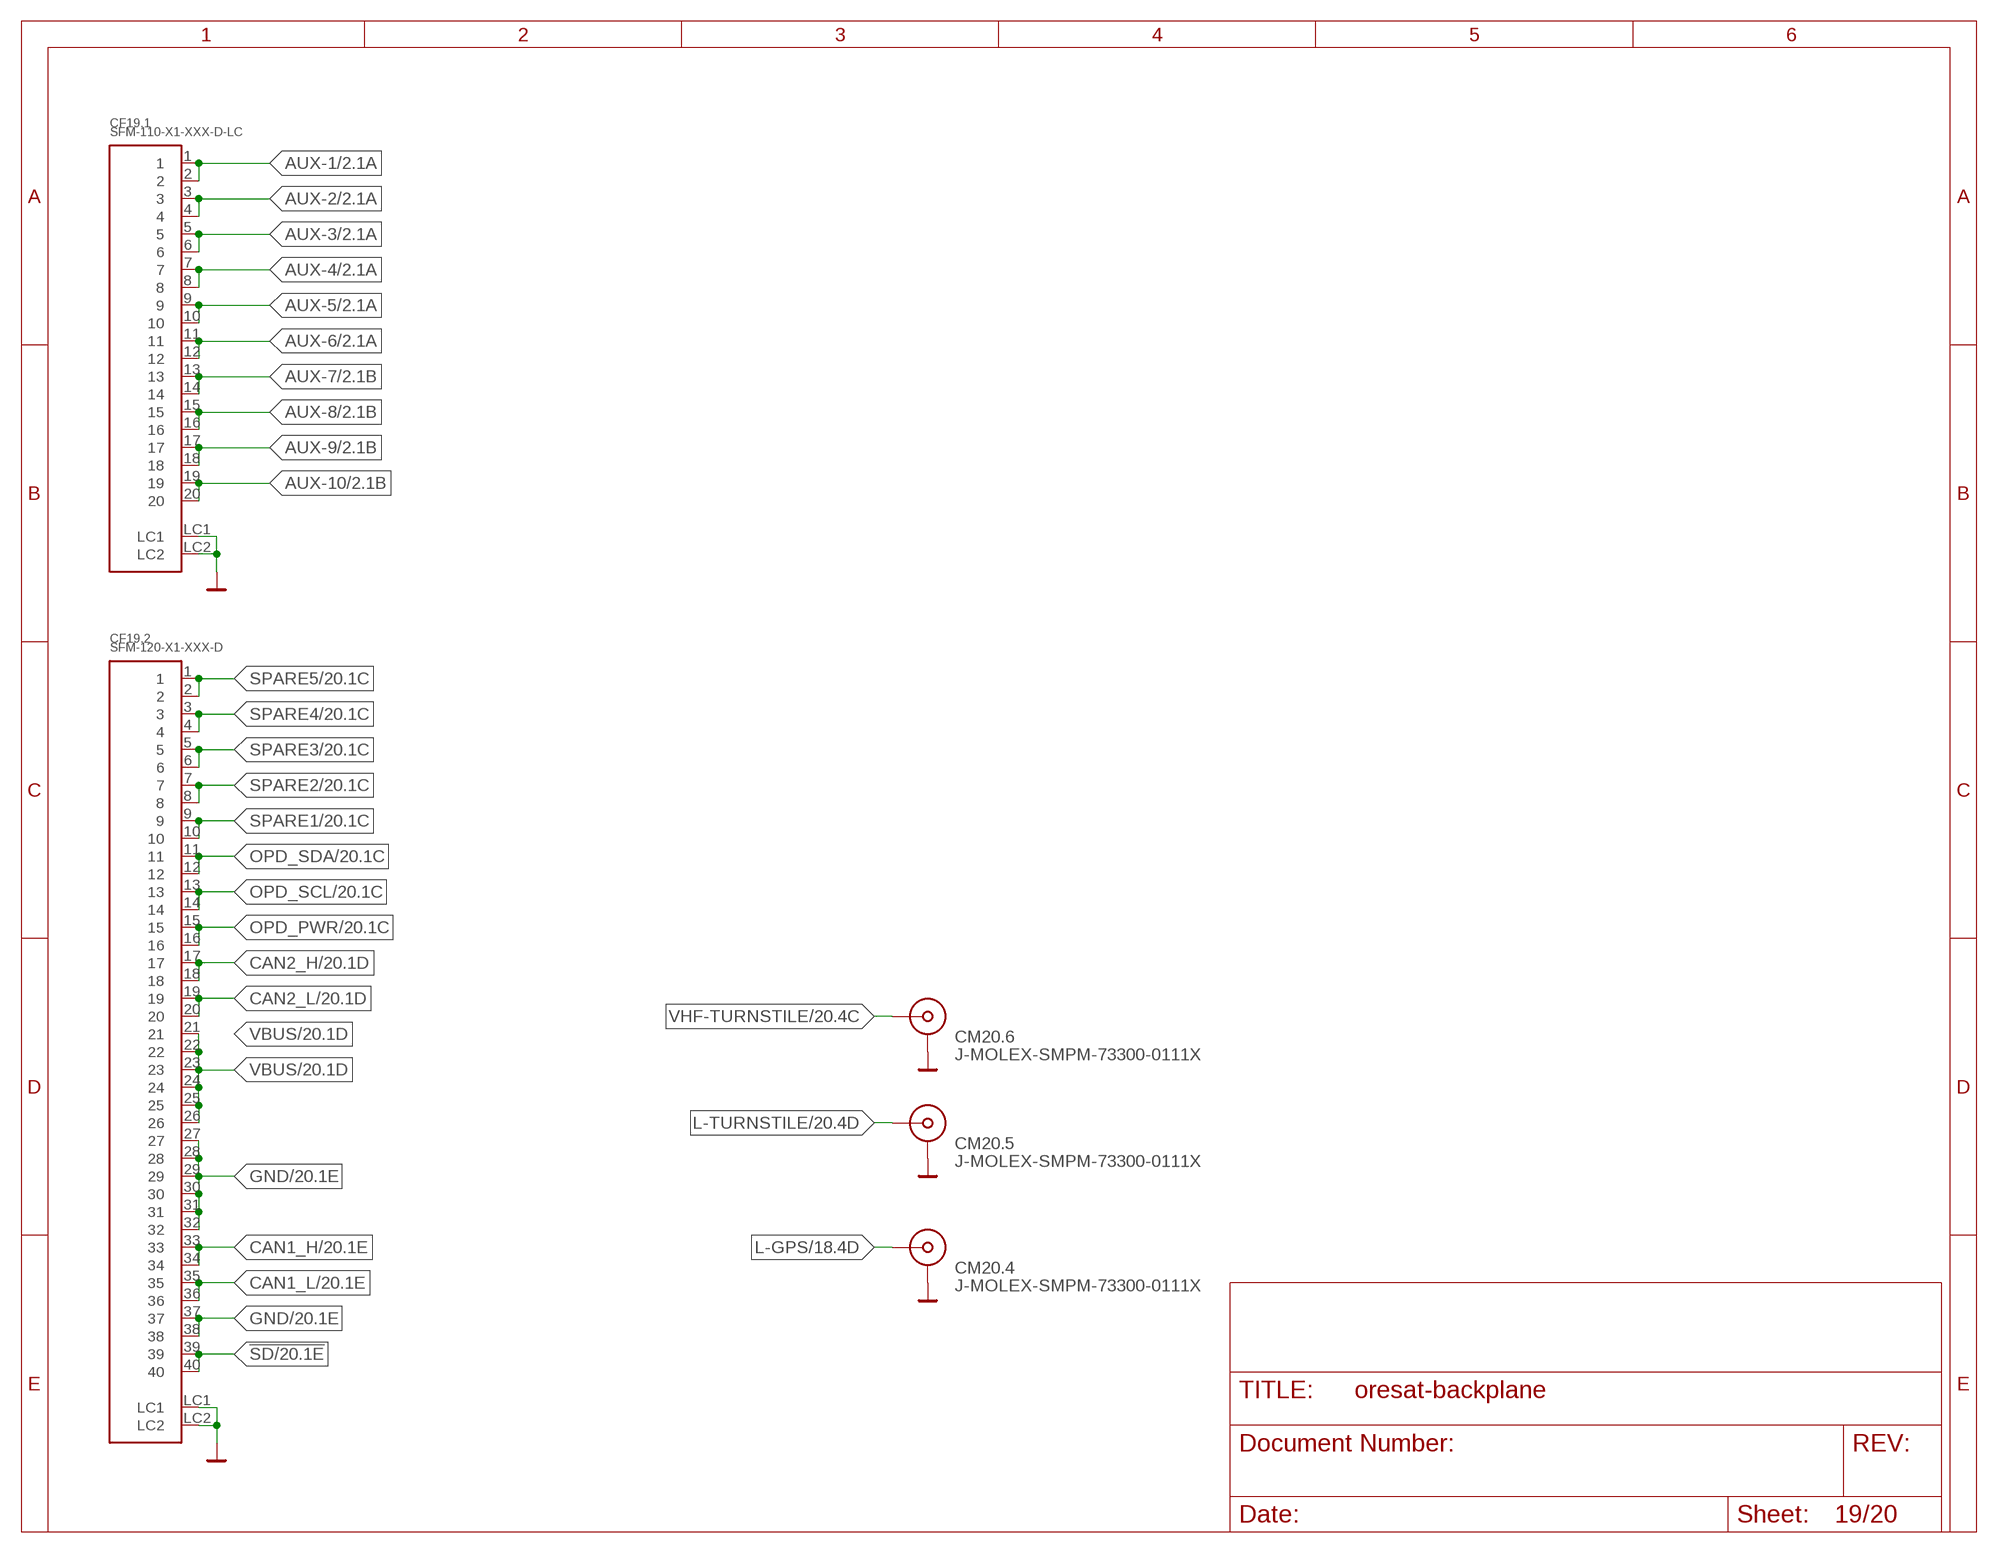
[diagram p18: schematic, sheet 19]

### Parts
CF19.1  SFM-110-X1-XXX-D-LC  [SFM-110-X1-XXX-D-LC]
CF19.2  SFM-120-X1-XXX-D  [SFM-120-X1-XXX-D]
CM20.4  J-MOLEX-SMPM-73300-0111X  [J-MOLEX-SMPM-73300-0111X]
CM20.5  J-MOLEX-SMPM-73300-0111X  [J-MOLEX-SMPM-73300-0111X]
CM20.6  J-MOLEX-SMPM-73300-0111X  [J-MOLEX-SMPM-73300-0111X]

### Nets
!SD: CF19.2.39 CF19.2.40 ; also sheet 1,2,3,4,5,6,7,8,12,13,14,15,16,17,18,20
AUX-1: CF19.1.1 CF19.1.2 ; also sheet 2,3,4,5,6,7,8,12,13,14,15,16,17,18
AUX-2: CF19.1.3 CF19.1.4 ; also sheet 2,3,4,5,6,7,8,12,13,14,15,16,17,18
AUX-3: CF19.1.5 CF19.1.6 ; also sheet 2,3,4,5,6,7,8,12,13,14,15,16,17,18
AUX-4: CF19.1.7 CF19.1.8 ; also sheet 2,3,4,5,6,7,8,12,13,14,15,16,17,18
AUX-5: CF19.1.9 CF19.1.10 ; also sheet 2,3,4,5,6,7,8,12,13,14,15,16,17,18
AUX-6: CF19.1.11 CF19.1.12 ; also sheet 2,3,4,5,6,7,8,12,13,14,15,16,17,18
AUX-7: CF19.1.13 CF19.1.14 ; also sheet 2,3,4,5,6,7,8,12,13,14,15,16,17,18
AUX-8: CF19.1.15 CF19.1.16 ; also sheet 2,3,4,5,6,7,8,12,13,14,15,16,17,18
AUX-9: CF19.1.17 CF19.1.18 ; also sheet 2,3,4,5,6,7,8,12,13,14,15,16,17,18
AUX-10: CF19.1.19 CF19.1.20 ; also sheet 2,3,4,5,6,7,8,12,13,14,15,16,17,18
CAN1_H: CF19.2.33 CF19.2.34 ; also sheet 1,2,3,4,5,6,7,8,12,13,14,15,16,17,18,20
CAN1_L: CF19.2.35 CF19.2.36 ; also sheet 1,2,3,4,5,6,7,8,12,13,14,15,16,17,18,20
CAN2_H: CF19.2.17 CF19.2.18 ; also sheet 1,2,3,4,5,6,7,8,12,13,14,15,16,17,18,20
CAN2_L: CF19.2.19 CF19.2.20 ; also sheet 1,2,3,4,5,6,7,8,12,13,14,15,16,17,18,20
GND: CF19.1.LC1 CF19.1.LC2 CF19.2.27 CF19.2.28 CF19.2.29 CF19.2.30 CF19.2.31 CF19.2.32 CF19.2.37 CF19.2.38 CF19.2.LC1 CF19.2.LC2 CM20.4.P$1(SHIELD1) CM20.4.P$2(SHIELD1) CM20.4.P$3(SHIELD1) CM20.4.P$4(SHIELD1) CM20.5.P$1(SHIELD1) CM20.5.P$2(SHIELD1) CM20.5.P$3(SHIELD1) CM20.5.P$4(SHIELD1) CM20.6.P$1(SHIELD1) CM20.6.P$2(SHIELD1) CM20.6.P$3(SHIELD1) CM20.6.P$4(SHIELD1) ; also sheet 1,2,3,4,5,6,7,8,12,13,14,15,16,17,18,20
L-GPS [RF]: CM20.4.RF-DOWN(RF) ; also sheet 18
L-TURNSTILE [RF]: CM20.5.RF-DOWN(RF) ; also sheet 20
OPD_PWR: CF19.2.15 CF19.2.16 ; also sheet 1,2,3,4,5,6,7,8,12,13,14,15,16,17,18,20
OPD_SCL: CF19.2.13 CF19.2.14 ; also sheet 1,2,3,4,5,6,7,8,12,13,14,15,16,17,18,20
OPD_SDA: CF19.2.11 CF19.2.12 ; also sheet 1,2,3,4,5,6,7,8,12,13,14,15,16,17,18,20
SPARE1: CF19.2.9 CF19.2.10 ; also sheet 1,2,3,4,5,6,7,8,12,13,14,15,16,17,18,20
SPARE2: CF19.2.7 CF19.2.8 ; also sheet 1,2,3,4,5,6,7,8,12,13,14,15,16,17,18,20
SPARE3: CF19.2.5 CF19.2.6 ; also sheet 1,2,3,4,5,6,7,8,12,13,14,15,16,17,18,20
SPARE4: CF19.2.3 CF19.2.4 ; also sheet 1,2,3,4,5,6,7,8,12,13,14,15,16,17,18,20
SPARE5: CF19.2.1 CF19.2.2 ; also sheet 1,2,3,4,5,6,7,8,12,13,14,15,16,17,18,20
VBUS: CF19.2.21 CF19.2.22 CF19.2.23 CF19.2.24 CF19.2.25 CF19.2.26 ; also sheet 1,2,3,4,5,6,7,8,12,13,14,15,16,17,18,20
VHF-TURNSTILE [RF]: CM20.6.RF-DOWN(RF) ; also sheet 20

## Sheet 20 of 20: Slot 20
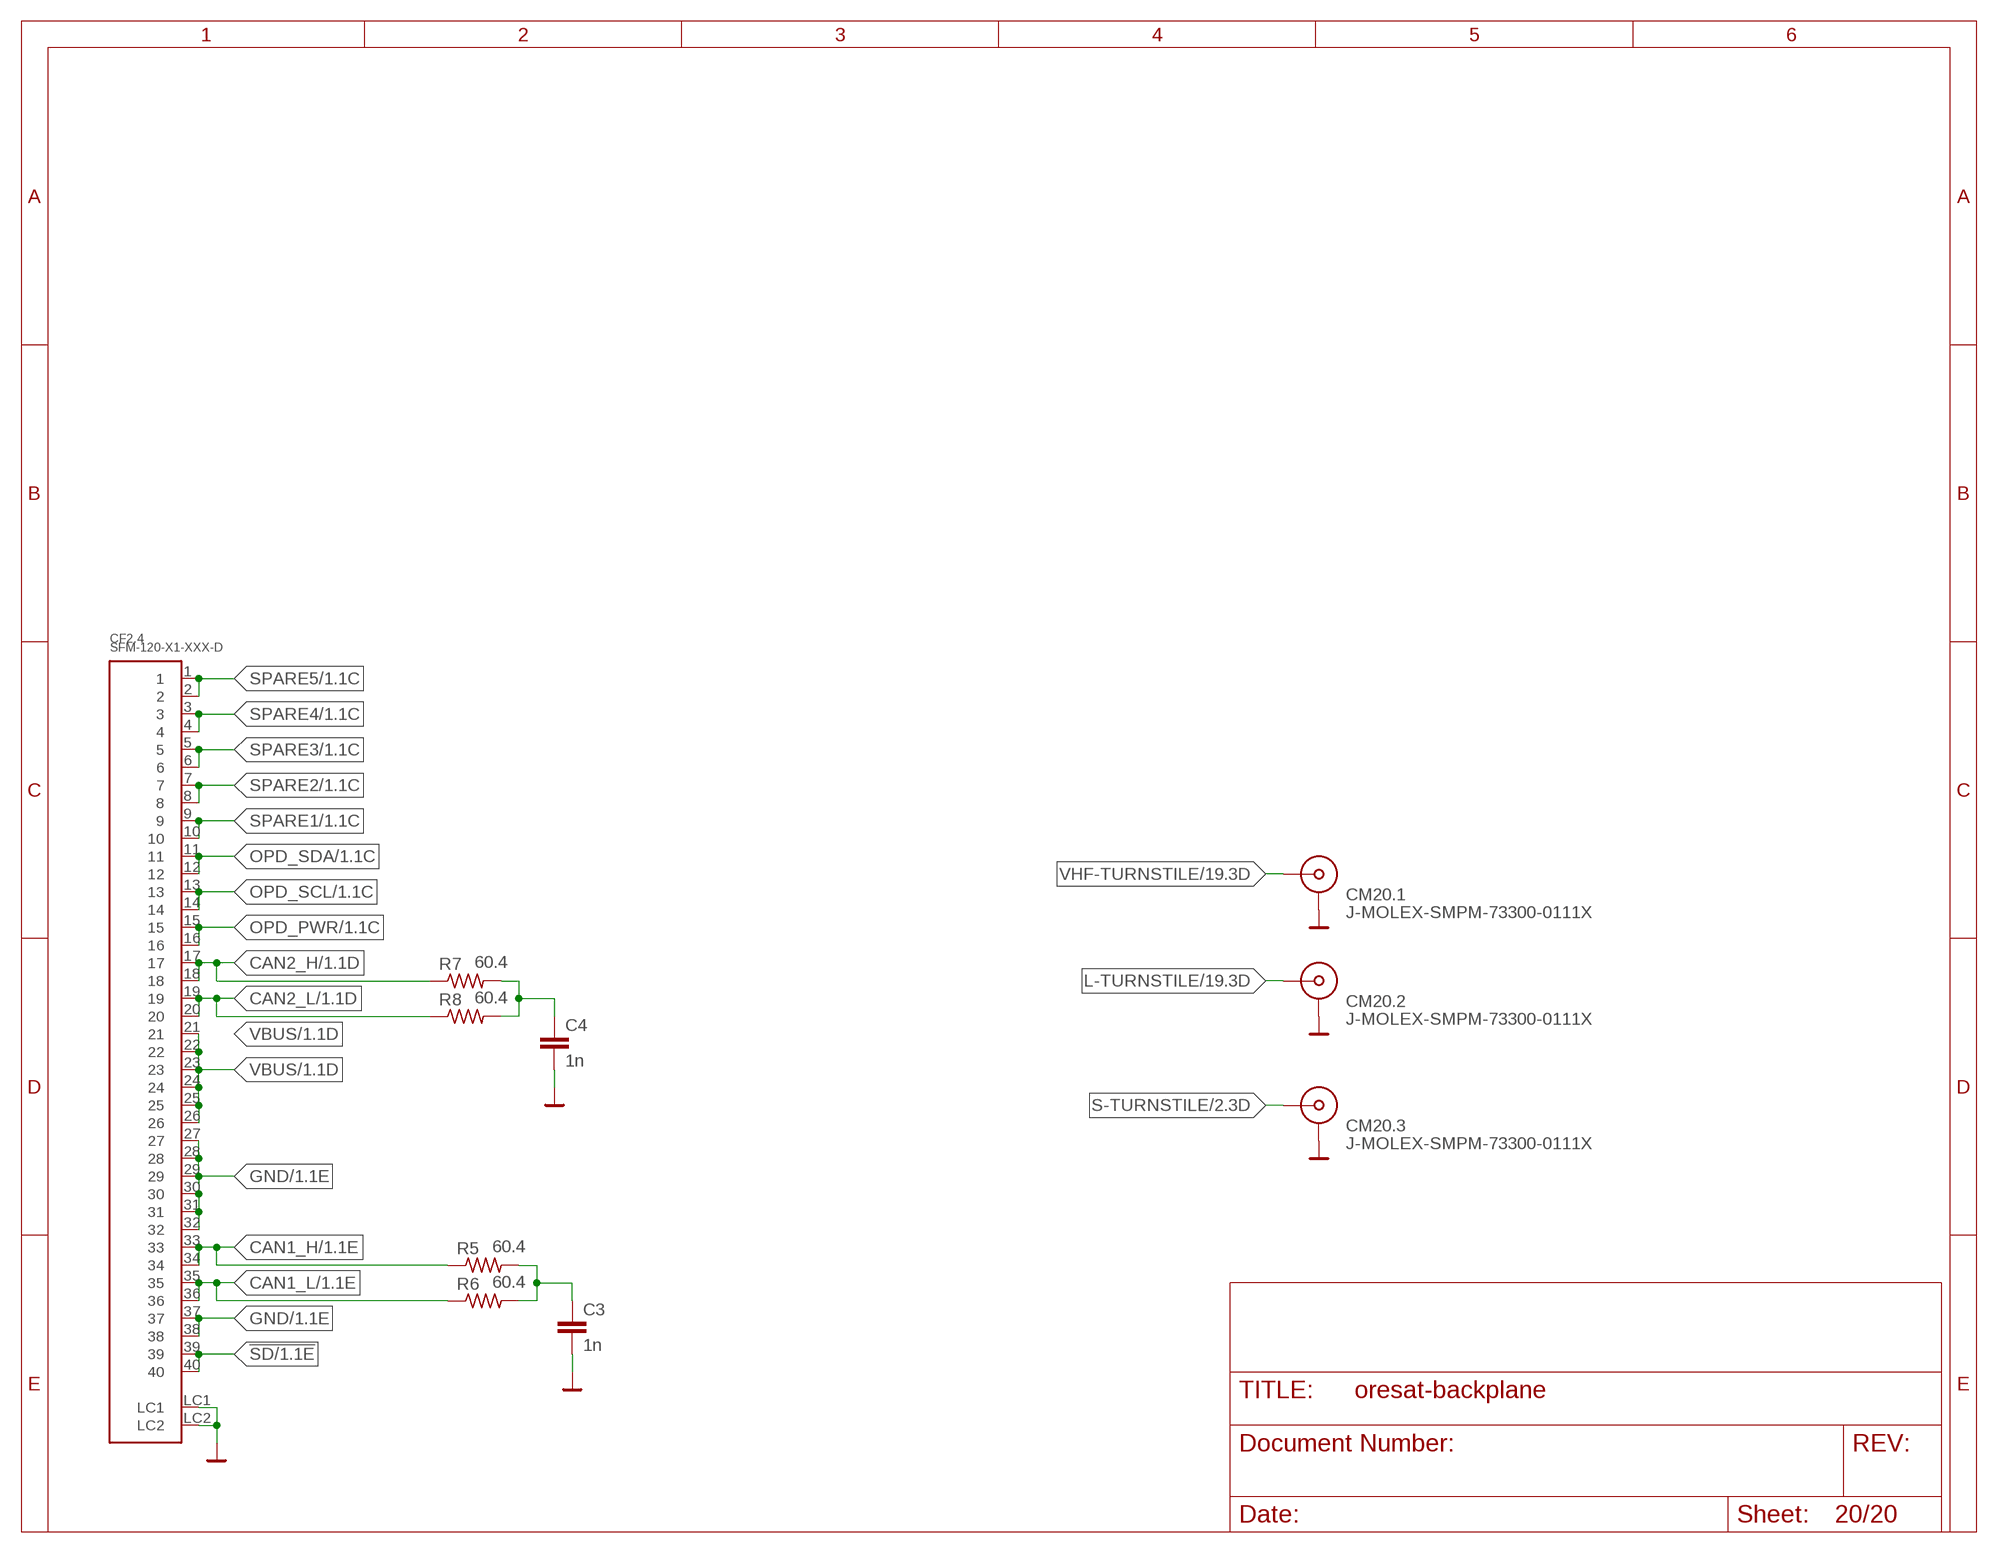
[diagram p19: schematic, sheet 20]

### Parts
C3  1n  C-EU0603-C-NOSILK  [.0603-C-NOSILK]
C4  1n  C-EU0603-C-NOSILK  [.0603-C-NOSILK]
CF2.4  SFM-120-X1-XXX-D  [SFM-120-X1-XXX-D]
CM20.1  J-MOLEX-SMPM-73300-0111X  [J-MOLEX-SMPM-73300-0111X]
CM20.2  J-MOLEX-SMPM-73300-0111X  [J-MOLEX-SMPM-73300-0111X]
CM20.3  J-MOLEX-SMPM-73300-0111X  [J-MOLEX-SMPM-73300-0111X]
R5  60.4  R-US_1206-C  [1206-C]
R6  60.4  R-US_1206-C  [1206-C]
R7  60.4  R-US_1206-C  [1206-C]
R8  60.4  R-US_1206-C  [1206-C]

### Nets
!SD: CF2.4.39 CF2.4.40 ; also sheet 1,2,3,4,5,6,7,8,12,13,14,15,16,17,18,19
CAN1_H: CF2.4.33 CF2.4.34 R5.1 ; also sheet 1,2,3,4,5,6,7,8,12,13,14,15,16,17,18,19
CAN1_L: CF2.4.35 CF2.4.36 R6.1 ; also sheet 1,2,3,4,5,6,7,8,12,13,14,15,16,17,18,19
CAN2_H: CF2.4.17 CF2.4.18 R7.1 ; also sheet 1,2,3,4,5,6,7,8,12,13,14,15,16,17,18,19
CAN2_L: CF2.4.19 CF2.4.20 R8.1 ; also sheet 1,2,3,4,5,6,7,8,12,13,14,15,16,17,18,19
GND: C3.2 C4.2 CF2.4.27 CF2.4.28 CF2.4.29 CF2.4.30 CF2.4.31 CF2.4.32 CF2.4.37 CF2.4.38 CF2.4.LC1 CF2.4.LC2 CM20.1.P$1(SHIELD1) CM20.1.P$2(SHIELD1) CM20.1.P$3(SHIELD1) CM20.1.P$4(SHIELD1) CM20.2.P$1(SHIELD1) CM20.2.P$2(SHIELD1) CM20.2.P$3(SHIELD1) CM20.2.P$4(SHIELD1) CM20.3.P$1(SHIELD1) CM20.3.P$2(SHIELD1) CM20.3.P$3(SHIELD1) CM20.3.P$4(SHIELD1) ; also sheet 1,2,3,4,5,6,7,8,12,13,14,15,16,17,18,19
L-TURNSTILE [RF]: CM20.2.RF-DOWN(RF) ; also sheet 19
N$3: C4.1 R7.2 R8.2
N$4: C3.1 R5.2 R6.2
OPD_PWR: CF2.4.15 CF2.4.16 ; also sheet 1,2,3,4,5,6,7,8,12,13,14,15,16,17,18,19
OPD_SCL: CF2.4.13 CF2.4.14 ; also sheet 1,2,3,4,5,6,7,8,12,13,14,15,16,17,18,19
OPD_SDA: CF2.4.11 CF2.4.12 ; also sheet 1,2,3,4,5,6,7,8,12,13,14,15,16,17,18,19
S-TURNSTILE [RF]: CM20.3.RF-DOWN(RF) ; also sheet 2
SPARE1: CF2.4.9 CF2.4.10 ; also sheet 1,2,3,4,5,6,7,8,12,13,14,15,16,17,18,19
SPARE2: CF2.4.7 CF2.4.8 ; also sheet 1,2,3,4,5,6,7,8,12,13,14,15,16,17,18,19
SPARE3: CF2.4.5 CF2.4.6 ; also sheet 1,2,3,4,5,6,7,8,12,13,14,15,16,17,18,19
SPARE4: CF2.4.3 CF2.4.4 ; also sheet 1,2,3,4,5,6,7,8,12,13,14,15,16,17,18,19
SPARE5: CF2.4.1 CF2.4.2 ; also sheet 1,2,3,4,5,6,7,8,12,13,14,15,16,17,18,19
VBUS: CF2.4.21 CF2.4.22 CF2.4.23 CF2.4.24 CF2.4.25 CF2.4.26 ; also sheet 1,2,3,4,5,6,7,8,12,13,14,15,16,17,18,19
VHF-TURNSTILE [RF]: CM20.1.RF-DOWN(RF) ; also sheet 19

## Library data of the parts
C1-C4 = oresat-rcl:C-EU: CAPACITOR, European symbol
CF2.1 CF3.1 CF4.1 CF5.1 CF6.1 CF7.1 CF8.1 CF12.1 CF13.1 CF14.1 CF15.1 CF16.1 CF17.1 CF18.1 CF19.1 = J-Samtec-SFM-110-X1-XXX-D-LC:SFM-110-X1-XXX-D-LC: 0.05"X0.05" SOCKET STRIP DOUBLE ROW ASSEMBLY. MANUFACTURER: SAMTEC.
CF2.2-CF2.4 CF3.2 CF4.2 CF5.2 CF6.2 CF7.2 CF8.2 CF12.2 CF13.2 CF14.2 CF15.2 CF16.2 CF17.2 CF18.2 CF19.2 = J-Samtec-SFM-120-X1-XXX-D:SFM-120-X1-XXX-D: 0.05"X0.05" SOCKET STRIP DOUBLE ROW ASSEMBLY. MANUFACTURER: SAMTEC.
CM1.1 CM2.1 CM2.2 CM20.1-CM20.7 = J-Molex-73300-011x-SMPM-M-vertical:J-MOLEX-SMPM-73300-0111X
R1-R8 = oresat-rcl:R-US_: RESISTOR, American symbol

## Net classes
1 RF: width 0.38 mm, clearance 1 mm